# EAGLE schematic DATALOGGER_ADS_V1 (EAGLE 9.6.2)

## Sheet 1 of 21
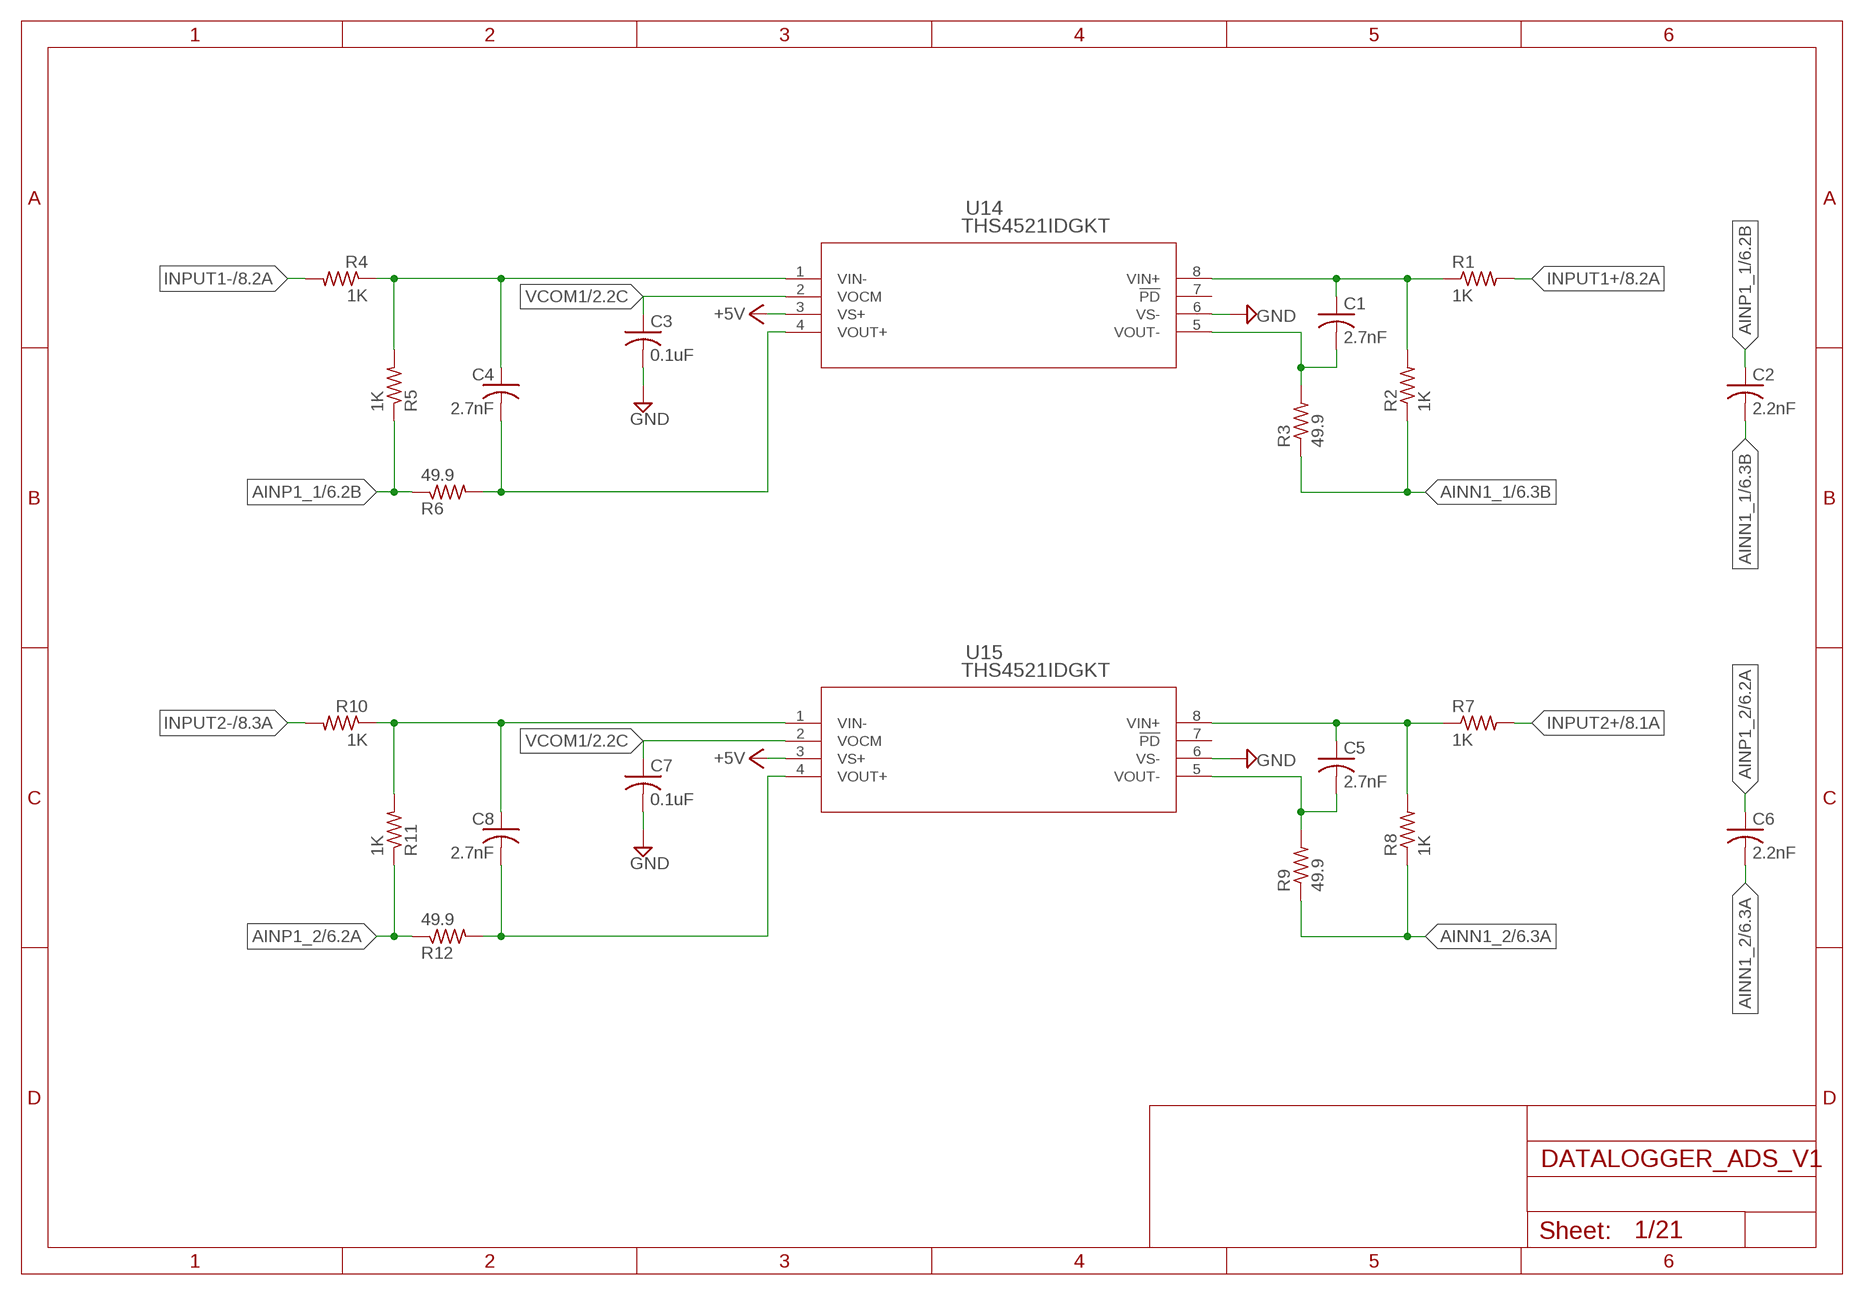
[diagram p0: schematic, sheet 1]

### Parts
C1  2.7nF  C-USC0603  [C0603]
C2  2.2nF  C-USC0603  [C0603]
C3  0.1uF  C-USC0603  [C0603]
C4  2.7nF  C-USC0603  [C0603]
C5  2.7nF  C-USC0603  [C0603]
C6  2.2nF  C-USC0603  [C0603]
C7  0.1uF  C-USC0603  [C0603]
C8  2.7nF  C-USC0603  [C0603]
R1  1K  R-US_R0603  [R0603]
R2  1K  R-US_R0603  [R0603]
R3  49.9  R-US_R0603  [R0603]
R4  1K  R-US_R0603  [R0603]
R5  1K  R-US_R0603  [R0603]
R6  49.9  R-US_R0603  [R0603]
R7  1K  R-US_R0603  [R0603]
R8  1K  R-US_R0603  [R0603]
R9  49.9  R-US_R0603  [R0603]
R10  1K  R-US_R0603  [R0603]
R11  1K  R-US_R0603  [R0603]
R12  49.9  R-US_R0603  [R0603]
U14  THS4521IDGKT  [DGK8]
U15  THS4521IDGKT  [DGK8]

### Nets
+5V: U14.3(VS+) U15.3(VS+) ; also sheet 2,3,4,5,6,8,9,10,11,12,13,14,15,16,17,18,19,21
AINN1_1: C2.2 R2.1 R3.1 ; also sheet 6
AINN1_2: C6.2 R8.1 R9.1 ; also sheet 6
AINP1_1: C2.1 R5.1 R6.1 ; also sheet 6
AINP1_2: C6.1 R11.1 R12.1 ; also sheet 6
GND: C3.2 C7.2 U14.6(VS-) U15.6(VS-) ; also sheet 2,3,4,5,6,7,8,9,10,11,12,13,14,15,16,17,18,19,20,21
INPUT1+: R1.2 ; also sheet 8
INPUT1-: R4.2 ; also sheet 8
INPUT2+: R7.2 ; also sheet 8
INPUT2-: R10.2 ; also sheet 8
N$1: C4.1 R4.1 R5.2 U14.1(VIN-)
N$2: C1.1 R1.1 R2.2 U14.8(VIN+)
N$3: C1.2 R3.2 U14.5(VOUT-)
N$4: C4.2 R6.2 U14.4(VOUT+)
N$5: C5.1 R7.1 R8.2 U15.8(VIN+)
N$6: C5.2 R9.2 U15.5(VOUT-)
N$7: C8.1 R10.1 R11.2 U15.1(VIN-)
N$8: C8.2 R12.2 U15.4(VOUT+)
VCOM1: C3.1 C7.1 U14.2(VOCM) U15.2(VOCM) ; also sheet 2,3,4,5
Unconnected: U14.7(!PD) U15.7(!PD)

## Sheet 2 of 21
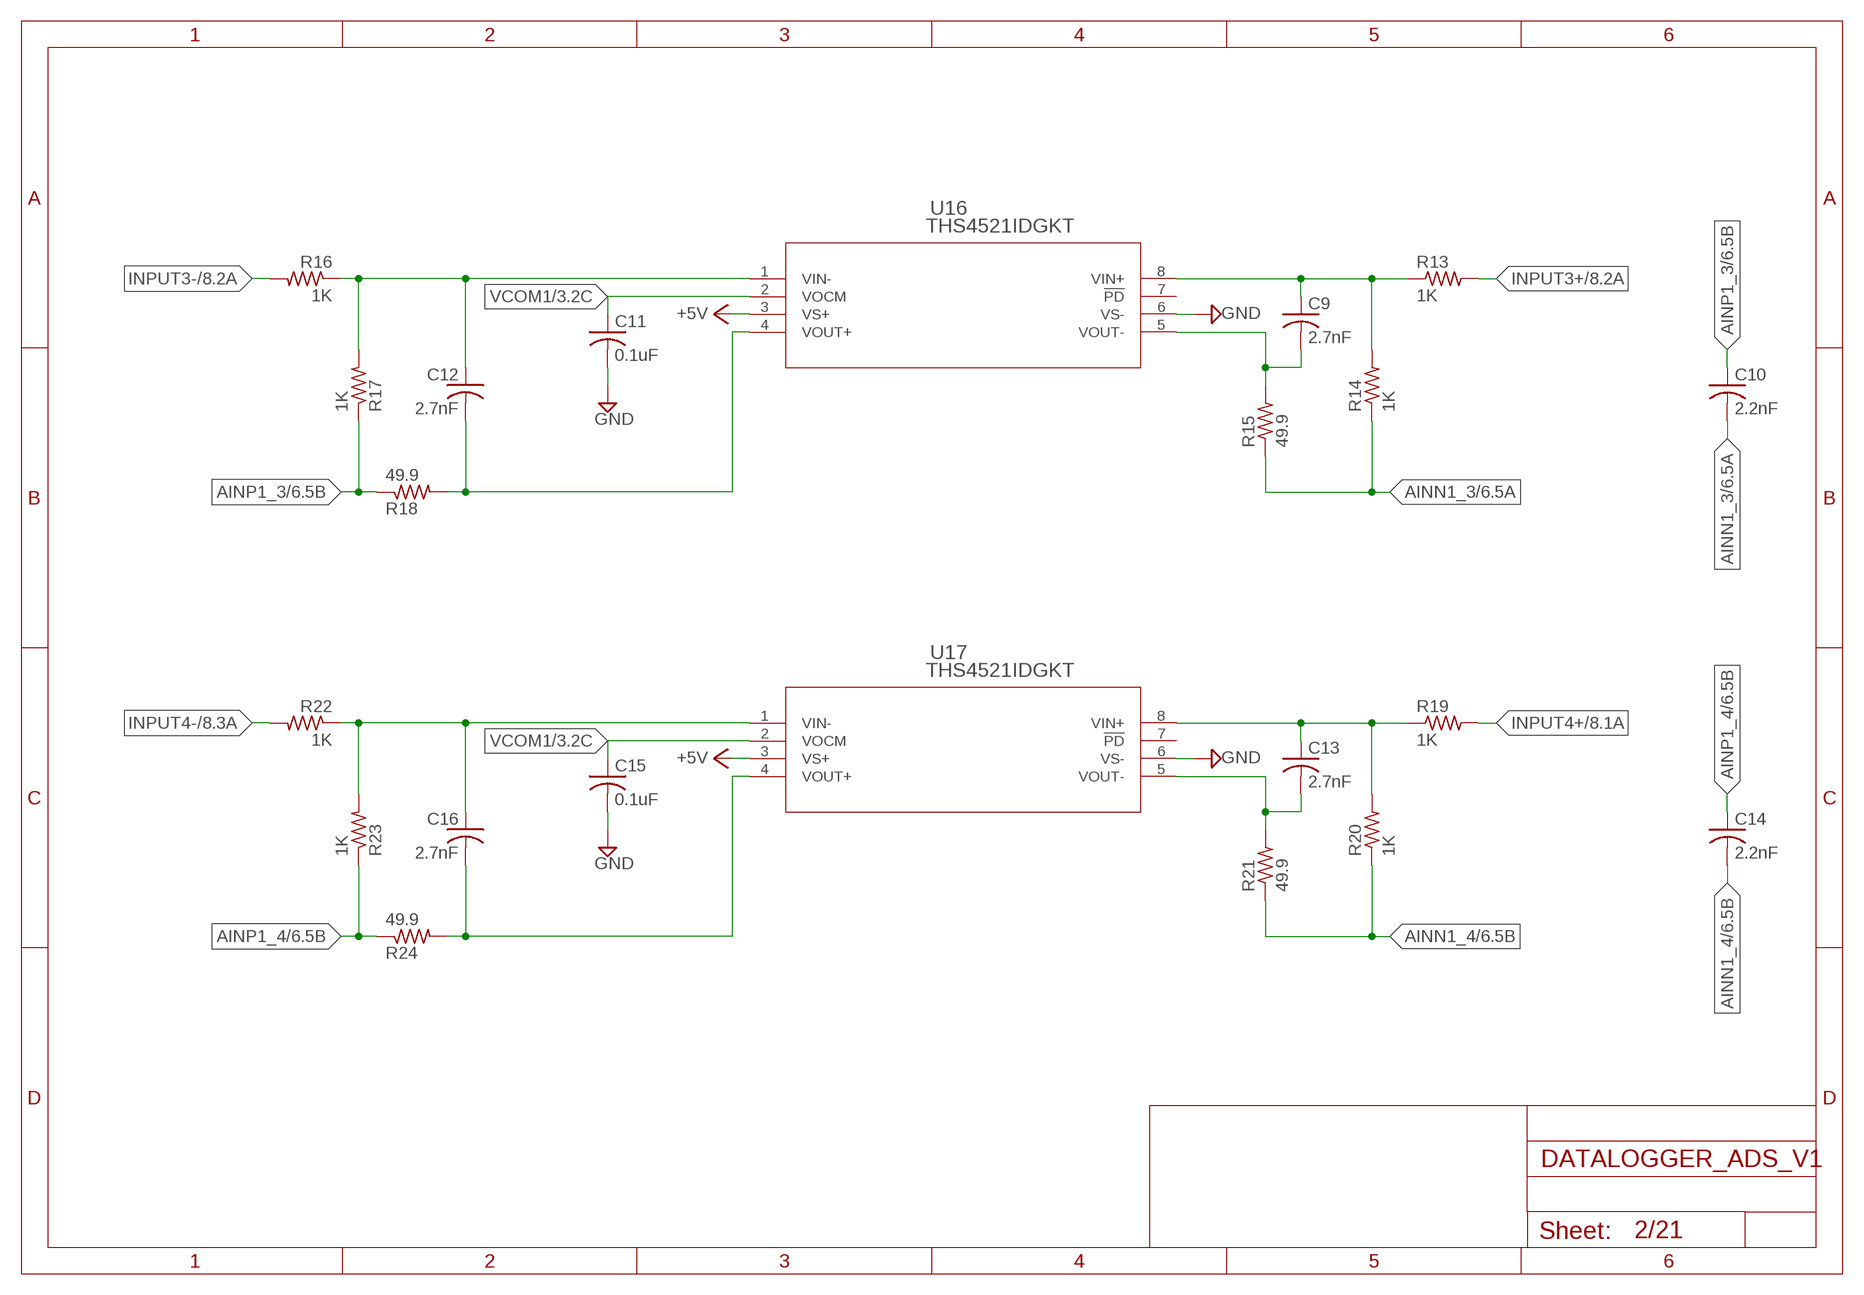
[diagram p1: schematic, sheet 2]

### Parts
C9  2.7nF  C-USC0603  [C0603]
C10  2.2nF  C-USC0603  [C0603]
C11  0.1uF  C-USC0603  [C0603]
C12  2.7nF  C-USC0603  [C0603]
C13  2.7nF  C-USC0603  [C0603]
C14  2.2nF  C-USC0603  [C0603]
C15  0.1uF  C-USC0603  [C0603]
C16  2.7nF  C-USC0603  [C0603]
R13  1K  R-US_R0603  [R0603]
R14  1K  R-US_R0603  [R0603]
R15  49.9  R-US_R0603  [R0603]
R16  1K  R-US_R0603  [R0603]
R17  1K  R-US_R0603  [R0603]
R18  49.9  R-US_R0603  [R0603]
R19  1K  R-US_R0603  [R0603]
R20  1K  R-US_R0603  [R0603]
R21  49.9  R-US_R0603  [R0603]
R22  1K  R-US_R0603  [R0603]
R23  1K  R-US_R0603  [R0603]
R24  49.9  R-US_R0603  [R0603]
U16  THS4521IDGKT  [DGK8]
U17  THS4521IDGKT  [DGK8]

### Nets
+5V: U16.3(VS+) U17.3(VS+) ; also sheet 1,3,4,5,6,8,9,10,11,12,13,14,15,16,17,18,19,21
AINN1_3: C10.2 R14.1 R15.1 ; also sheet 6
AINN1_4: C14.2 R20.1 R21.1 ; also sheet 6
AINP1_3: C10.1 R17.1 R18.1 ; also sheet 6
AINP1_4: C14.1 R23.1 R24.1 ; also sheet 6
GND: C11.2 C15.2 U16.6(VS-) U17.6(VS-) ; also sheet 1,3,4,5,6,7,8,9,10,11,12,13,14,15,16,17,18,19,20,21
INPUT3+: R13.2 ; also sheet 8
INPUT3-: R16.2 ; also sheet 8
INPUT4+: R19.2 ; also sheet 8
INPUT4-: R22.2 ; also sheet 8
N$9: C9.1 R13.1 R14.2 U16.8(VIN+)
N$10: C9.2 R15.2 U16.5(VOUT-)
N$11: C12.1 R16.1 R17.2 U16.1(VIN-)
N$12: C12.2 R18.2 U16.4(VOUT+)
N$13: C13.1 R19.1 R20.2 U17.8(VIN+)
N$14: C13.2 R21.2 U17.5(VOUT-)
N$15: C16.1 R22.1 R23.2 U17.1(VIN-)
N$16: C16.2 R24.2 U17.4(VOUT+)
VCOM1: C11.1 C15.1 U16.2(VOCM) U17.2(VOCM) ; also sheet 1,3,4,5
Unconnected: U16.7(!PD) U17.7(!PD)

## Sheet 3 of 21
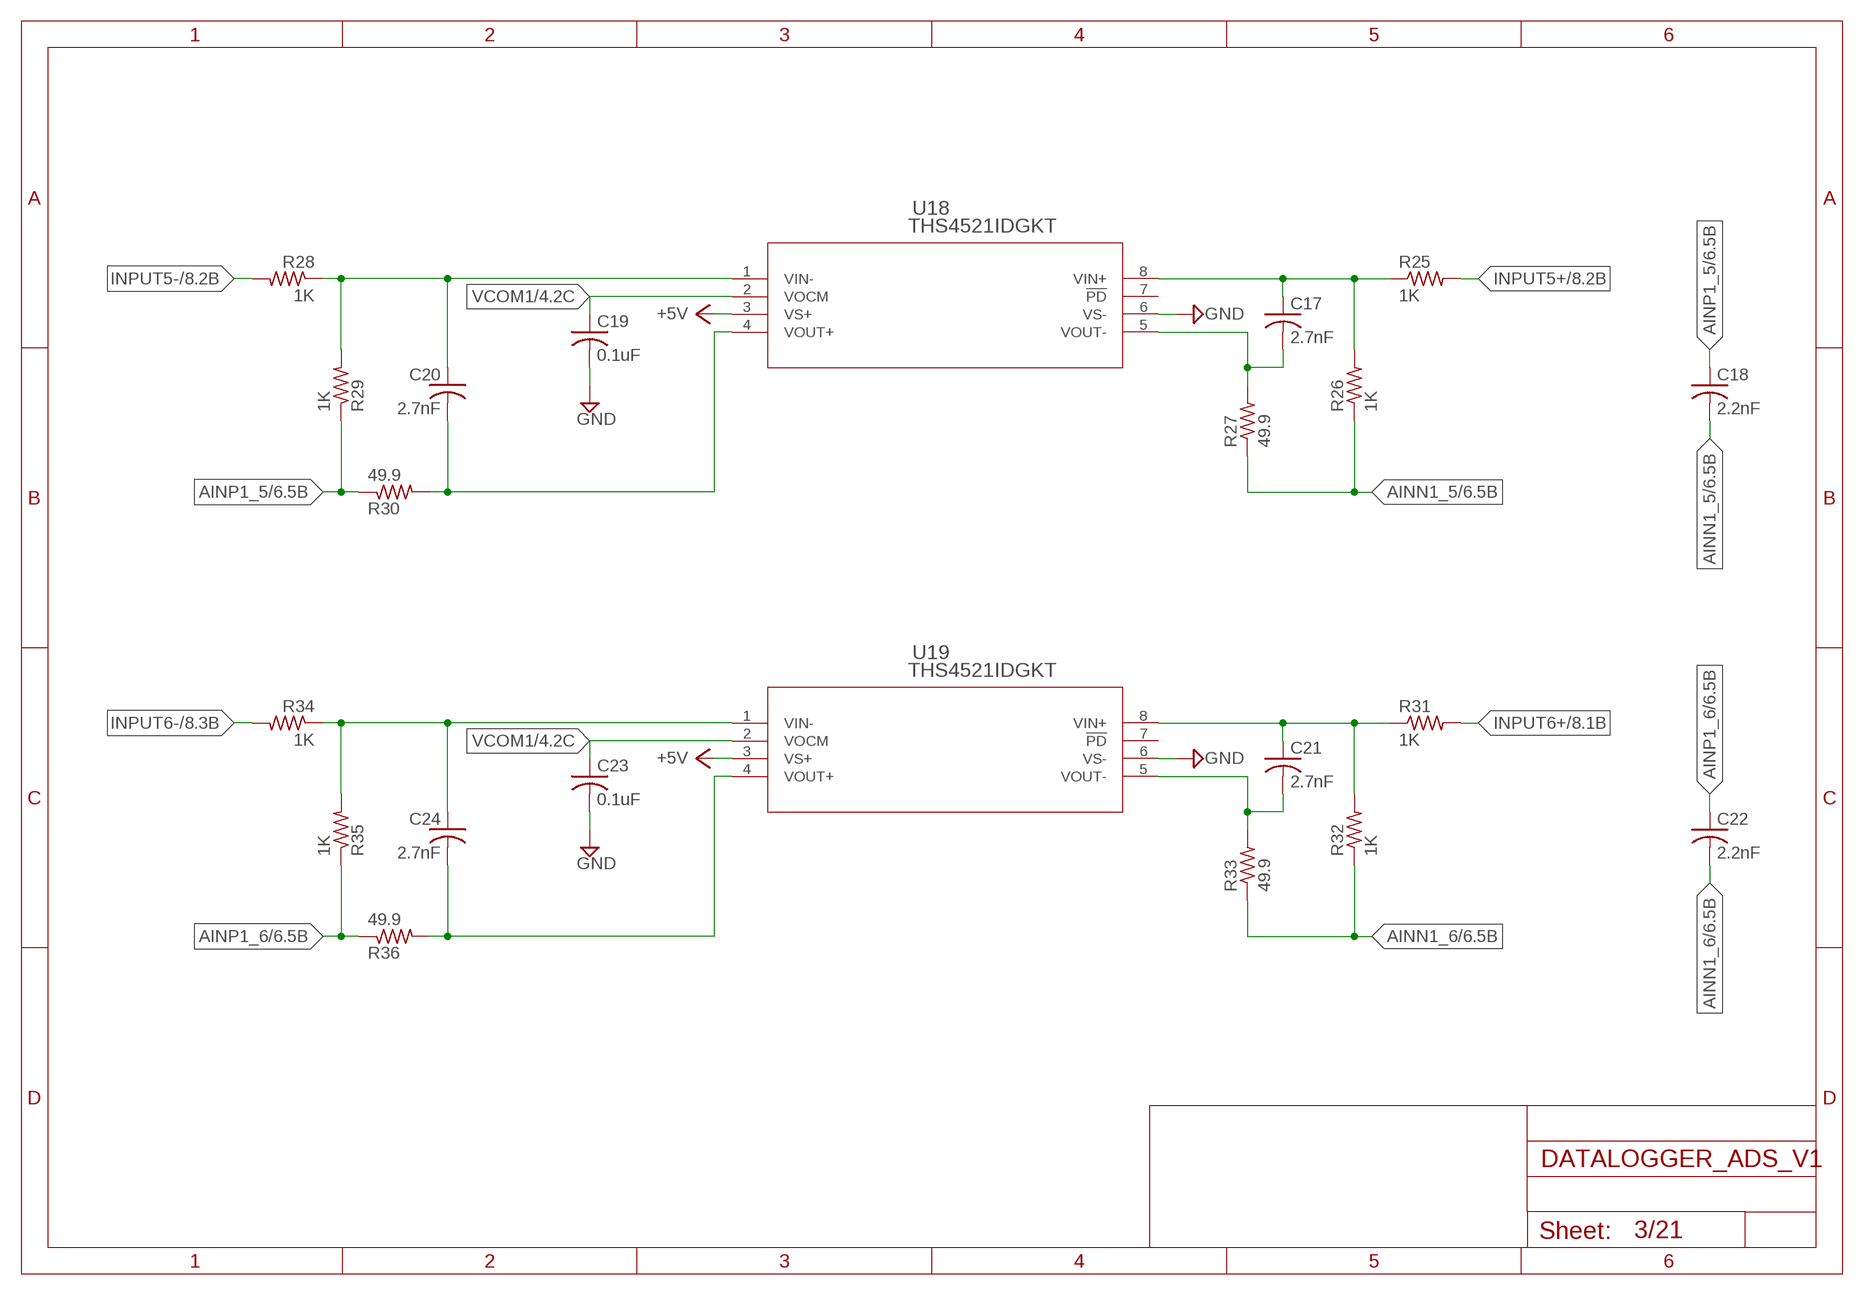
[diagram p2: schematic, sheet 3]

### Parts
C17  2.7nF  C-USC0603  [C0603]
C18  2.2nF  C-USC0603  [C0603]
C19  0.1uF  C-USC0603  [C0603]
C20  2.7nF  C-USC0603  [C0603]
C21  2.7nF  C-USC0603  [C0603]
C22  2.2nF  C-USC0603  [C0603]
C23  0.1uF  C-USC0603  [C0603]
C24  2.7nF  C-USC0603  [C0603]
R25  1K  R-US_R0603  [R0603]
R26  1K  R-US_R0603  [R0603]
R27  49.9  R-US_R0603  [R0603]
R28  1K  R-US_R0603  [R0603]
R29  1K  R-US_R0603  [R0603]
R30  49.9  R-US_R0603  [R0603]
R31  1K  R-US_R0603  [R0603]
R32  1K  R-US_R0603  [R0603]
R33  49.9  R-US_R0603  [R0603]
R34  1K  R-US_R0603  [R0603]
R35  1K  R-US_R0603  [R0603]
R36  49.9  R-US_R0603  [R0603]
U18  THS4521IDGKT  [DGK8]
U19  THS4521IDGKT  [DGK8]

### Nets
+5V: U18.3(VS+) U19.3(VS+) ; also sheet 1,2,4,5,6,8,9,10,11,12,13,14,15,16,17,18,19,21
AINN1_5: C18.2 R26.1 R27.1 ; also sheet 6
AINN1_6: C22.2 R32.1 R33.1 ; also sheet 6
AINP1_5: C18.1 R29.1 R30.1 ; also sheet 6
AINP1_6: C22.1 R35.1 R36.1 ; also sheet 6
GND: C19.2 C23.2 U18.6(VS-) U19.6(VS-) ; also sheet 1,2,4,5,6,7,8,9,10,11,12,13,14,15,16,17,18,19,20,21
INPUT5+: R25.2 ; also sheet 8
INPUT5-: R28.2 ; also sheet 8
INPUT6+: R31.2 ; also sheet 8
INPUT6-: R34.2 ; also sheet 8
N$17: C17.1 R25.1 R26.2 U18.8(VIN+)
N$18: C17.2 R27.2 U18.5(VOUT-)
N$19: C20.1 R28.1 R29.2 U18.1(VIN-)
N$20: C20.2 R30.2 U18.4(VOUT+)
N$21: C21.1 R31.1 R32.2 U19.8(VIN+)
N$22: C21.2 R33.2 U19.5(VOUT-)
N$23: C24.1 R34.1 R35.2 U19.1(VIN-)
N$24: C24.2 R36.2 U19.4(VOUT+)
VCOM1: C19.1 C23.1 U18.2(VOCM) U19.2(VOCM) ; also sheet 1,2,4,5
Unconnected: U18.7(!PD) U19.7(!PD)

## Sheet 4 of 21
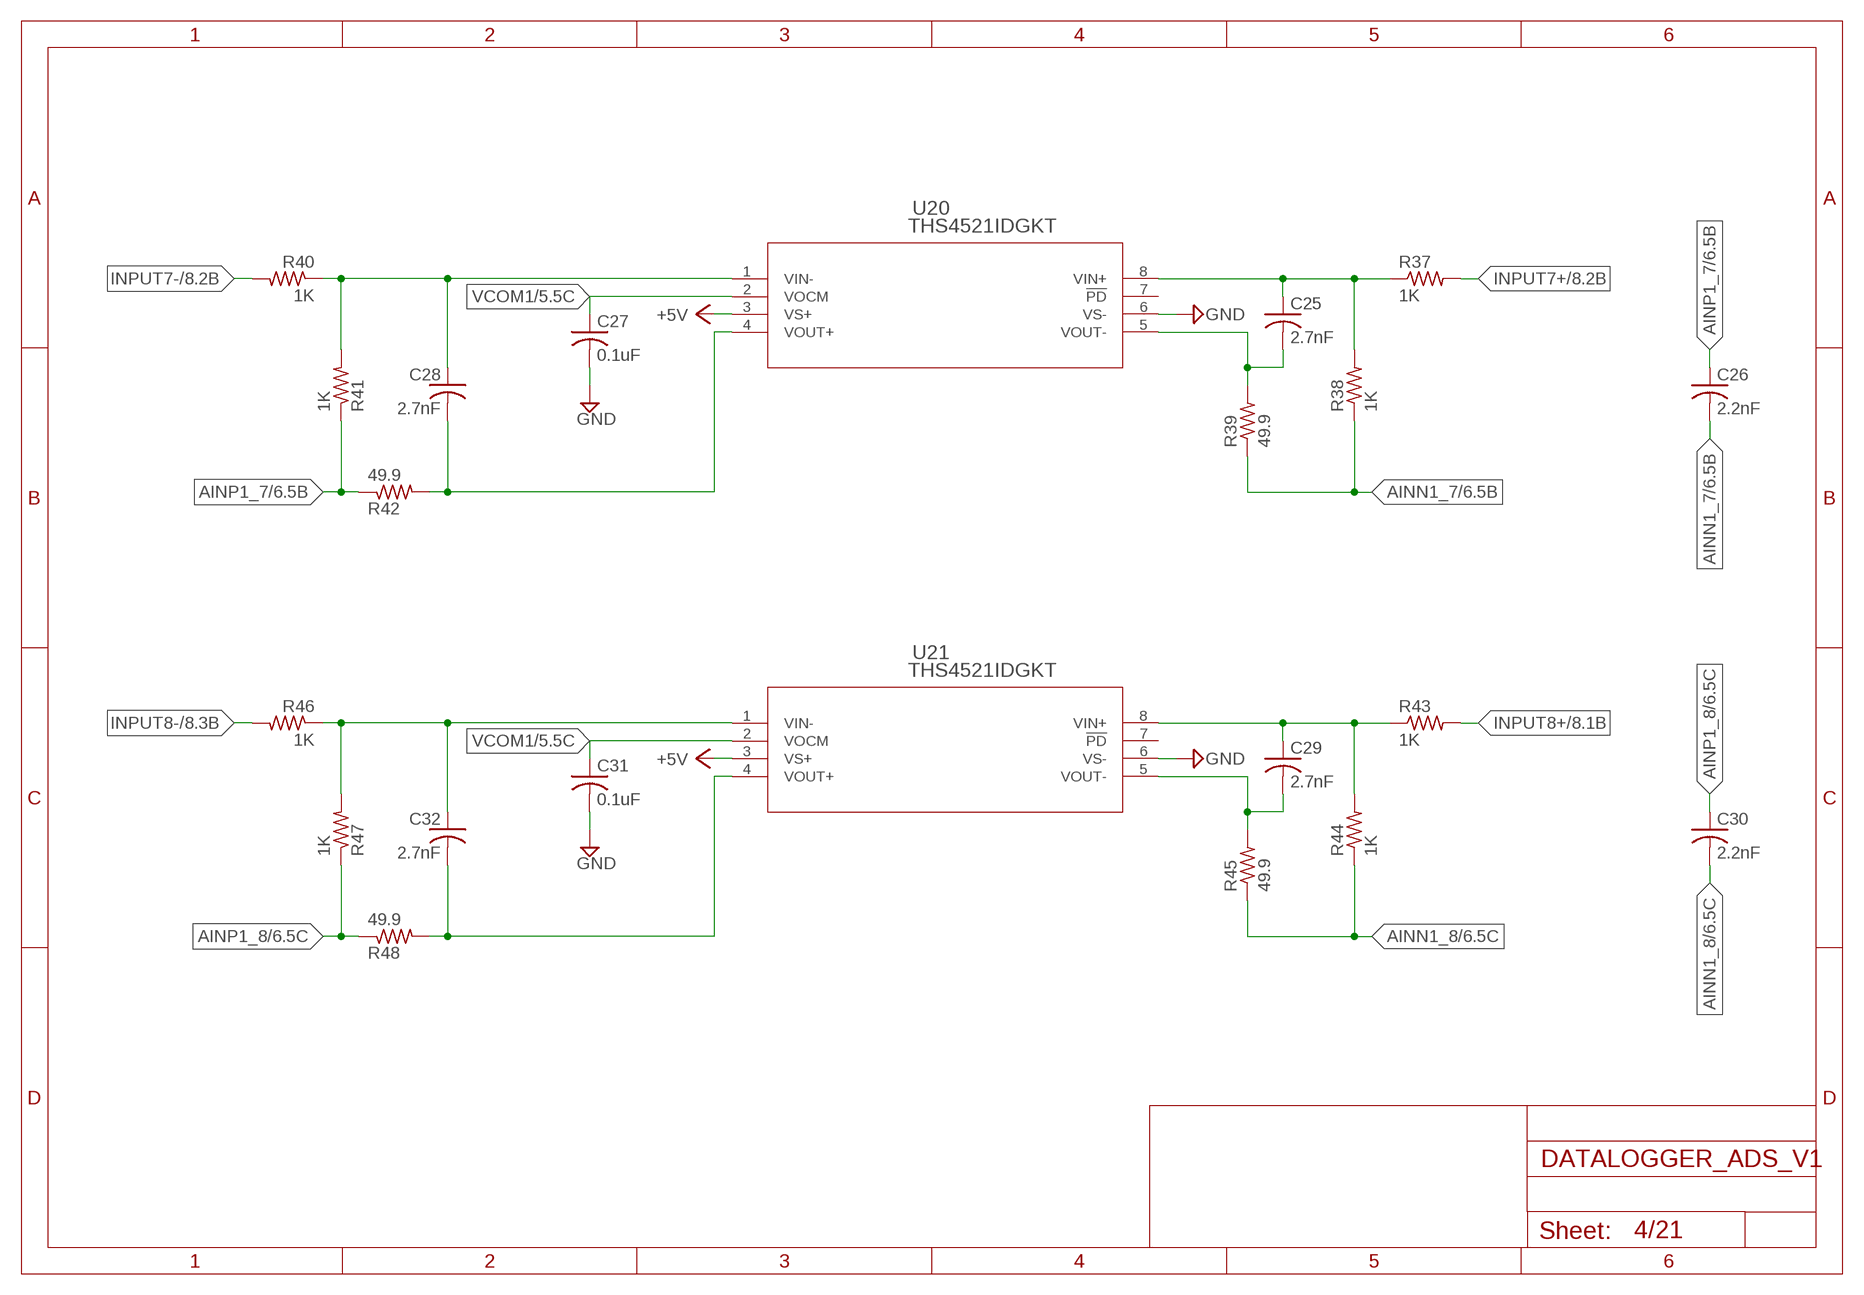
[diagram p3: schematic, sheet 4]

### Parts
C25  2.7nF  C-USC0603  [C0603]
C26  2.2nF  C-USC0603  [C0603]
C27  0.1uF  C-USC0603  [C0603]
C28  2.7nF  C-USC0603  [C0603]
C29  2.7nF  C-USC0603  [C0603]
C30  2.2nF  C-USC0603  [C0603]
C31  0.1uF  C-USC0603  [C0603]
C32  2.7nF  C-USC0603  [C0603]
R37  1K  R-US_R0603  [R0603]
R38  1K  R-US_R0603  [R0603]
R39  49.9  R-US_R0603  [R0603]
R40  1K  R-US_R0603  [R0603]
R41  1K  R-US_R0603  [R0603]
R42  49.9  R-US_R0603  [R0603]
R43  1K  R-US_R0603  [R0603]
R44  1K  R-US_R0603  [R0603]
R45  49.9  R-US_R0603  [R0603]
R46  1K  R-US_R0603  [R0603]
R47  1K  R-US_R0603  [R0603]
R48  49.9  R-US_R0603  [R0603]
U20  THS4521IDGKT  [DGK8]
U21  THS4521IDGKT  [DGK8]

### Nets
+5V: U20.3(VS+) U21.3(VS+) ; also sheet 1,2,3,5,6,8,9,10,11,12,13,14,15,16,17,18,19,21
AINN1_7: C26.2 R38.1 R39.1 ; also sheet 6
AINN1_8: C30.2 R44.1 R45.1 ; also sheet 6
AINP1_7: C26.1 R41.1 R42.1 ; also sheet 6
AINP1_8: C30.1 R47.1 R48.1 ; also sheet 6
GND: C27.2 C31.2 U20.6(VS-) U21.6(VS-) ; also sheet 1,2,3,5,6,7,8,9,10,11,12,13,14,15,16,17,18,19,20,21
INPUT7+: R37.2 ; also sheet 8
INPUT7-: R40.2 ; also sheet 8
INPUT8+: R43.2 ; also sheet 8
INPUT8-: R46.2 ; also sheet 8
N$25: C25.1 R37.1 R38.2 U20.8(VIN+)
N$26: C25.2 R39.2 U20.5(VOUT-)
N$27: C28.1 R40.1 R41.2 U20.1(VIN-)
N$28: C28.2 R42.2 U20.4(VOUT+)
N$29: C29.1 R43.1 R44.2 U21.8(VIN+)
N$30: C29.2 R45.2 U21.5(VOUT-)
N$31: C32.1 R46.1 R47.2 U21.1(VIN-)
N$32: C32.2 R48.2 U21.4(VOUT+)
VCOM1: C27.1 C31.1 U20.2(VOCM) U21.2(VOCM) ; also sheet 1,2,3,5
Unconnected: U20.7(!PD) U21.7(!PD)

## Sheet 5 of 21
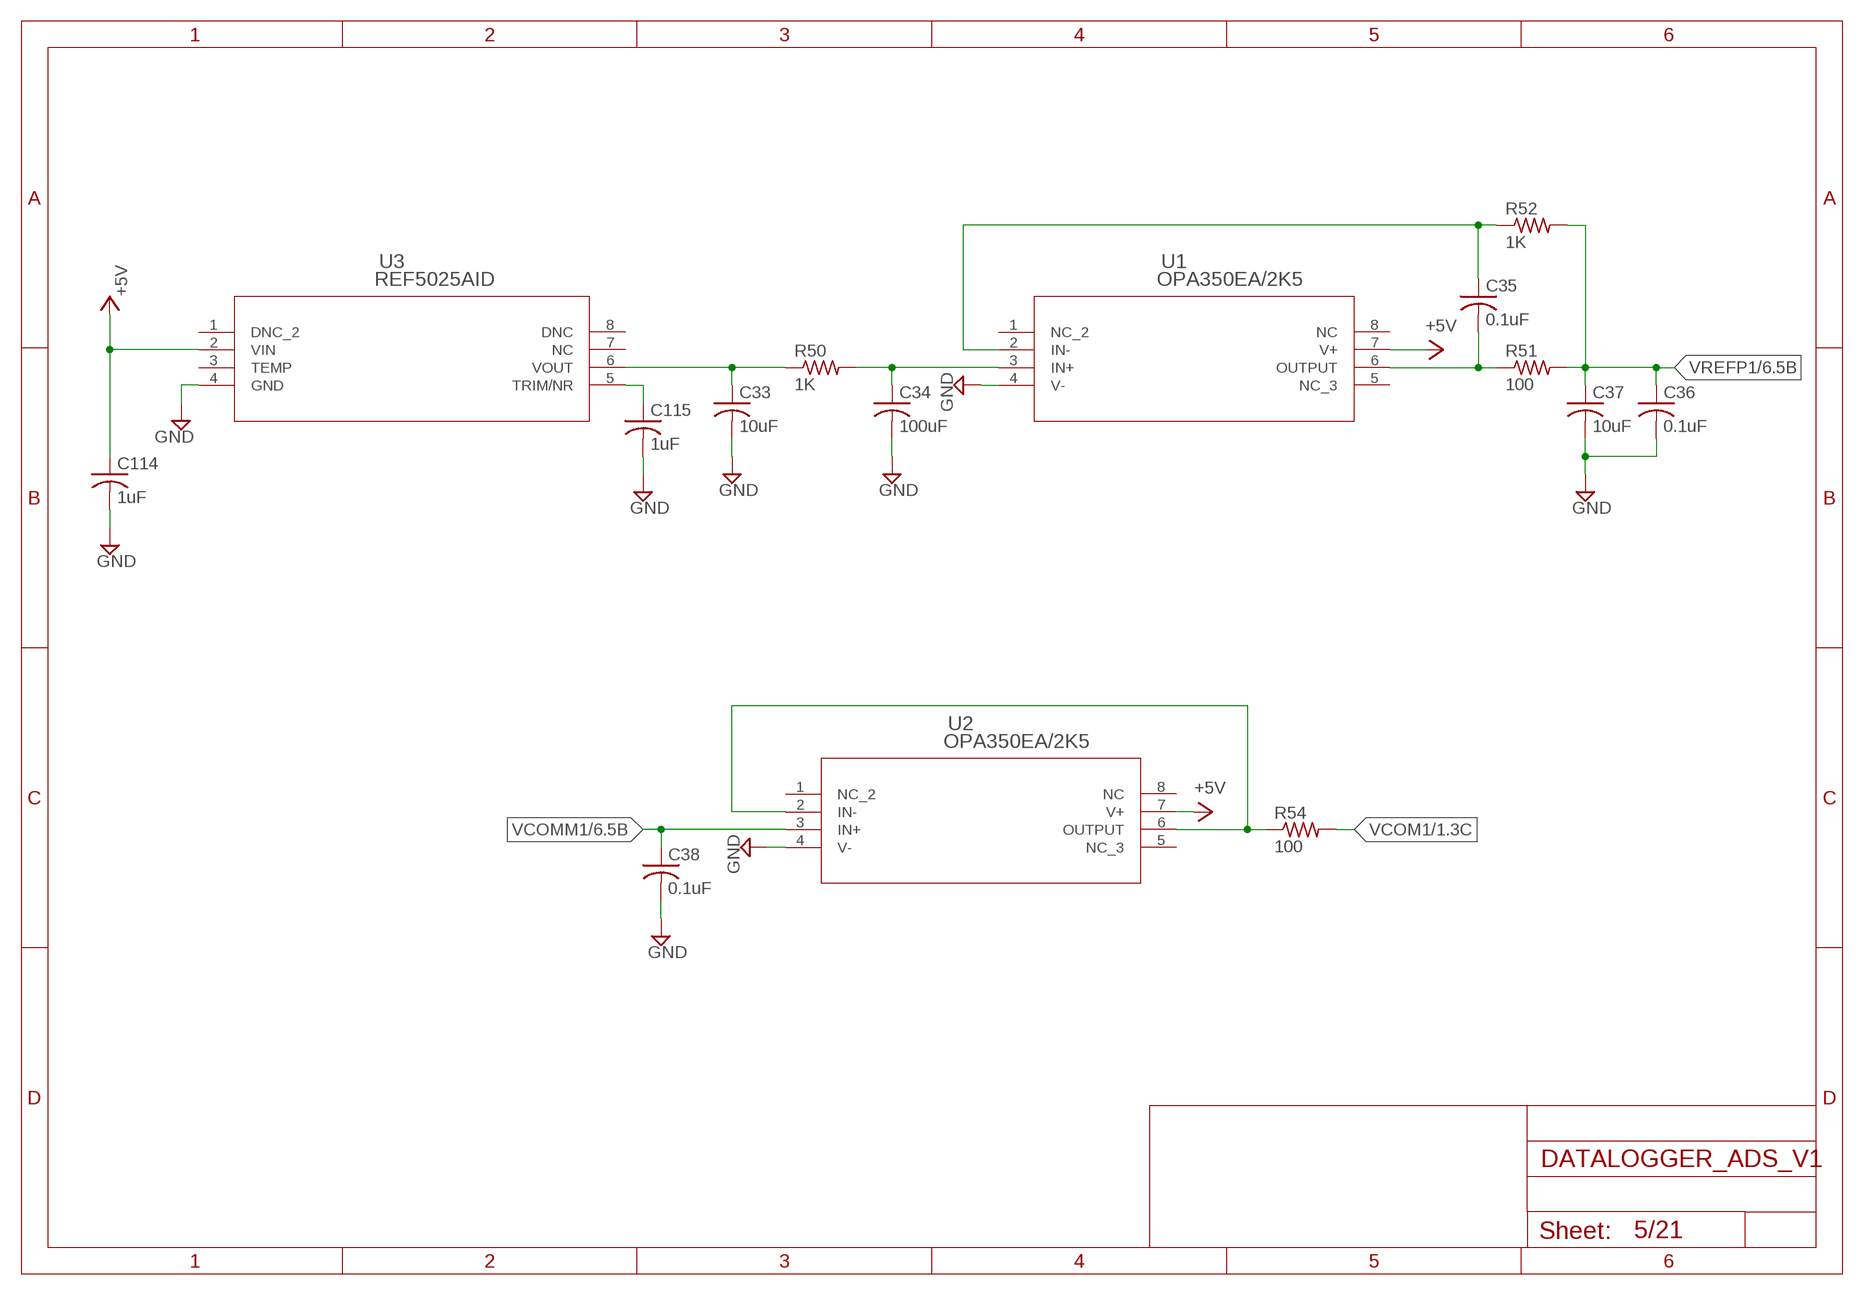
[diagram p4: schematic, sheet 5]

### Parts
C33  10uF  C-USC0603  [C0603]
C34  100uF  C-USC1206  [C1206]
C35  0.1uF  C-USC0603  [C0603]
C36  0.1uF  C-USC0603  [C0603]
C37  10uF  C-USC0603  [C0603]
C38  0.1uF  C-USC0603  [C0603]
C114  1uF  C-USC0603  [C0603]
C115  1uF  C-USC0603  [C0603]
R50  1K  R-US_R0603  [R0603]
R51  100  R-US_R0603  [R0603]
R52  1K  R-US_R0603  [R0603]
R54  100  R-US_R0603  [R0603]
U1  OPA350EA/2K5  [DGK8_TEX]
U2  OPA350EA/2K5  [DGK8_TEX]
U3  REF5025AID  [D8]

### Nets
+5V: C114.1 U1.7(V+) U2.7(V+) U3.2(VIN) ; also sheet 1,2,3,4,6,8,9,10,11,12,13,14,15,16,17,18,19,21
GND: C33.2 C34.2 C36.2 C37.2 C38.2 C114.2 C115.2 U1.4(V-) U2.4(V-) U3.4(GND) ; also sheet 1,2,3,4,6,7,8,9,10,11,12,13,14,15,16,17,18,19,20,21
N$33: C34.1 R50.2 U1.3(IN+)
N$35: C115.1 U3.5(TRIM/NR)
N$36: C33.1 R50.1 U3.6(VOUT)
N$37: C35.1 R52.1 U1.2(IN-)
N$38: C35.2 R51.1 U1.6(OUTPUT)
N$39: R54.1 U2.2(IN-) U2.6(OUTPUT)
VCOM1: R54.2 ; also sheet 1,2,3,4
VCOMM1: C38.1 U2.3(IN+) ; also sheet 6
VREFP1: C36.1 C37.1 R51.2 R52.2 ; also sheet 6
Unconnected: U1.1(NC_2) U1.5(NC_3) U1.8(NC) U2.1(NC_2) U2.5(NC_3) U2.8(NC) U3.1(DNC_2) U3.3(TEMP) U3.7(NC) U3.8(DNC)

## Sheet 6 of 21
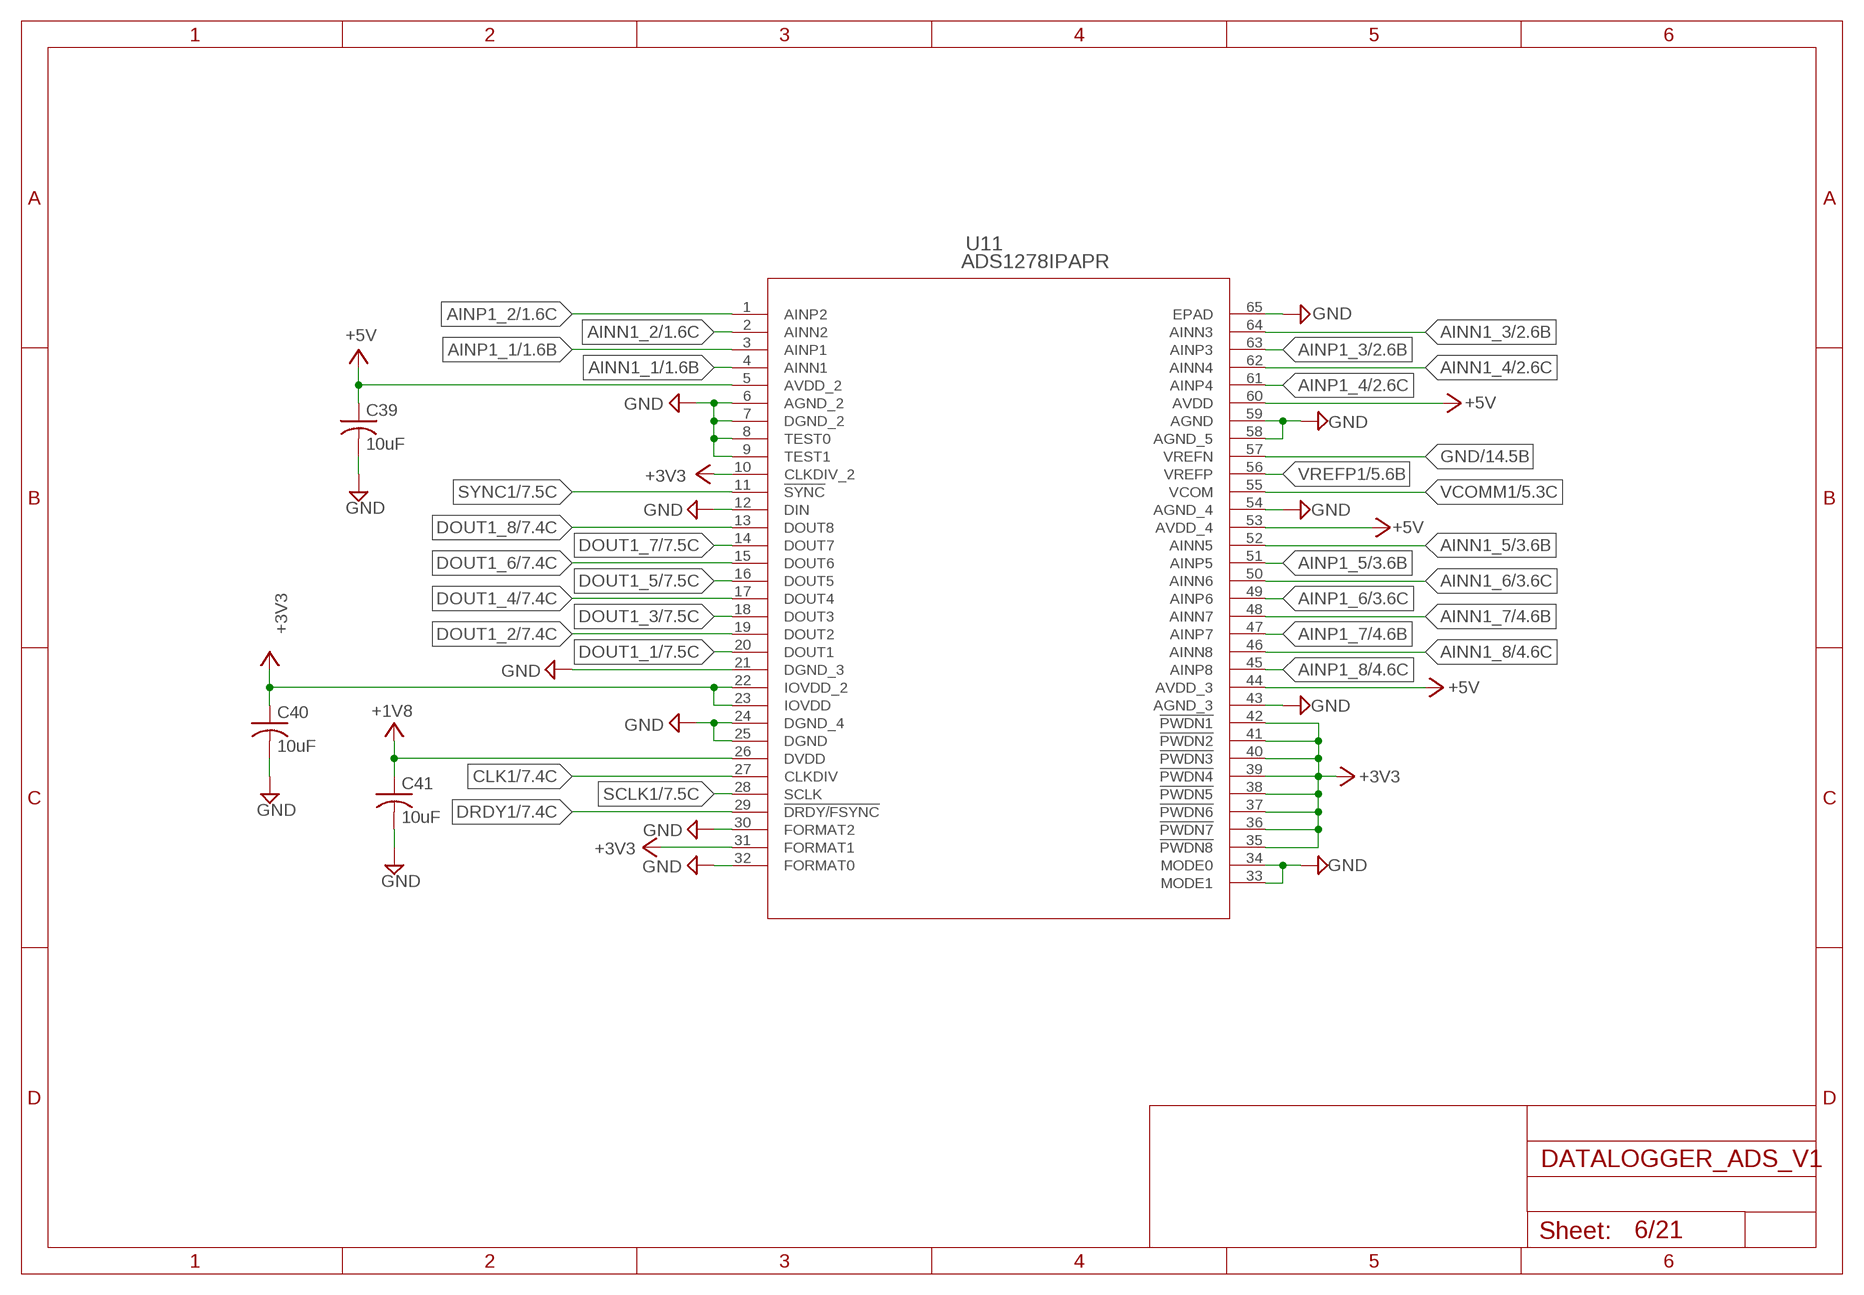
[diagram p5: schematic, sheet 6]

### Parts
C39  10uF  C-USC0603  [C0603]
C40  10uF  C-USC0603  [C0603]
C41  10uF  C-USC0603  [C0603]
U11  ADS1278IPAPR  [PAP64_7X7]

### Nets
+1V8: C41.1 U11.26(DVDD) ; also sheet 14,18,21
+3V3: C40.1 U11.10(CLKDIV_2) U11.22(IOVDD_2) U11.23(IOVDD) U11.31(FORMAT1) U11.35(!PWDN8) U11.36(!PWDN7) U11.37(!PWDN6) U11.38(!PWDN5) U11.39(!PWDN4) U11.40(!PWDN3) U11.41(!PWDN2) U11.42(!PWDN1) ; also sheet 14,18,19,20,21
+5V: C39.1 U11.5(AVDD_2) U11.44(AVDD_3) U11.53(AVDD_4) U11.60(AVDD) ; also sheet 1,2,3,4,5,8,9,10,11,12,13,14,15,16,17,18,19,21
AINN1_1: U11.4(AINN1) ; also sheet 1
AINN1_2: U11.2(AINN2) ; also sheet 1
AINN1_3: U11.64(AINN3) ; also sheet 2
AINN1_4: U11.62(AINN4) ; also sheet 2
AINN1_5: U11.52(AINN5) ; also sheet 3
AINN1_6: U11.50(AINN6) ; also sheet 3
AINN1_7: U11.48(AINN7) ; also sheet 4
AINN1_8: U11.46(AINN8) ; also sheet 4
AINP1_1: U11.3(AINP1) ; also sheet 1
AINP1_2: U11.1(AINP2) ; also sheet 1
AINP1_3: U11.63(AINP3) ; also sheet 2
AINP1_4: U11.61(AINP4) ; also sheet 2
AINP1_5: U11.51(AINP5) ; also sheet 3
AINP1_6: U11.49(AINP6) ; also sheet 3
AINP1_7: U11.47(AINP7) ; also sheet 4
AINP1_8: U11.45(AINP8) ; also sheet 4
CLK1: U11.27(CLKDIV) ; also sheet 7
DOUT1_1: U11.20(DOUT1) ; also sheet 7
DOUT1_2: U11.19(DOUT2) ; also sheet 7
DOUT1_3: U11.18(DOUT3) ; also sheet 7
DOUT1_4: U11.17(DOUT4) ; also sheet 7
DOUT1_5: U11.16(DOUT5) ; also sheet 7
DOUT1_6: U11.15(DOUT6) ; also sheet 7
DOUT1_7: U11.14(DOUT7) ; also sheet 7
DOUT1_8: U11.13(DOUT8) ; also sheet 7
DRDY1: U11.29(!DRDY/FSYNC) ; also sheet 7
GND: C39.2 C40.2 C41.2 U11.6(AGND_2) U11.7(DGND_2) U11.8(TEST0) U11.9(TEST1) U11.12(DIN) U11.21(DGND_3) U11.24(DGND_4) U11.25(DGND) U11.30(FORMAT2) U11.32(FORMAT0) U11.33(MODE1) U11.34(MODE0) U11.43(AGND_3) U11.54(AGND_4) U11.57(VREFN) U11.58(AGND_5) U11.59(AGND) U11.65(EPAD) ; also sheet 1,2,3,4,5,7,8,9,10,11,12,13,14,15,16,17,18,19,20,21
SCLK1: U11.28(SCLK) ; also sheet 7
SYNC1: U11.11(!SYNC) ; also sheet 7
VCOMM1: U11.55(VCOM) ; also sheet 5
VREFP1: U11.56(VREFP) ; also sheet 5

## Sheet 7 of 21
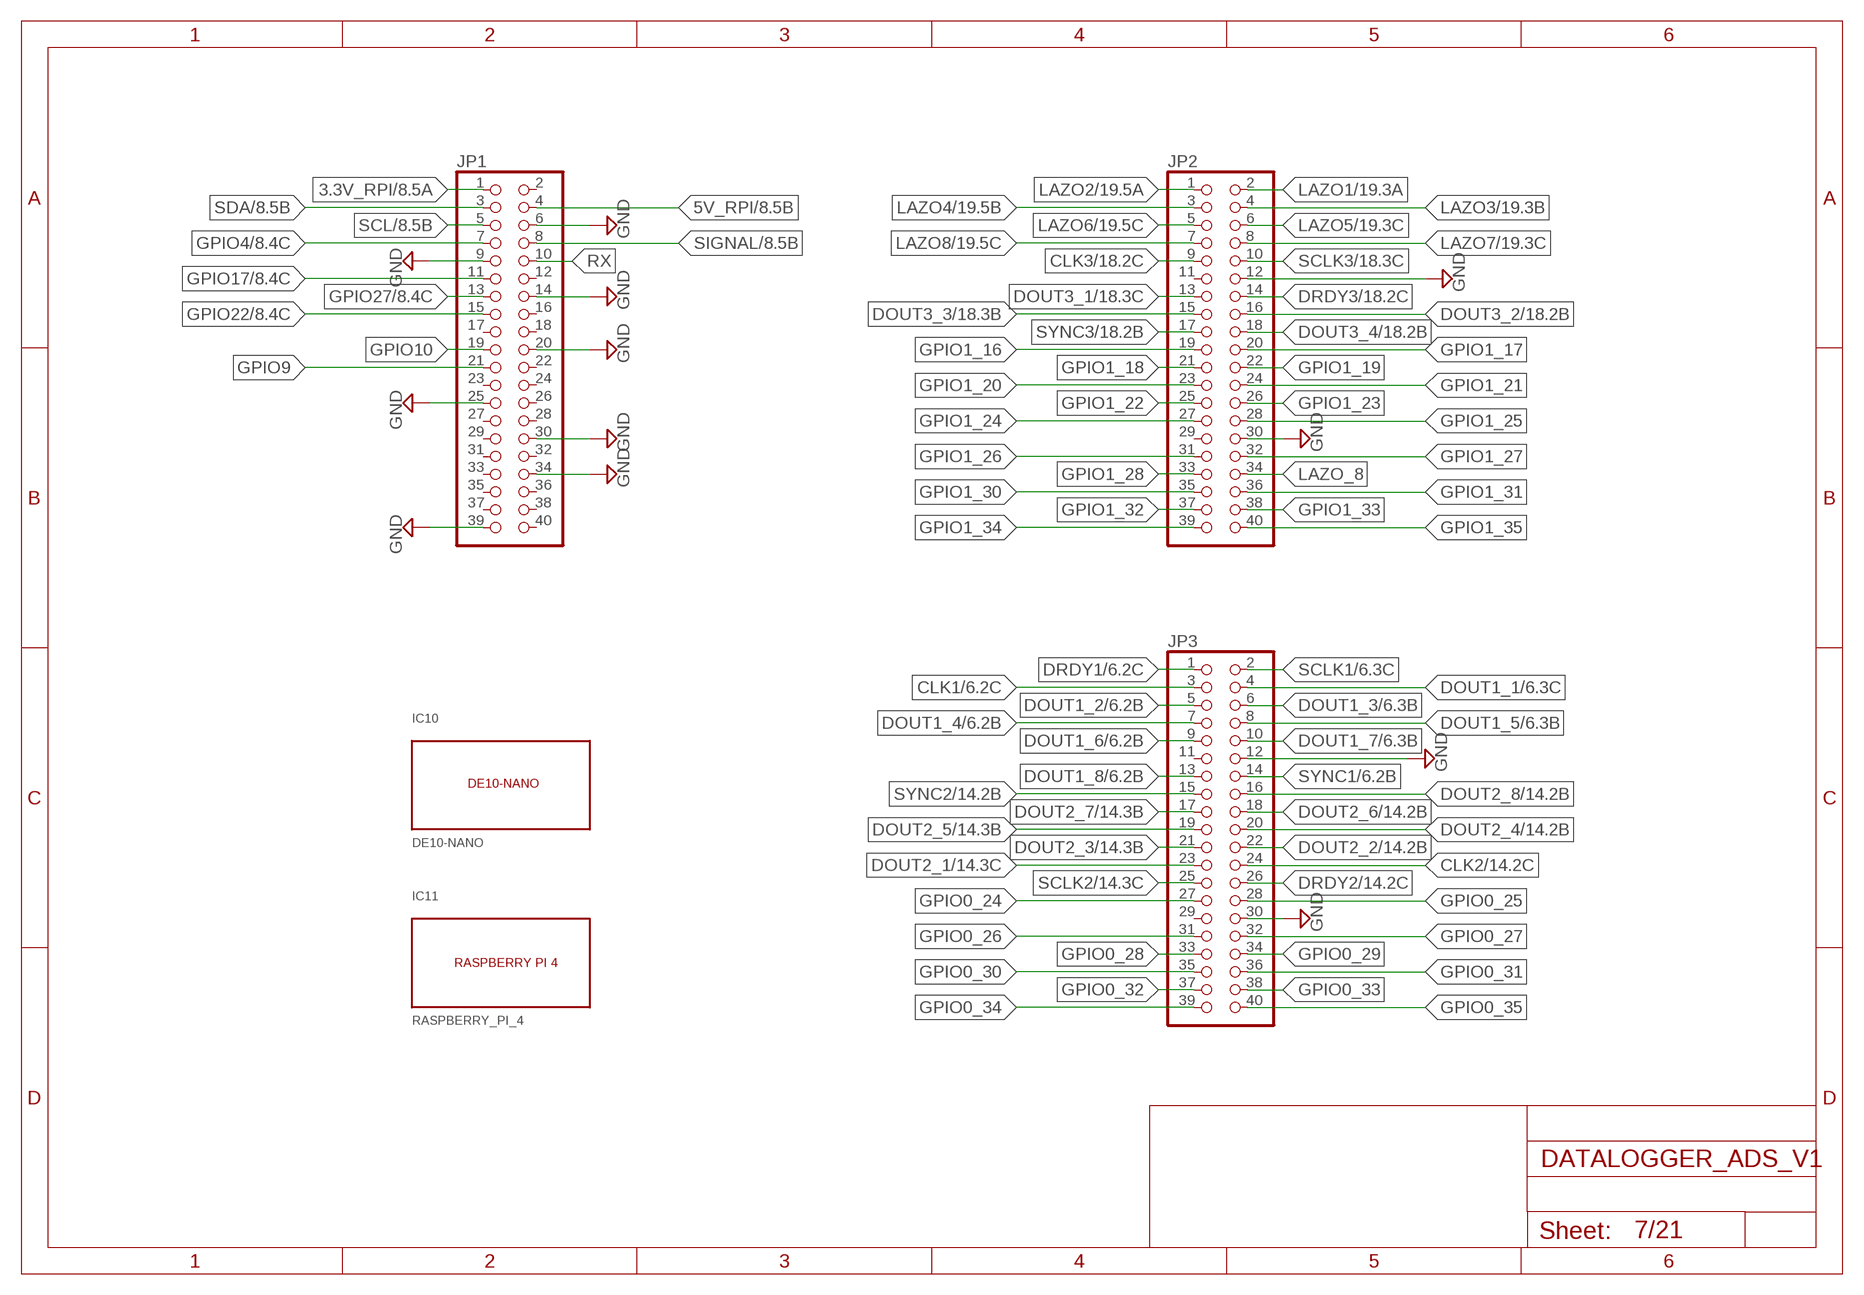
[diagram p6: schematic, sheet 7]

### Parts
IC10  DE10-NANO  [DE10_NANO]
IC11  RASPBERRY_PI_4  [RASPBERRY_PI_4]
JP1  PINHD-2X20  [2X20]
JP2  PINHD-2X20  [2X20]
JP3  PINHD-2X20  [2X20]

### Nets
3.3V_RPI: JP1.1 ; also sheet 8
5V_RPI: JP1.4 ; also sheet 8
CLK1: JP3.3 ; also sheet 6
CLK2: JP3.24 ; also sheet 14
CLK3: JP2.9 ; also sheet 18
DOUT1_1: JP3.4 ; also sheet 6
DOUT1_2: JP3.5 ; also sheet 6
DOUT1_3: JP3.6 ; also sheet 6
DOUT1_4: JP3.7 ; also sheet 6
DOUT1_5: JP3.8 ; also sheet 6
DOUT1_6: JP3.9 ; also sheet 6
DOUT1_7: JP3.10 ; also sheet 6
DOUT1_8: JP3.13 ; also sheet 6
DOUT2_1: JP3.23 ; also sheet 14
DOUT2_2: JP3.22 ; also sheet 14
DOUT2_3: JP3.21 ; also sheet 14
DOUT2_4: JP3.20 ; also sheet 14
DOUT2_5: JP3.19 ; also sheet 14
DOUT2_6: JP3.18 ; also sheet 14
DOUT2_7: JP3.17 ; also sheet 14
DOUT2_8: JP3.16 ; also sheet 14
DOUT3_1: JP2.13 ; also sheet 18
DOUT3_2: JP2.16 ; also sheet 18
DOUT3_3: JP2.15 ; also sheet 18
DOUT3_4: JP2.18 ; also sheet 18
DRDY1: JP3.1 ; also sheet 6
DRDY2: JP3.26 ; also sheet 14
DRDY3: JP2.14 ; also sheet 18
GND: JP1.6 JP1.9 JP1.14 JP1.20 JP1.25 JP1.30 JP1.34 JP1.39 JP2.12 JP2.30 JP3.12 JP3.30 ; also sheet 1,2,3,4,5,6,8,9,10,11,12,13,14,15,16,17,18,19,20,21
GPIO0_24: JP3.27
GPIO0_25: JP3.28
GPIO0_26: JP3.31
GPIO0_27: JP3.32
GPIO0_28: JP3.33
GPIO0_29: JP3.34
GPIO0_30: JP3.35
GPIO0_31: JP3.36
GPIO0_32: JP3.37
GPIO0_33: JP3.38
GPIO0_34: JP3.39
GPIO0_35: JP3.40
GPIO1_16: JP2.19
GPIO1_17: JP2.20
GPIO1_18: JP2.21
GPIO1_19: JP2.22
GPIO1_20: JP2.23
GPIO1_21: JP2.24
GPIO1_22: JP2.25
GPIO1_23: JP2.26
GPIO1_24: JP2.27
GPIO1_25: JP2.28
GPIO1_26: JP2.31
GPIO1_27: JP2.32
GPIO1_28: JP2.33
GPIO1_30: JP2.35
GPIO1_31: JP2.36
GPIO1_32: JP2.37
GPIO1_33: JP2.38
GPIO1_34: JP2.39
GPIO1_35: JP2.40
GPIO4: JP1.7 ; also sheet 8
GPIO9: JP1.21
GPIO10: JP1.19
GPIO17: JP1.11 ; also sheet 8
GPIO22: JP1.15 ; also sheet 8
GPIO27: JP1.13 ; also sheet 8
LAZO1: JP2.2 ; also sheet 19
LAZO2: JP2.1 ; also sheet 19
LAZO3: JP2.4 ; also sheet 19
LAZO4: JP2.3 ; also sheet 19
LAZO5: JP2.6 ; also sheet 19
LAZO6: JP2.5 ; also sheet 19
LAZO7: JP2.8 ; also sheet 19
LAZO8: JP2.7 ; also sheet 19
LAZO_8: JP2.34
RX: JP1.10
SCL: JP1.5 ; also sheet 8
SCLK1: JP3.2 ; also sheet 6
SCLK2: JP3.25 ; also sheet 14
SCLK3: JP2.10 ; also sheet 18
SDA: JP1.3 ; also sheet 8
SIGNAL: JP1.8 ; also sheet 8
SYNC1: JP3.14 ; also sheet 6
SYNC2: JP3.15 ; also sheet 14
SYNC3: JP2.17 ; also sheet 18
Unconnected: JP1.2 JP1.12 JP1.16 JP1.17 JP1.18 JP1.22 JP1.23 JP1.24 JP1.26 JP1.27 JP1.28 JP1.29 JP1.31 JP1.32 JP1.33 JP1.35 JP1.36 JP1.37 JP1.38 JP1.40 JP2.11 JP2.29 JP3.11 JP3.29

## Sheet 8 of 21
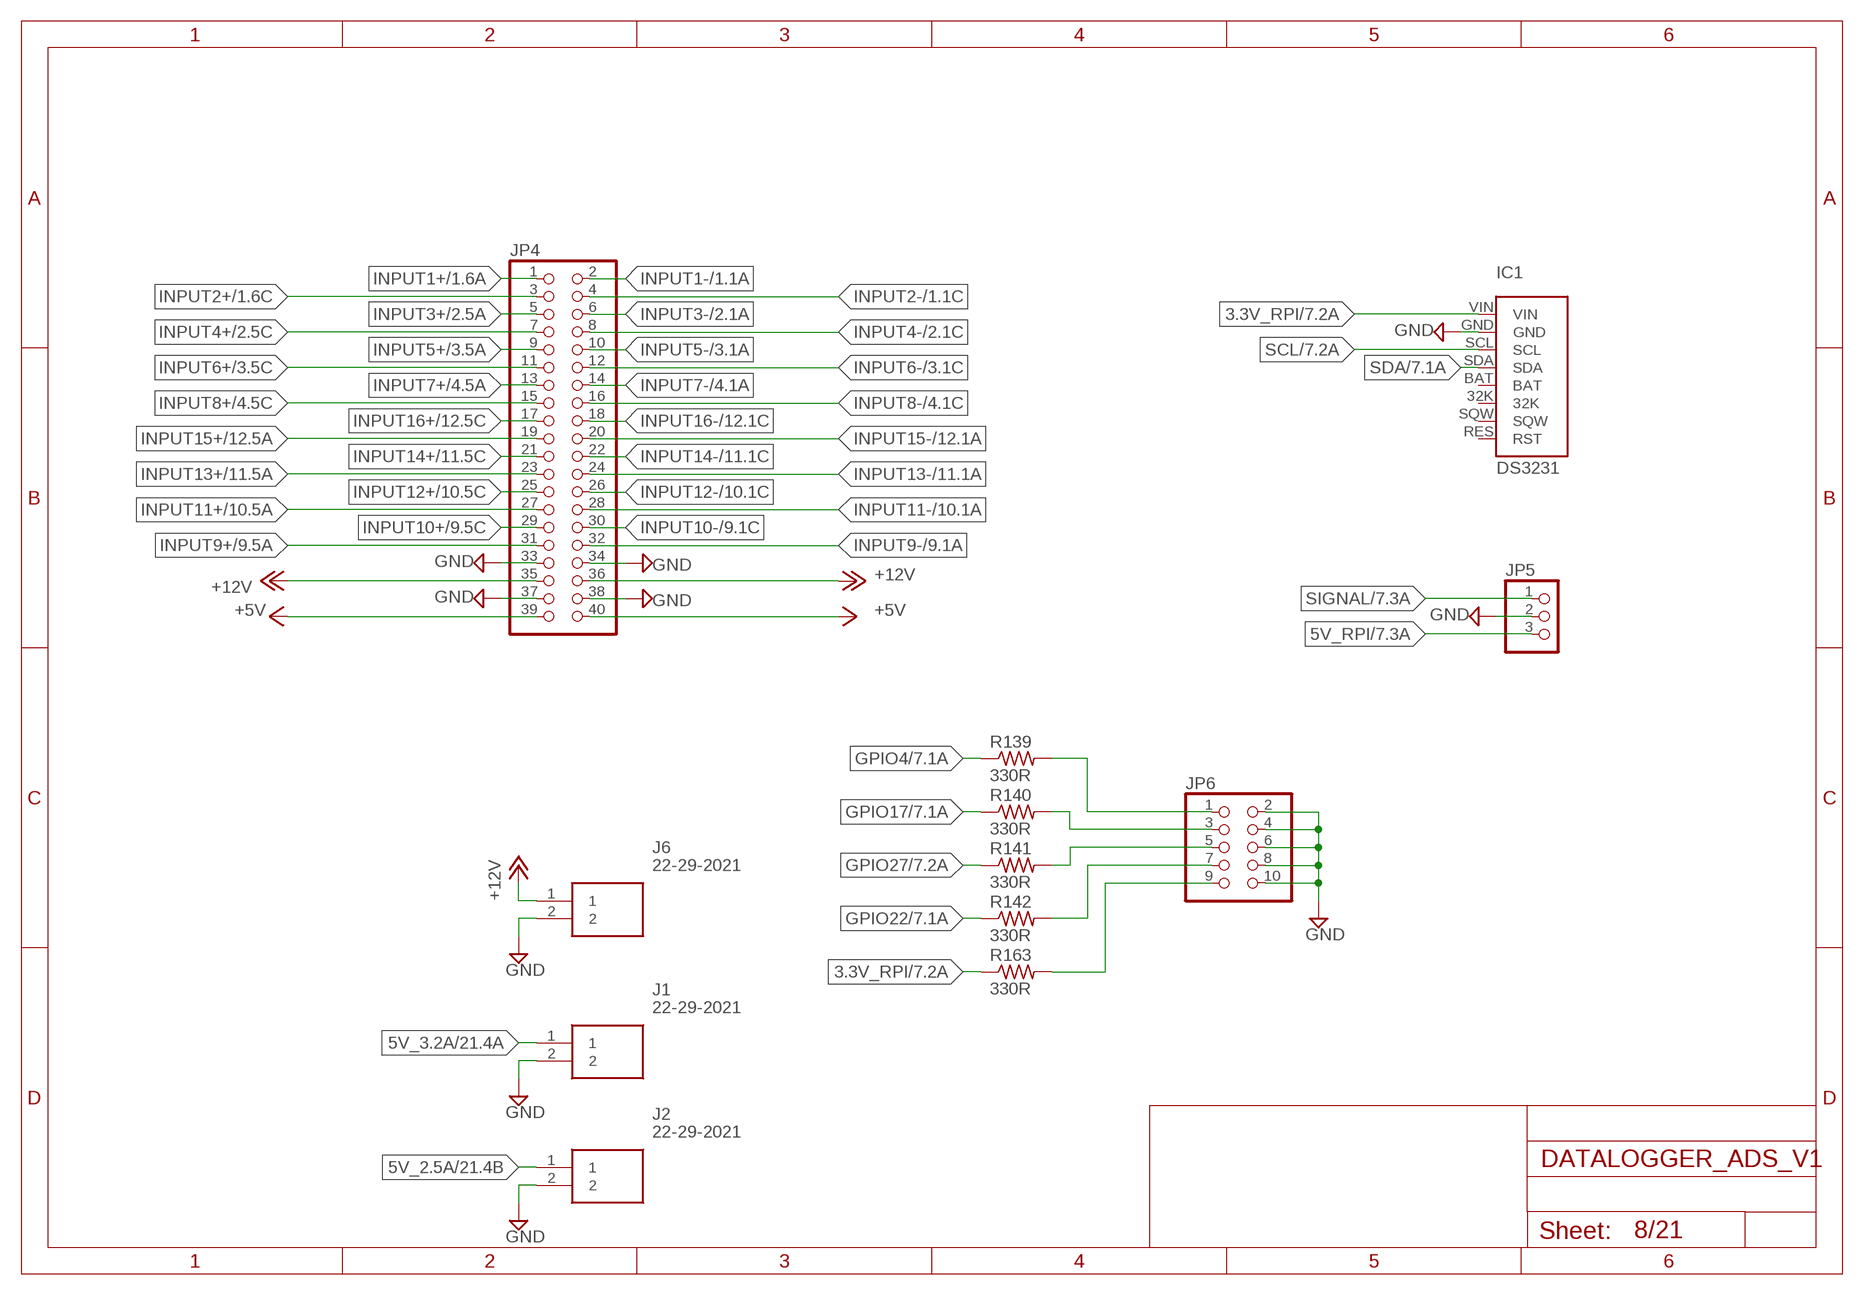
[diagram p7: schematic, sheet 8]

### Parts
IC1  DS3231  [DS3231]
J1  22-29-2021  [SHDR2W64P0X254_1X2_508X580X117]
J2  22-29-2021  [SHDR2W64P0X254_1X2_508X580X117]
J6  22-29-2021  [SHDR2W64P0X254_1X2_508X580X117]
JP4  PINHD-2X20  [2X20]
JP5  PINHD-1X3  [1X03]
JP6  PINHD-2X5  [2X05]
R139  330R  R-US_R0603  [R0603]
R140  330R  R-US_R0603  [R0603]
R141  330R  R-US_R0603  [R0603]
R142  330R  R-US_R0603  [R0603]
R163  330R  R-US_R0603  [R0603]

### Nets
3.3V_RPI: IC1.VIN R163.1 ; also sheet 7
5V_2.5A: J2.1 ; also sheet 21
5V_3.2A: J1.1 ; also sheet 21
5V_RPI: JP5.3 ; also sheet 7
+5V: JP4.39 JP4.40 ; also sheet 1,2,3,4,5,6,9,10,11,12,13,14,15,16,17,18,19,21
+12V: J6.1 JP4.35 JP4.36 ; also sheet 21
GND: IC1.GND J1.2 J2.2 J6.2 JP4.33 JP4.34 JP4.37 JP4.38 JP5.2 JP6.2 JP6.4 JP6.6 JP6.8 JP6.10 ; also sheet 1,2,3,4,5,6,7,9,10,11,12,13,14,15,16,17,18,19,20,21
GPIO4: R139.1 ; also sheet 7
GPIO17: R140.1 ; also sheet 7
GPIO22: R142.1 ; also sheet 7
GPIO27: R141.1 ; also sheet 7
INPUT1+: JP4.1 ; also sheet 1
INPUT1-: JP4.2 ; also sheet 1
INPUT2+: JP4.3 ; also sheet 1
INPUT2-: JP4.4 ; also sheet 1
INPUT3+: JP4.5 ; also sheet 2
INPUT3-: JP4.6 ; also sheet 2
INPUT4+: JP4.7 ; also sheet 2
INPUT4-: JP4.8 ; also sheet 2
INPUT5+: JP4.9 ; also sheet 3
INPUT5-: JP4.10 ; also sheet 3
INPUT6+: JP4.11 ; also sheet 3
INPUT6-: JP4.12 ; also sheet 3
INPUT7+: JP4.13 ; also sheet 4
INPUT7-: JP4.14 ; also sheet 4
INPUT8+: JP4.15 ; also sheet 4
INPUT8-: JP4.16 ; also sheet 4
INPUT9+: JP4.31 ; also sheet 9
INPUT9-: JP4.32 ; also sheet 9
INPUT10+: JP4.29 ; also sheet 9
INPUT10-: JP4.30 ; also sheet 9
INPUT11+: JP4.27 ; also sheet 10
INPUT11-: JP4.28 ; also sheet 10
INPUT12+: JP4.25 ; also sheet 10
INPUT12-: JP4.26 ; also sheet 10
INPUT13+: JP4.23 ; also sheet 11
INPUT13-: JP4.24 ; also sheet 11
INPUT14+: JP4.21 ; also sheet 11
INPUT14-: JP4.22 ; also sheet 11
INPUT15+: JP4.19 ; also sheet 12
INPUT15-: JP4.20 ; also sheet 12
INPUT16+: JP4.17 ; also sheet 12
INPUT16-: JP4.18 ; also sheet 12
N$105: JP6.9 R163.2
N$106: JP6.1 R139.2
N$107: JP6.3 R140.2
N$108: JP6.5 R141.2
N$109: JP6.7 R142.2
SCL: IC1.SCL ; also sheet 7
SDA: IC1.SDA ; also sheet 7
SIGNAL: JP5.1 ; also sheet 7
Unconnected: IC1.32K IC1.BAT IC1.RES(RST) IC1.SQW

## Sheet 9 of 21
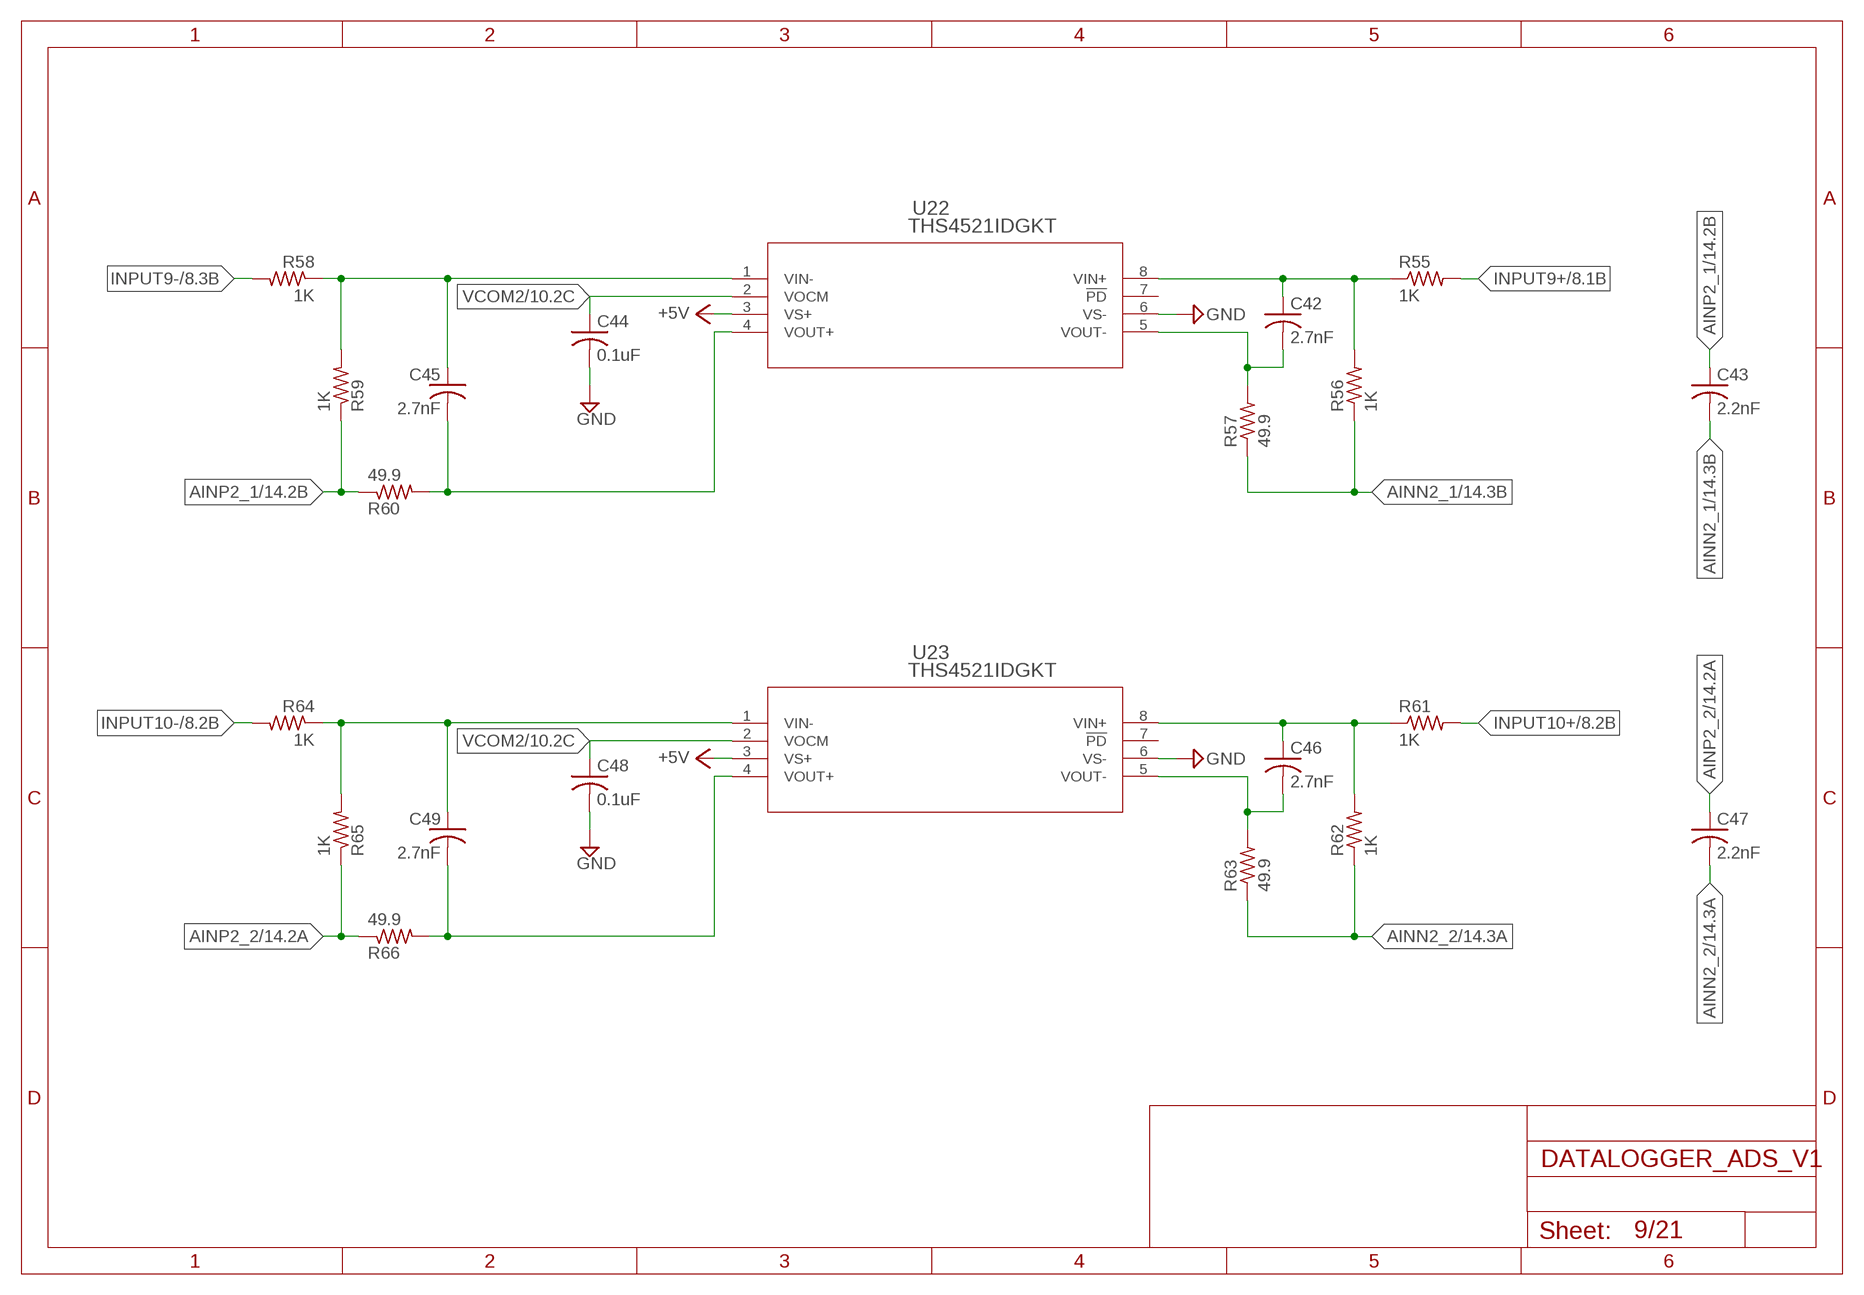
[diagram p8: schematic, sheet 9]

### Parts
C42  2.7nF  C-USC0603  [C0603]
C43  2.2nF  C-USC0603  [C0603]
C44  0.1uF  C-USC0603  [C0603]
C45  2.7nF  C-USC0603  [C0603]
C46  2.7nF  C-USC0603  [C0603]
C47  2.2nF  C-USC0603  [C0603]
C48  0.1uF  C-USC0603  [C0603]
C49  2.7nF  C-USC0603  [C0603]
R55  1K  R-US_R0603  [R0603]
R56  1K  R-US_R0603  [R0603]
R57  49.9  R-US_R0603  [R0603]
R58  1K  R-US_R0603  [R0603]
R59  1K  R-US_R0603  [R0603]
R60  49.9  R-US_R0603  [R0603]
R61  1K  R-US_R0603  [R0603]
R62  1K  R-US_R0603  [R0603]
R63  49.9  R-US_R0603  [R0603]
R64  1K  R-US_R0603  [R0603]
R65  1K  R-US_R0603  [R0603]
R66  49.9  R-US_R0603  [R0603]
U22  THS4521IDGKT  [DGK8]
U23  THS4521IDGKT  [DGK8]

### Nets
+5V: U22.3(VS+) U23.3(VS+) ; also sheet 1,2,3,4,5,6,8,10,11,12,13,14,15,16,17,18,19,21
AINN2_1: C43.2 R56.1 R57.1 ; also sheet 14
AINN2_2: C47.2 R62.1 R63.1 ; also sheet 14
AINP2_1: C43.1 R59.1 R60.1 ; also sheet 14
AINP2_2: C47.1 R65.1 R66.1 ; also sheet 14
GND: C44.2 C48.2 U22.6(VS-) U23.6(VS-) ; also sheet 1,2,3,4,5,6,7,8,10,11,12,13,14,15,16,17,18,19,20,21
INPUT9+: R55.2 ; also sheet 8
INPUT9-: R58.2 ; also sheet 8
INPUT10+: R61.2 ; also sheet 8
INPUT10-: R64.2 ; also sheet 8
N$40: C42.1 R55.1 R56.2 U22.8(VIN+)
N$41: C42.2 R57.2 U22.5(VOUT-)
N$42: C45.1 R58.1 R59.2 U22.1(VIN-)
N$43: C45.2 R60.2 U22.4(VOUT+)
N$44: C46.1 R61.1 R62.2 U23.8(VIN+)
N$45: C46.2 R63.2 U23.5(VOUT-)
N$46: C49.1 R64.1 R65.2 U23.1(VIN-)
N$47: C49.2 R66.2 U23.4(VOUT+)
VCOM2: C44.1 C48.1 U22.2(VOCM) U23.2(VOCM) ; also sheet 10,11,12,13
Unconnected: U22.7(!PD) U23.7(!PD)

## Sheet 10 of 21
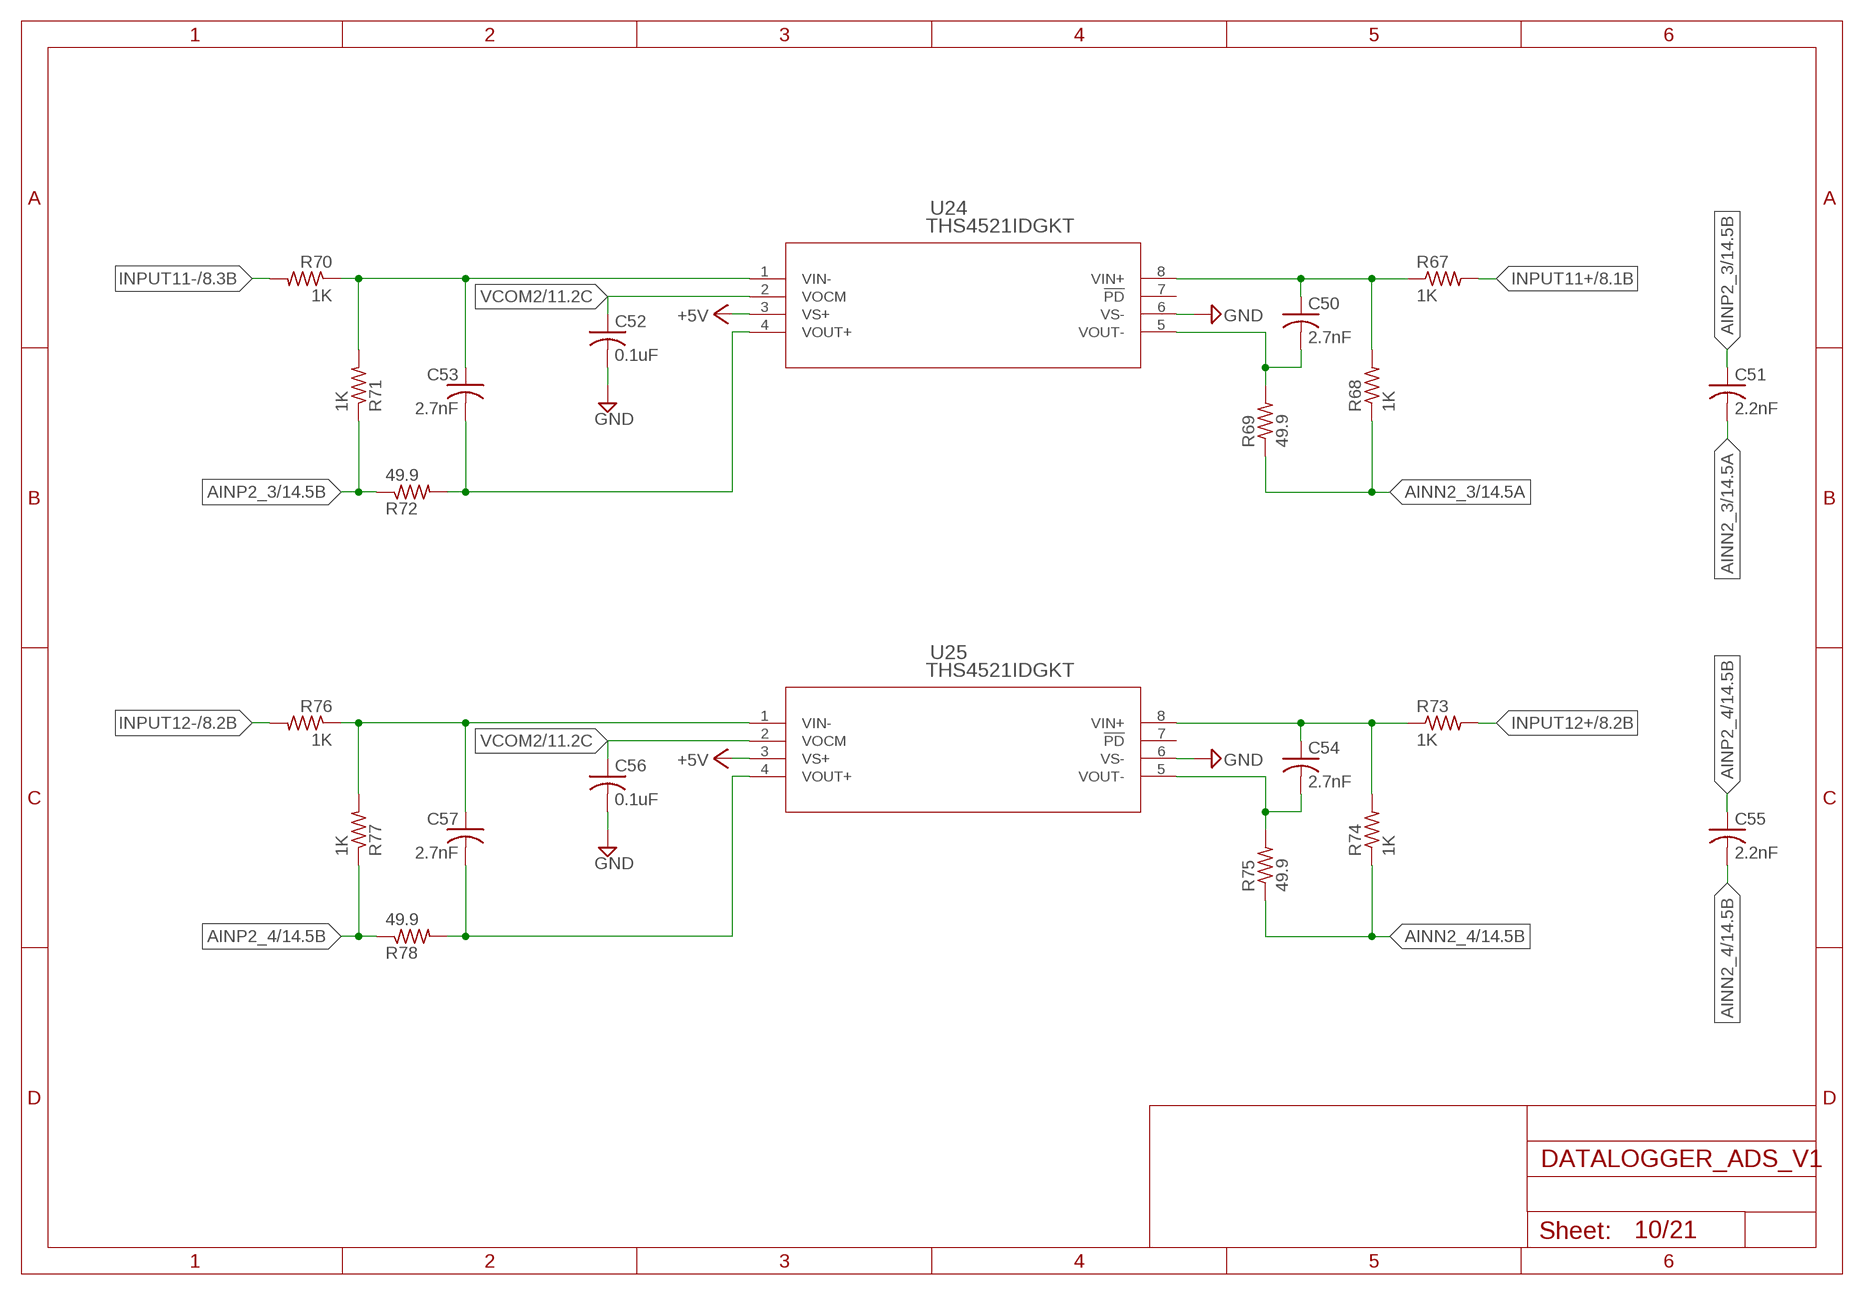
[diagram p9: schematic, sheet 10]

### Parts
C50  2.7nF  C-USC0603  [C0603]
C51  2.2nF  C-USC0603  [C0603]
C52  0.1uF  C-USC0603  [C0603]
C53  2.7nF  C-USC0603  [C0603]
C54  2.7nF  C-USC0603  [C0603]
C55  2.2nF  C-USC0603  [C0603]
C56  0.1uF  C-USC0603  [C0603]
C57  2.7nF  C-USC0603  [C0603]
R67  1K  R-US_R0603  [R0603]
R68  1K  R-US_R0603  [R0603]
R69  49.9  R-US_R0603  [R0603]
R70  1K  R-US_R0603  [R0603]
R71  1K  R-US_R0603  [R0603]
R72  49.9  R-US_R0603  [R0603]
R73  1K  R-US_R0603  [R0603]
R74  1K  R-US_R0603  [R0603]
R75  49.9  R-US_R0603  [R0603]
R76  1K  R-US_R0603  [R0603]
R77  1K  R-US_R0603  [R0603]
R78  49.9  R-US_R0603  [R0603]
U24  THS4521IDGKT  [DGK8]
U25  THS4521IDGKT  [DGK8]

### Nets
+5V: U24.3(VS+) U25.3(VS+) ; also sheet 1,2,3,4,5,6,8,9,11,12,13,14,15,16,17,18,19,21
AINN2_3: C51.2 R68.1 R69.1 ; also sheet 14
AINN2_4: C55.2 R74.1 R75.1 ; also sheet 14
AINP2_3: C51.1 R71.1 R72.1 ; also sheet 14
AINP2_4: C55.1 R77.1 R78.1 ; also sheet 14
GND: C52.2 C56.2 U24.6(VS-) U25.6(VS-) ; also sheet 1,2,3,4,5,6,7,8,9,11,12,13,14,15,16,17,18,19,20,21
INPUT11+: R67.2 ; also sheet 8
INPUT11-: R70.2 ; also sheet 8
INPUT12+: R73.2 ; also sheet 8
INPUT12-: R76.2 ; also sheet 8
N$48: C50.1 R67.1 R68.2 U24.8(VIN+)
N$49: C50.2 R69.2 U24.5(VOUT-)
N$50: C53.1 R70.1 R71.2 U24.1(VIN-)
N$51: C53.2 R72.2 U24.4(VOUT+)
N$52: C54.1 R73.1 R74.2 U25.8(VIN+)
N$53: C54.2 R75.2 U25.5(VOUT-)
N$54: C57.1 R76.1 R77.2 U25.1(VIN-)
N$55: C57.2 R78.2 U25.4(VOUT+)
VCOM2: C52.1 C56.1 U24.2(VOCM) U25.2(VOCM) ; also sheet 9,11,12,13
Unconnected: U24.7(!PD) U25.7(!PD)

## Sheet 11 of 21
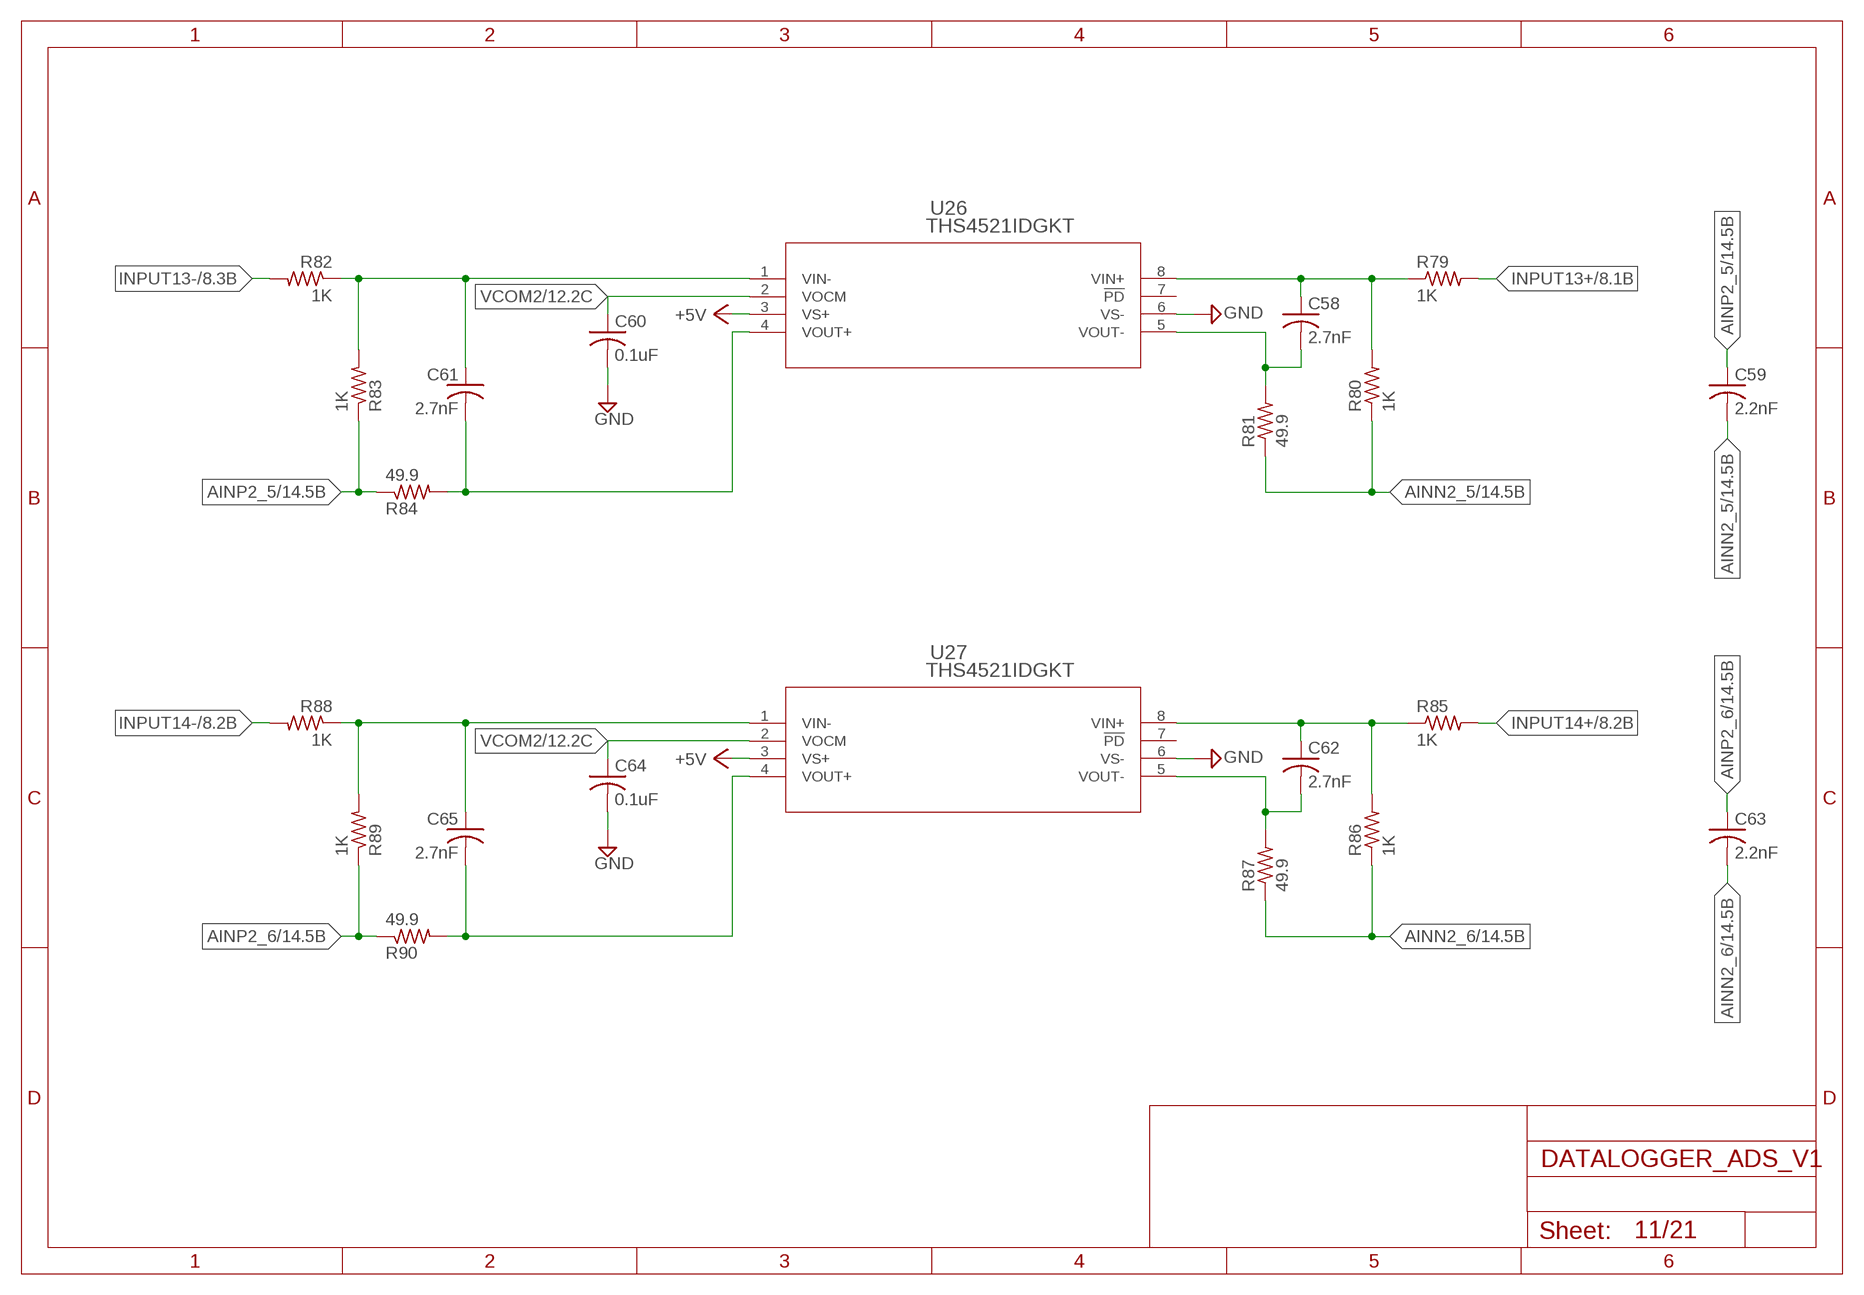
[diagram p10: schematic, sheet 11]

### Parts
C58  2.7nF  C-USC0603  [C0603]
C59  2.2nF  C-USC0603  [C0603]
C60  0.1uF  C-USC0603  [C0603]
C61  2.7nF  C-USC0603  [C0603]
C62  2.7nF  C-USC0603  [C0603]
C63  2.2nF  C-USC0603  [C0603]
C64  0.1uF  C-USC0603  [C0603]
C65  2.7nF  C-USC0603  [C0603]
R79  1K  R-US_R0603  [R0603]
R80  1K  R-US_R0603  [R0603]
R81  49.9  R-US_R0603  [R0603]
R82  1K  R-US_R0603  [R0603]
R83  1K  R-US_R0603  [R0603]
R84  49.9  R-US_R0603  [R0603]
R85  1K  R-US_R0603  [R0603]
R86  1K  R-US_R0603  [R0603]
R87  49.9  R-US_R0603  [R0603]
R88  1K  R-US_R0603  [R0603]
R89  1K  R-US_R0603  [R0603]
R90  49.9  R-US_R0603  [R0603]
U26  THS4521IDGKT  [DGK8]
U27  THS4521IDGKT  [DGK8]

### Nets
+5V: U26.3(VS+) U27.3(VS+) ; also sheet 1,2,3,4,5,6,8,9,10,12,13,14,15,16,17,18,19,21
AINN2_5: C59.2 R80.1 R81.1 ; also sheet 14
AINN2_6: C63.2 R86.1 R87.1 ; also sheet 14
AINP2_5: C59.1 R83.1 R84.1 ; also sheet 14
AINP2_6: C63.1 R89.1 R90.1 ; also sheet 14
GND: C60.2 C64.2 U26.6(VS-) U27.6(VS-) ; also sheet 1,2,3,4,5,6,7,8,9,10,12,13,14,15,16,17,18,19,20,21
INPUT13+: R79.2 ; also sheet 8
INPUT13-: R82.2 ; also sheet 8
INPUT14+: R85.2 ; also sheet 8
INPUT14-: R88.2 ; also sheet 8
N$56: C58.1 R79.1 R80.2 U26.8(VIN+)
N$57: C58.2 R81.2 U26.5(VOUT-)
N$58: C61.1 R82.1 R83.2 U26.1(VIN-)
N$59: C61.2 R84.2 U26.4(VOUT+)
N$60: C62.1 R85.1 R86.2 U27.8(VIN+)
N$61: C62.2 R87.2 U27.5(VOUT-)
N$62: C65.1 R88.1 R89.2 U27.1(VIN-)
N$63: C65.2 R90.2 U27.4(VOUT+)
VCOM2: C60.1 C64.1 U26.2(VOCM) U27.2(VOCM) ; also sheet 9,10,12,13
Unconnected: U26.7(!PD) U27.7(!PD)

## Sheet 12 of 21
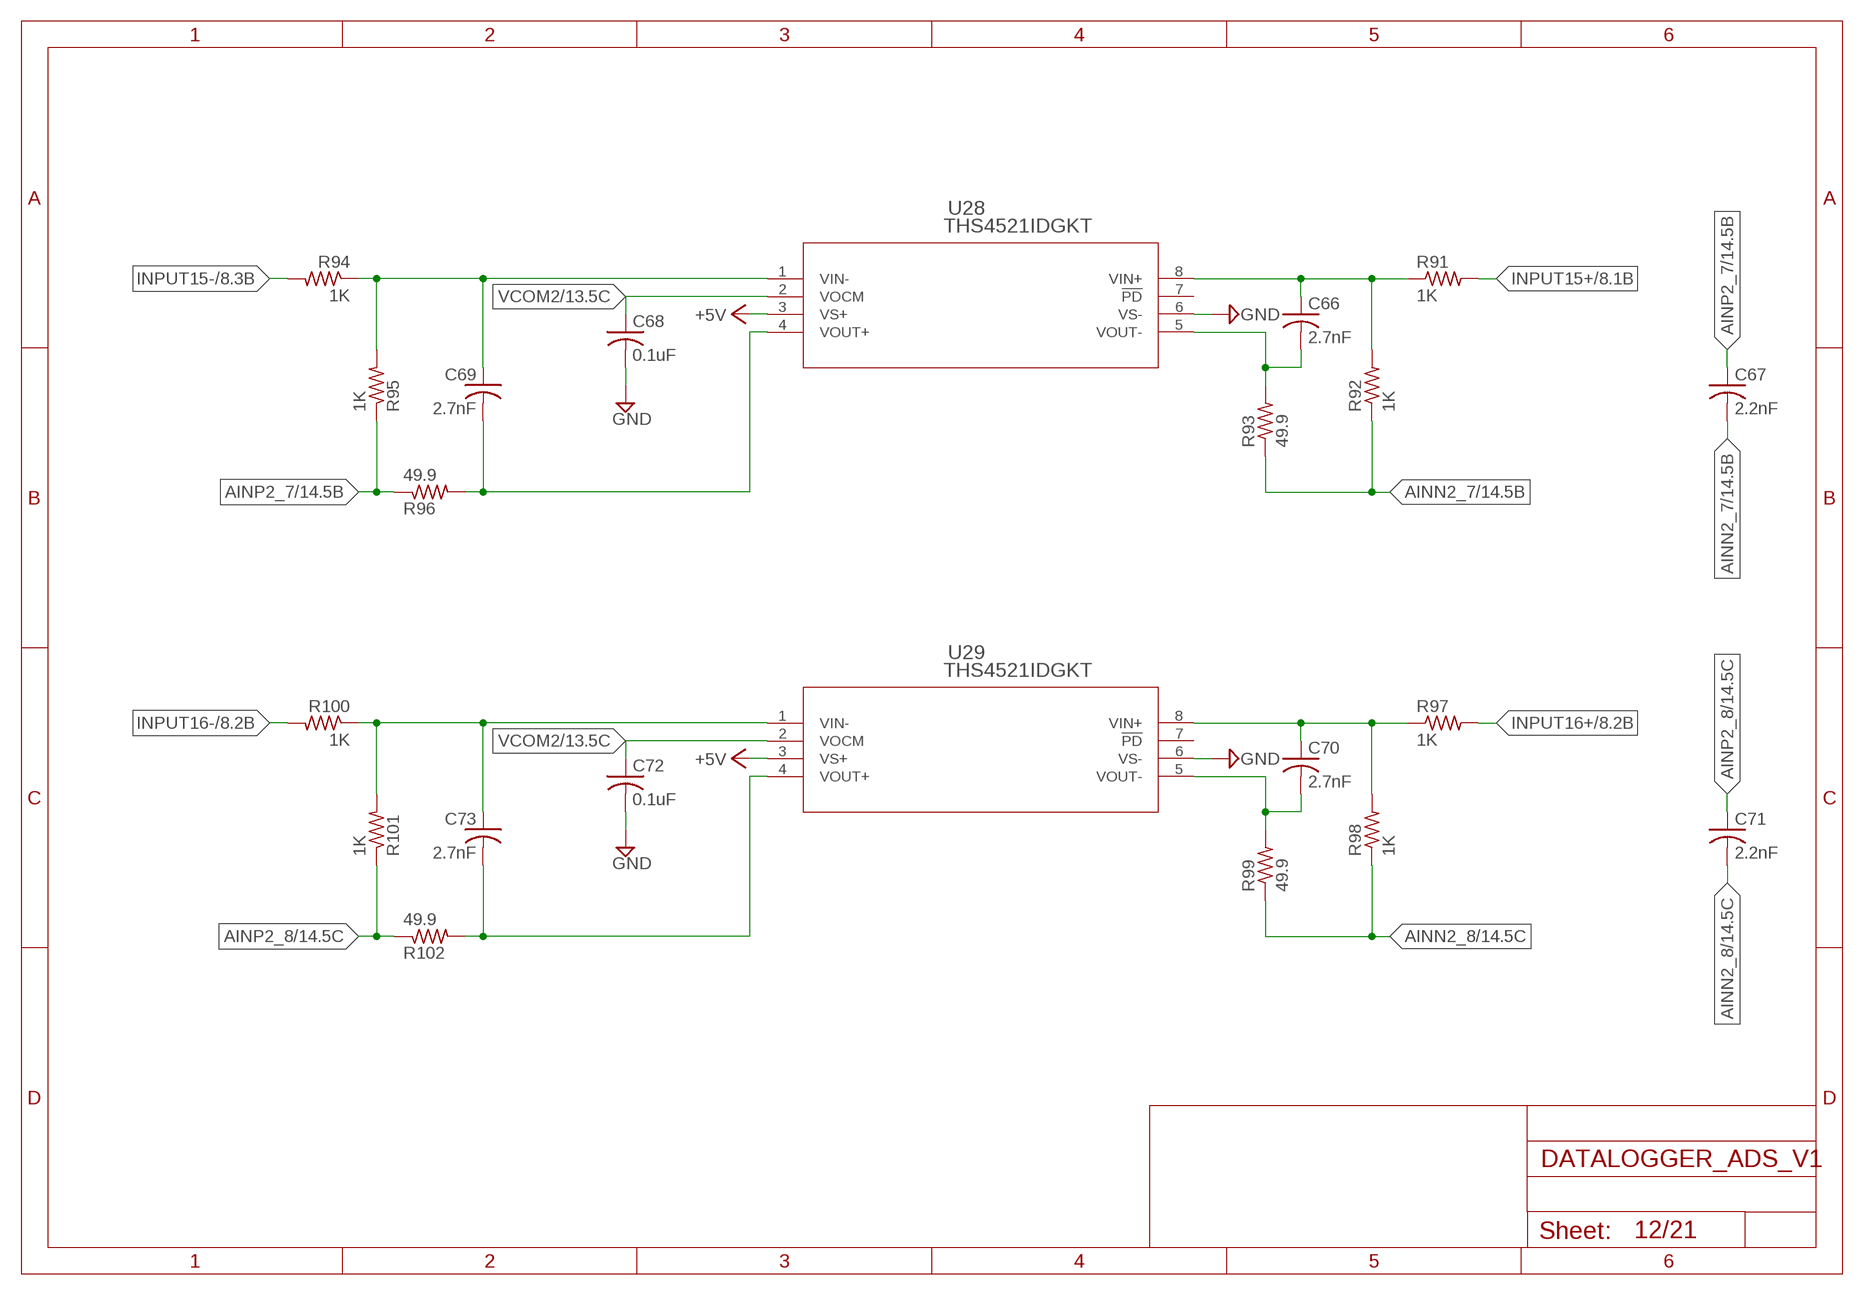
[diagram p11: schematic, sheet 12]

### Parts
C66  2.7nF  C-USC0603  [C0603]
C67  2.2nF  C-USC0603  [C0603]
C68  0.1uF  C-USC0603  [C0603]
C69  2.7nF  C-USC0603  [C0603]
C70  2.7nF  C-USC0603  [C0603]
C71  2.2nF  C-USC0603  [C0603]
C72  0.1uF  C-USC0603  [C0603]
C73  2.7nF  C-USC0603  [C0603]
R91  1K  R-US_R0603  [R0603]
R92  1K  R-US_R0603  [R0603]
R93  49.9  R-US_R0603  [R0603]
R94  1K  R-US_R0603  [R0603]
R95  1K  R-US_R0603  [R0603]
R96  49.9  R-US_R0603  [R0603]
R97  1K  R-US_R0603  [R0603]
R98  1K  R-US_R0603  [R0603]
R99  49.9  R-US_R0603  [R0603]
R100  1K  R-US_R0603  [R0603]
R101  1K  R-US_R0603  [R0603]
R102  49.9  R-US_R0603  [R0603]
U28  THS4521IDGKT  [DGK8]
U29  THS4521IDGKT  [DGK8]

### Nets
+5V: U28.3(VS+) U29.3(VS+) ; also sheet 1,2,3,4,5,6,8,9,10,11,13,14,15,16,17,18,19,21
AINN2_7: C67.2 R92.1 R93.1 ; also sheet 14
AINN2_8: C71.2 R98.1 R99.1 ; also sheet 14
AINP2_7: C67.1 R95.1 R96.1 ; also sheet 14
AINP2_8: C71.1 R101.1 R102.1 ; also sheet 14
GND: C68.2 C72.2 U28.6(VS-) U29.6(VS-) ; also sheet 1,2,3,4,5,6,7,8,9,10,11,13,14,15,16,17,18,19,20,21
INPUT15+: R91.2 ; also sheet 8
INPUT15-: R94.2 ; also sheet 8
INPUT16+: R97.2 ; also sheet 8
INPUT16-: R100.2 ; also sheet 8
N$64: C66.1 R91.1 R92.2 U28.8(VIN+)
N$65: C66.2 R93.2 U28.5(VOUT-)
N$66: C69.1 R94.1 R95.2 U28.1(VIN-)
N$67: C69.2 R96.2 U28.4(VOUT+)
N$68: C70.1 R97.1 R98.2 U29.8(VIN+)
N$69: C70.2 R99.2 U29.5(VOUT-)
N$70: C73.1 R100.1 R101.2 U29.1(VIN-)
N$71: C73.2 R102.2 U29.4(VOUT+)
VCOM2: C68.1 C72.1 U28.2(VOCM) U29.2(VOCM) ; also sheet 9,10,11,13
Unconnected: U28.7(!PD) U29.7(!PD)

## Sheet 13 of 21
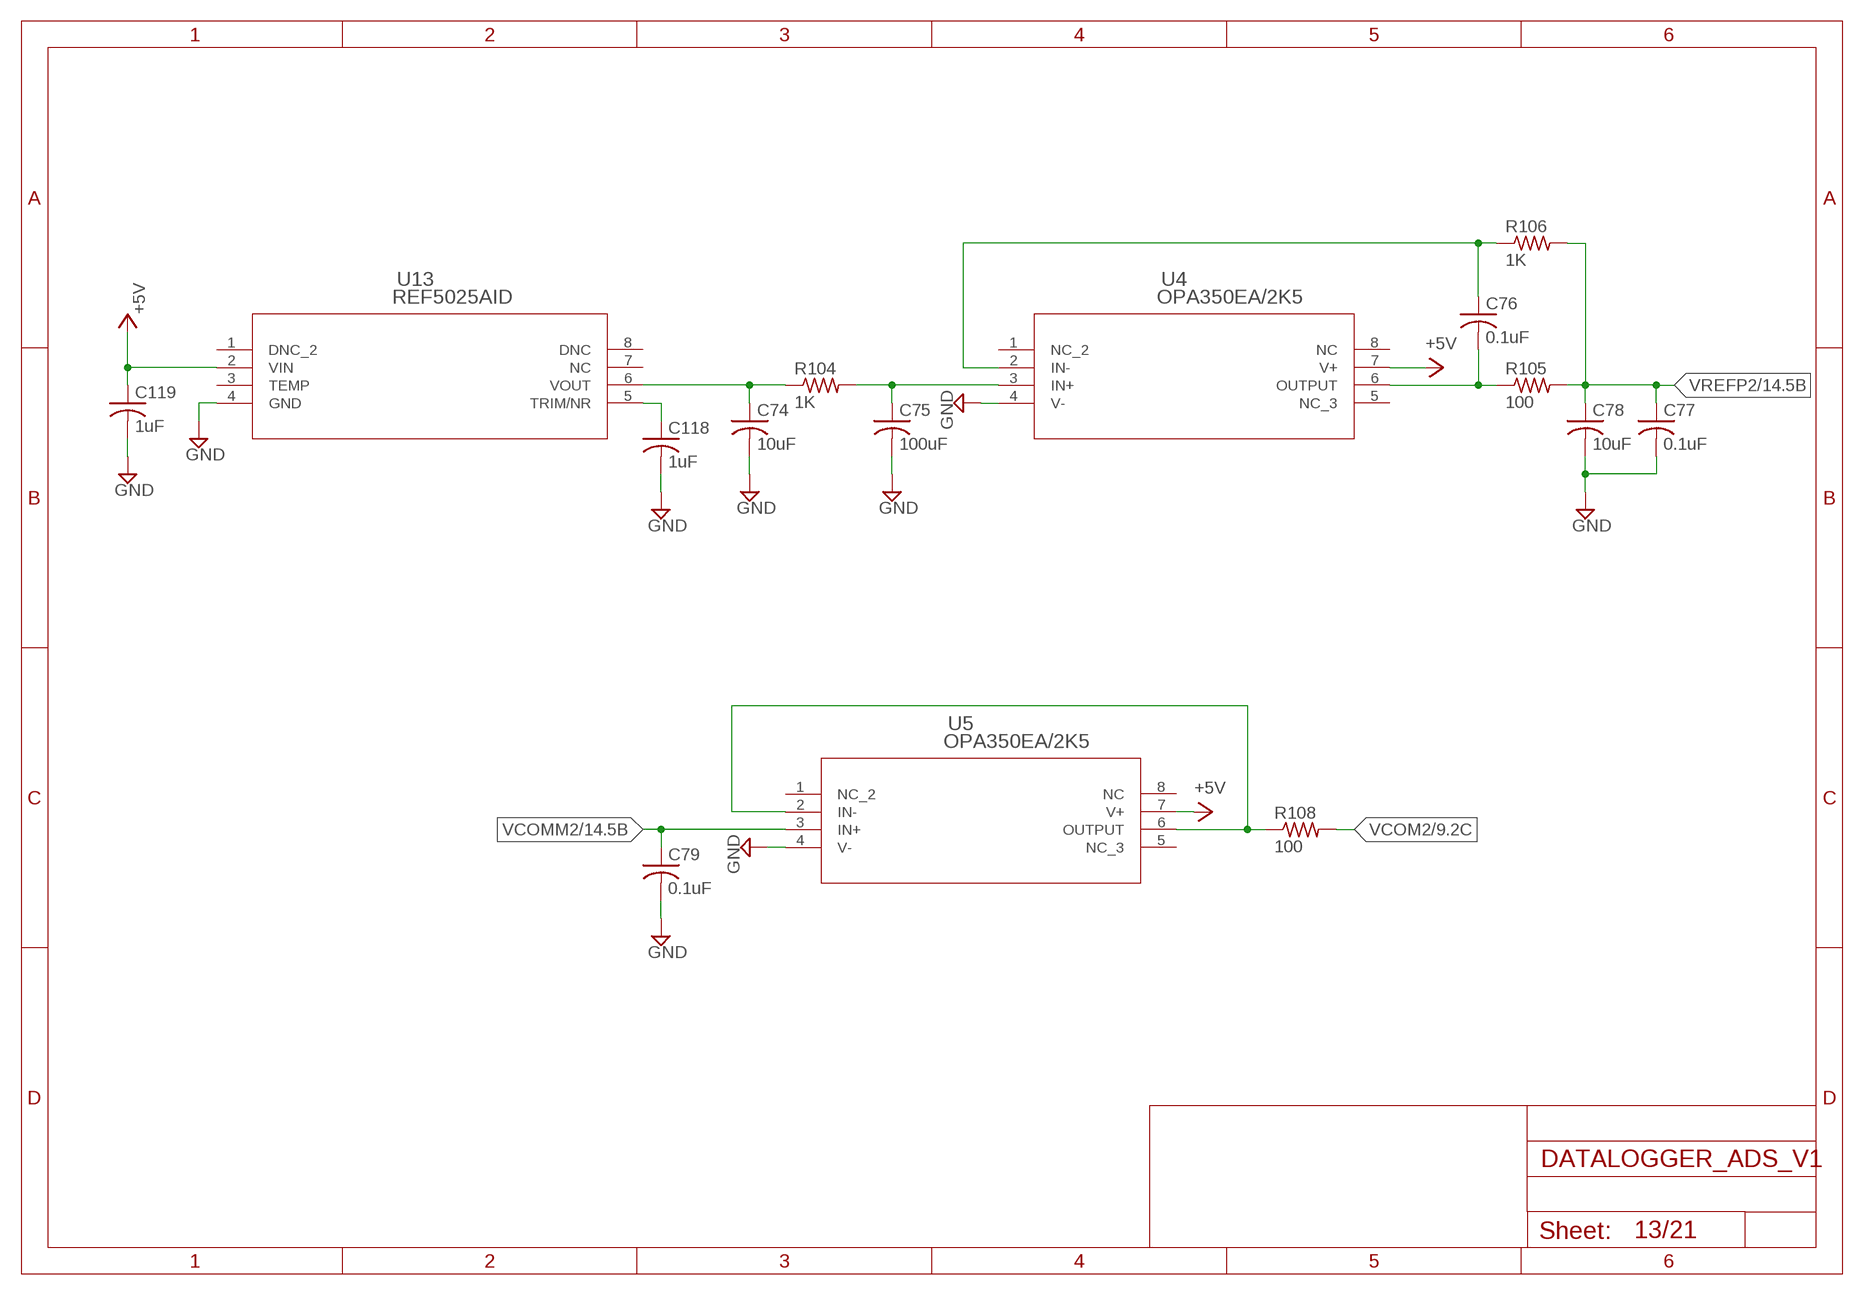
[diagram p12: schematic, sheet 13]

### Parts
C74  10uF  C-USC0603  [C0603]
C75  100uF  C-USC1206  [C1206]
C76  0.1uF  C-USC0603  [C0603]
C77  0.1uF  C-USC0603  [C0603]
C78  10uF  C-USC0603  [C0603]
C79  0.1uF  C-USC0603  [C0603]
C118  1uF  C-USC0603  [C0603]
C119  1uF  C-USC0603  [C0603]
R104  1K  R-US_R0603  [R0603]
R105  100  R-US_R0603  [R0603]
R106  1K  R-US_R0603  [R0603]
R108  100  R-US_R0603  [R0603]
U4  OPA350EA/2K5  [DGK8_TEX]
U5  OPA350EA/2K5  [DGK8_TEX]
U13  REF5025AID  [D8]

### Nets
+5V: C119.1 U4.7(V+) U5.7(V+) U13.2(VIN) ; also sheet 1,2,3,4,5,6,8,9,10,11,12,14,15,16,17,18,19,21
GND: C74.2 C75.2 C77.2 C78.2 C79.2 C118.2 C119.2 U4.4(V-) U5.4(V-) U13.4(GND) ; also sheet 1,2,3,4,5,6,7,8,9,10,11,12,14,15,16,17,18,19,20,21
N$72: C75.1 R104.2 U4.3(IN+)
N$73: C74.1 R104.1 U13.6(VOUT)
N$74: C118.1 U13.5(TRIM/NR)
N$76: C76.1 R106.1 U4.2(IN-)
N$77: C76.2 R105.1 U4.6(OUTPUT)
N$78: R108.1 U5.2(IN-) U5.6(OUTPUT)
VCOM2: R108.2 ; also sheet 9,10,11,12
VCOMM2: C79.1 U5.3(IN+) ; also sheet 14
VREFP2: C77.1 C78.1 R105.2 R106.2 ; also sheet 14
Unconnected: U4.1(NC_2) U4.5(NC_3) U4.8(NC) U5.1(NC_2) U5.5(NC_3) U5.8(NC) U13.1(DNC_2) U13.3(TEMP) U13.7(NC) U13.8(DNC)

## Sheet 14 of 21
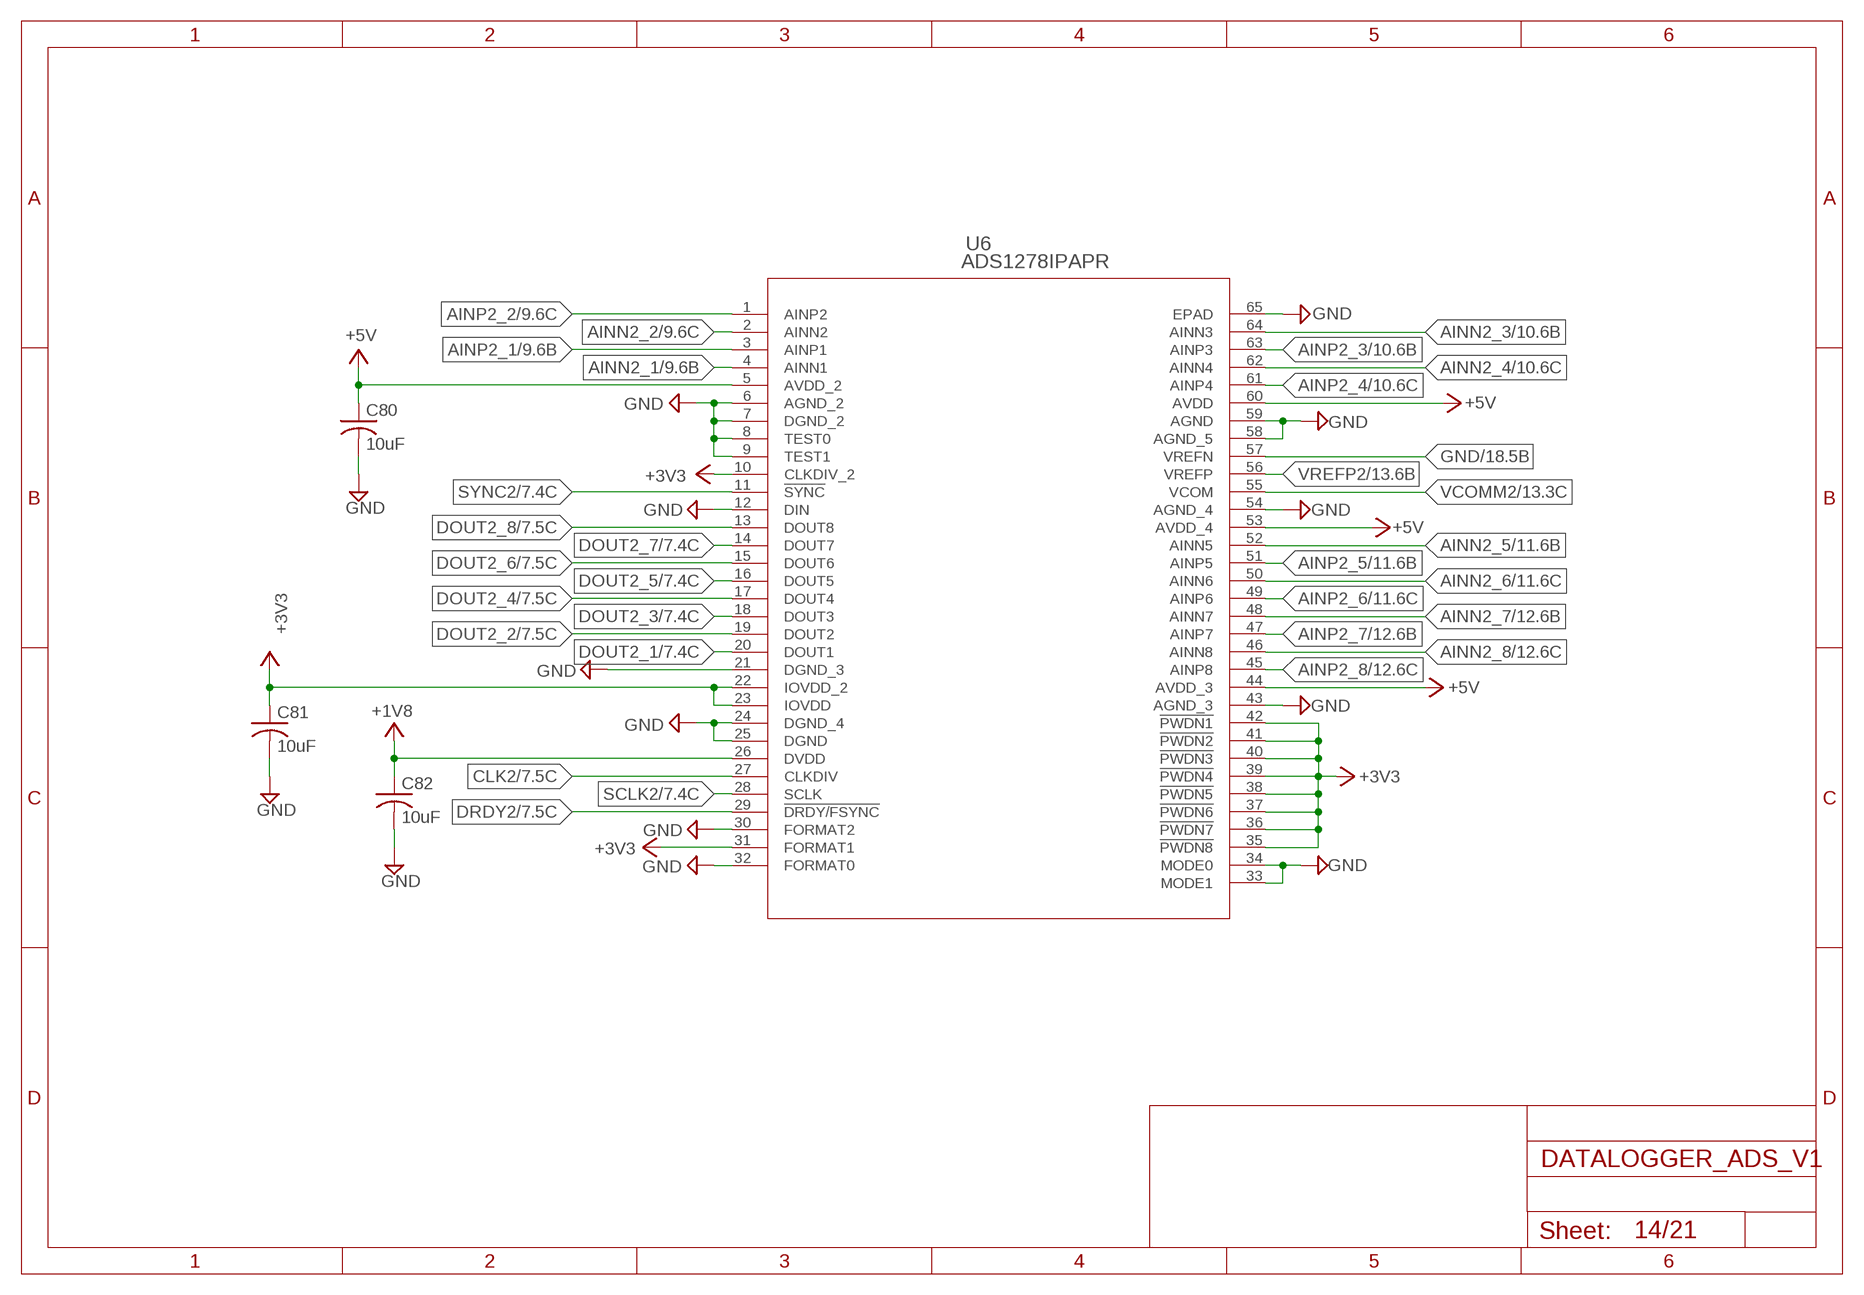
[diagram p13: schematic, sheet 14]

### Parts
C80  10uF  C-USC0603  [C0603]
C81  10uF  C-USC0603  [C0603]
C82  10uF  C-USC0603  [C0603]
U6  ADS1278IPAPR  [PAP64_7X7]

### Nets
+1V8: C82.1 U6.26(DVDD) ; also sheet 6,18,21
+3V3: C81.1 U6.10(CLKDIV_2) U6.22(IOVDD_2) U6.23(IOVDD) U6.31(FORMAT1) U6.35(!PWDN8) U6.36(!PWDN7) U6.37(!PWDN6) U6.38(!PWDN5) U6.39(!PWDN4) U6.40(!PWDN3) U6.41(!PWDN2) U6.42(!PWDN1) ; also sheet 6,18,19,20,21
+5V: C80.1 U6.5(AVDD_2) U6.44(AVDD_3) U6.53(AVDD_4) U6.60(AVDD) ; also sheet 1,2,3,4,5,6,8,9,10,11,12,13,15,16,17,18,19,21
AINN2_1: U6.4(AINN1) ; also sheet 9
AINN2_2: U6.2(AINN2) ; also sheet 9
AINN2_3: U6.64(AINN3) ; also sheet 10
AINN2_4: U6.62(AINN4) ; also sheet 10
AINN2_5: U6.52(AINN5) ; also sheet 11
AINN2_6: U6.50(AINN6) ; also sheet 11
AINN2_7: U6.48(AINN7) ; also sheet 12
AINN2_8: U6.46(AINN8) ; also sheet 12
AINP2_1: U6.3(AINP1) ; also sheet 9
AINP2_2: U6.1(AINP2) ; also sheet 9
AINP2_3: U6.63(AINP3) ; also sheet 10
AINP2_4: U6.61(AINP4) ; also sheet 10
AINP2_5: U6.51(AINP5) ; also sheet 11
AINP2_6: U6.49(AINP6) ; also sheet 11
AINP2_7: U6.47(AINP7) ; also sheet 12
AINP2_8: U6.45(AINP8) ; also sheet 12
CLK2: U6.27(CLKDIV) ; also sheet 7
DOUT2_1: U6.20(DOUT1) ; also sheet 7
DOUT2_2: U6.19(DOUT2) ; also sheet 7
DOUT2_3: U6.18(DOUT3) ; also sheet 7
DOUT2_4: U6.17(DOUT4) ; also sheet 7
DOUT2_5: U6.16(DOUT5) ; also sheet 7
DOUT2_6: U6.15(DOUT6) ; also sheet 7
DOUT2_7: U6.14(DOUT7) ; also sheet 7
DOUT2_8: U6.13(DOUT8) ; also sheet 7
DRDY2: U6.29(!DRDY/FSYNC) ; also sheet 7
GND: C80.2 C81.2 C82.2 U6.6(AGND_2) U6.7(DGND_2) U6.8(TEST0) U6.9(TEST1) U6.12(DIN) U6.21(DGND_3) U6.24(DGND_4) U6.25(DGND) U6.30(FORMAT2) U6.32(FORMAT0) U6.33(MODE1) U6.34(MODE0) U6.43(AGND_3) U6.54(AGND_4) U6.57(VREFN) U6.58(AGND_5) U6.59(AGND) U6.65(EPAD) ; also sheet 1,2,3,4,5,6,7,8,9,10,11,12,13,15,16,17,18,19,20,21
SCLK2: U6.28(SCLK) ; also sheet 7
SYNC2: U6.11(!SYNC) ; also sheet 7
VCOMM2: U6.55(VCOM) ; also sheet 13
VREFP2: U6.56(VREFP) ; also sheet 13

## Sheet 15 of 21
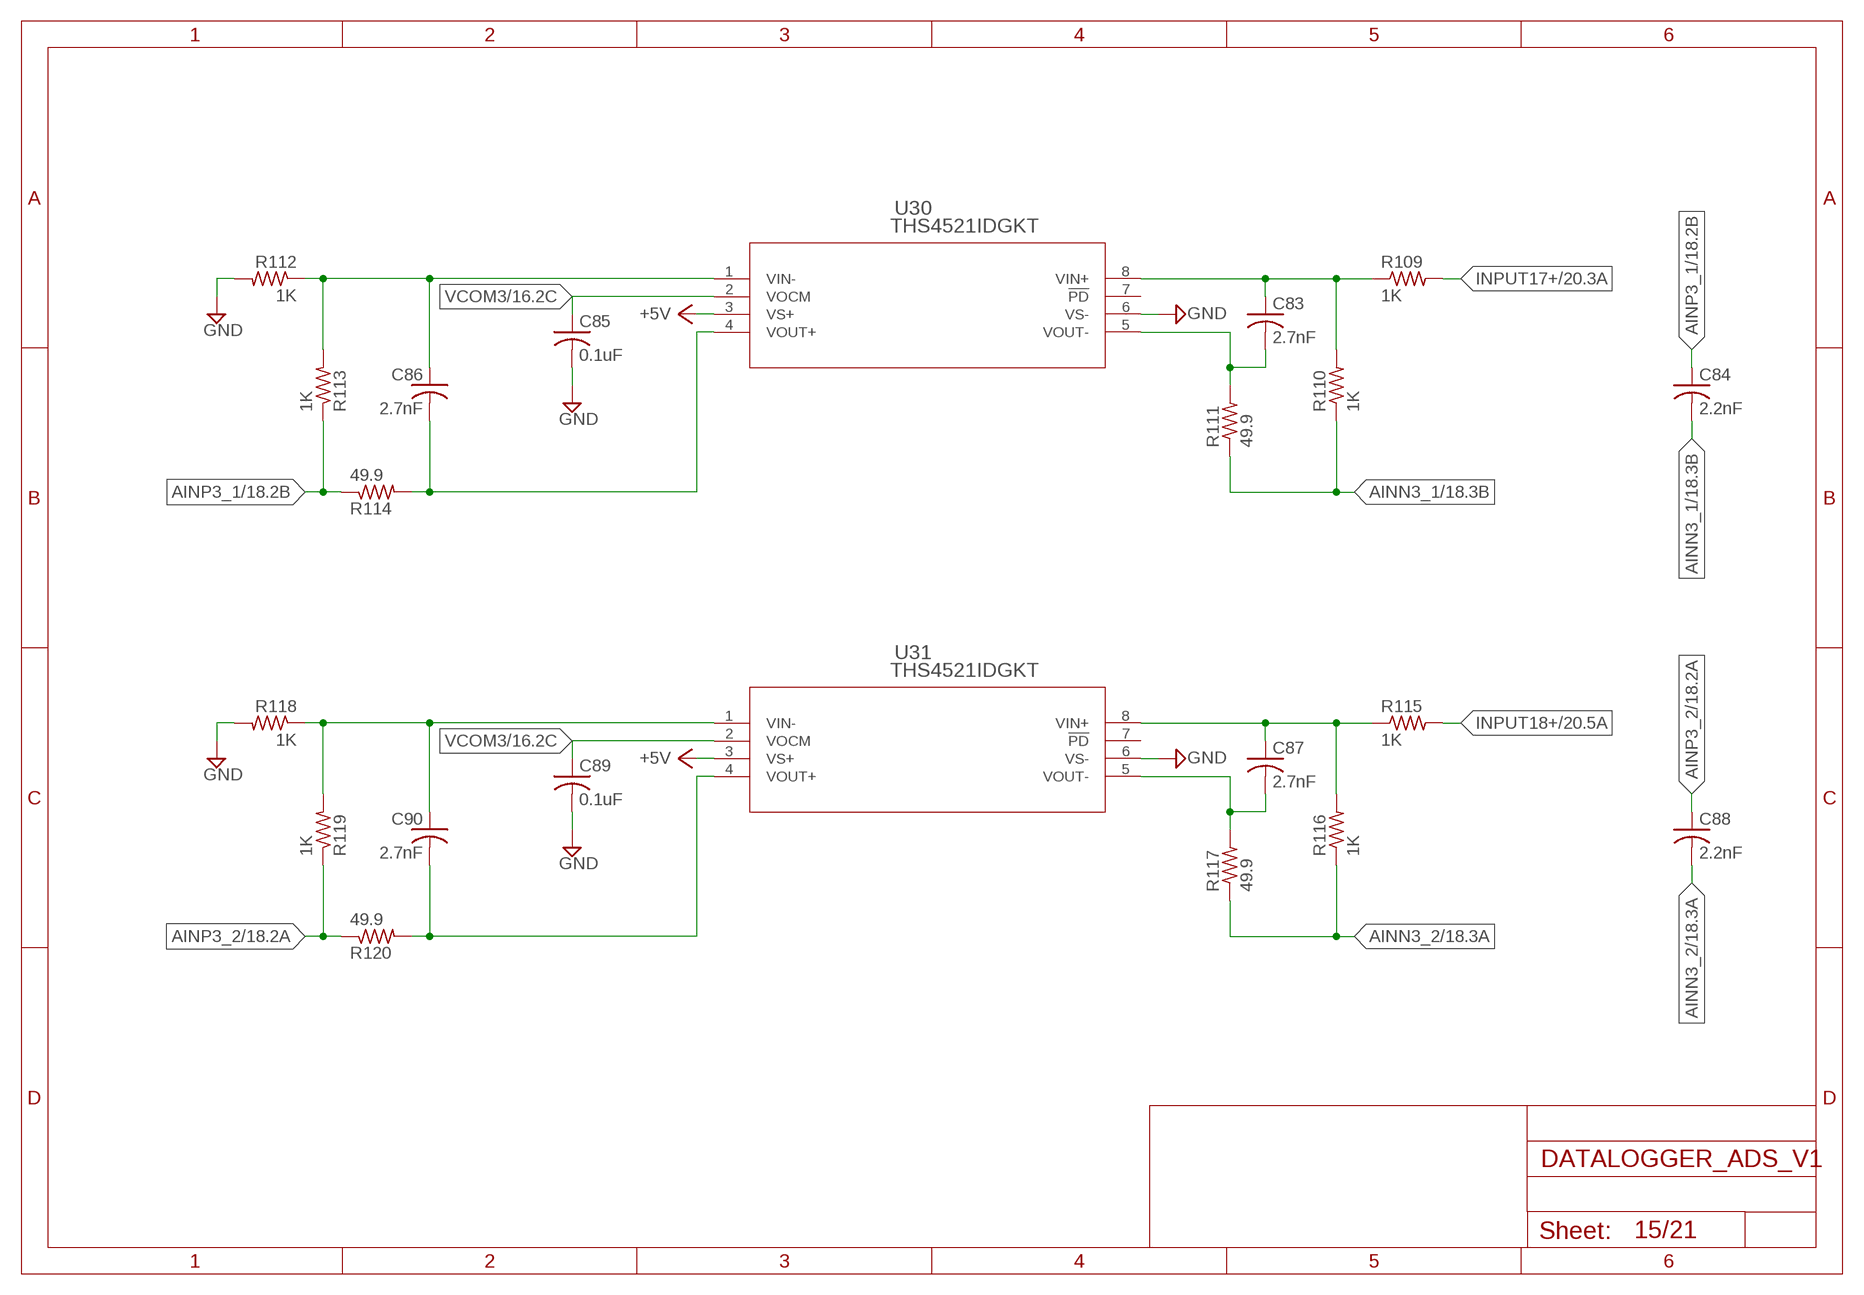
[diagram p14: schematic, sheet 15]

### Parts
C83  2.7nF  C-USC0603  [C0603]
C84  2.2nF  C-USC0603  [C0603]
C85  0.1uF  C-USC0603  [C0603]
C86  2.7nF  C-USC0603  [C0603]
C87  2.7nF  C-USC0603  [C0603]
C88  2.2nF  C-USC0603  [C0603]
C89  0.1uF  C-USC0603  [C0603]
C90  2.7nF  C-USC0603  [C0603]
R109  1K  R-US_R0603  [R0603]
R110  1K  R-US_R0603  [R0603]
R111  49.9  R-US_R0603  [R0603]
R112  1K  R-US_R0603  [R0603]
R113  1K  R-US_R0603  [R0603]
R114  49.9  R-US_R0603  [R0603]
R115  1K  R-US_R0603  [R0603]
R116  1K  R-US_R0603  [R0603]
R117  49.9  R-US_R0603  [R0603]
R118  1K  R-US_R0603  [R0603]
R119  1K  R-US_R0603  [R0603]
R120  49.9  R-US_R0603  [R0603]
U30  THS4521IDGKT  [DGK8]
U31  THS4521IDGKT  [DGK8]

### Nets
+5V: U30.3(VS+) U31.3(VS+) ; also sheet 1,2,3,4,5,6,8,9,10,11,12,13,14,16,17,18,19,21
AINN3_1: C84.2 R110.1 R111.1 ; also sheet 18
AINN3_2: C88.2 R116.1 R117.1 ; also sheet 18
AINP3_1: C84.1 R113.1 R114.1 ; also sheet 18
AINP3_2: C88.1 R119.1 R120.1 ; also sheet 18
GND: C85.2 C89.2 R112.2 R118.2 U30.6(VS-) U31.6(VS-) ; also sheet 1,2,3,4,5,6,7,8,9,10,11,12,13,14,16,17,18,19,20,21
INPUT17+: R109.2 ; also sheet 20
INPUT18+: R115.2 ; also sheet 20
N$79: C83.1 R109.1 R110.2 U30.8(VIN+)
N$80: C83.2 R111.2 U30.5(VOUT-)
N$81: C86.1 R112.1 R113.2 U30.1(VIN-)
N$82: C86.2 R114.2 U30.4(VOUT+)
N$83: C87.1 R115.1 R116.2 U31.8(VIN+)
N$84: C87.2 R117.2 U31.5(VOUT-)
N$85: C90.1 R118.1 R119.2 U31.1(VIN-)
N$86: C90.2 R120.2 U31.4(VOUT+)
VCOM3: C85.1 C89.1 U30.2(VOCM) U31.2(VOCM) ; also sheet 16,17
Unconnected: U30.7(!PD) U31.7(!PD)

## Sheet 16 of 21
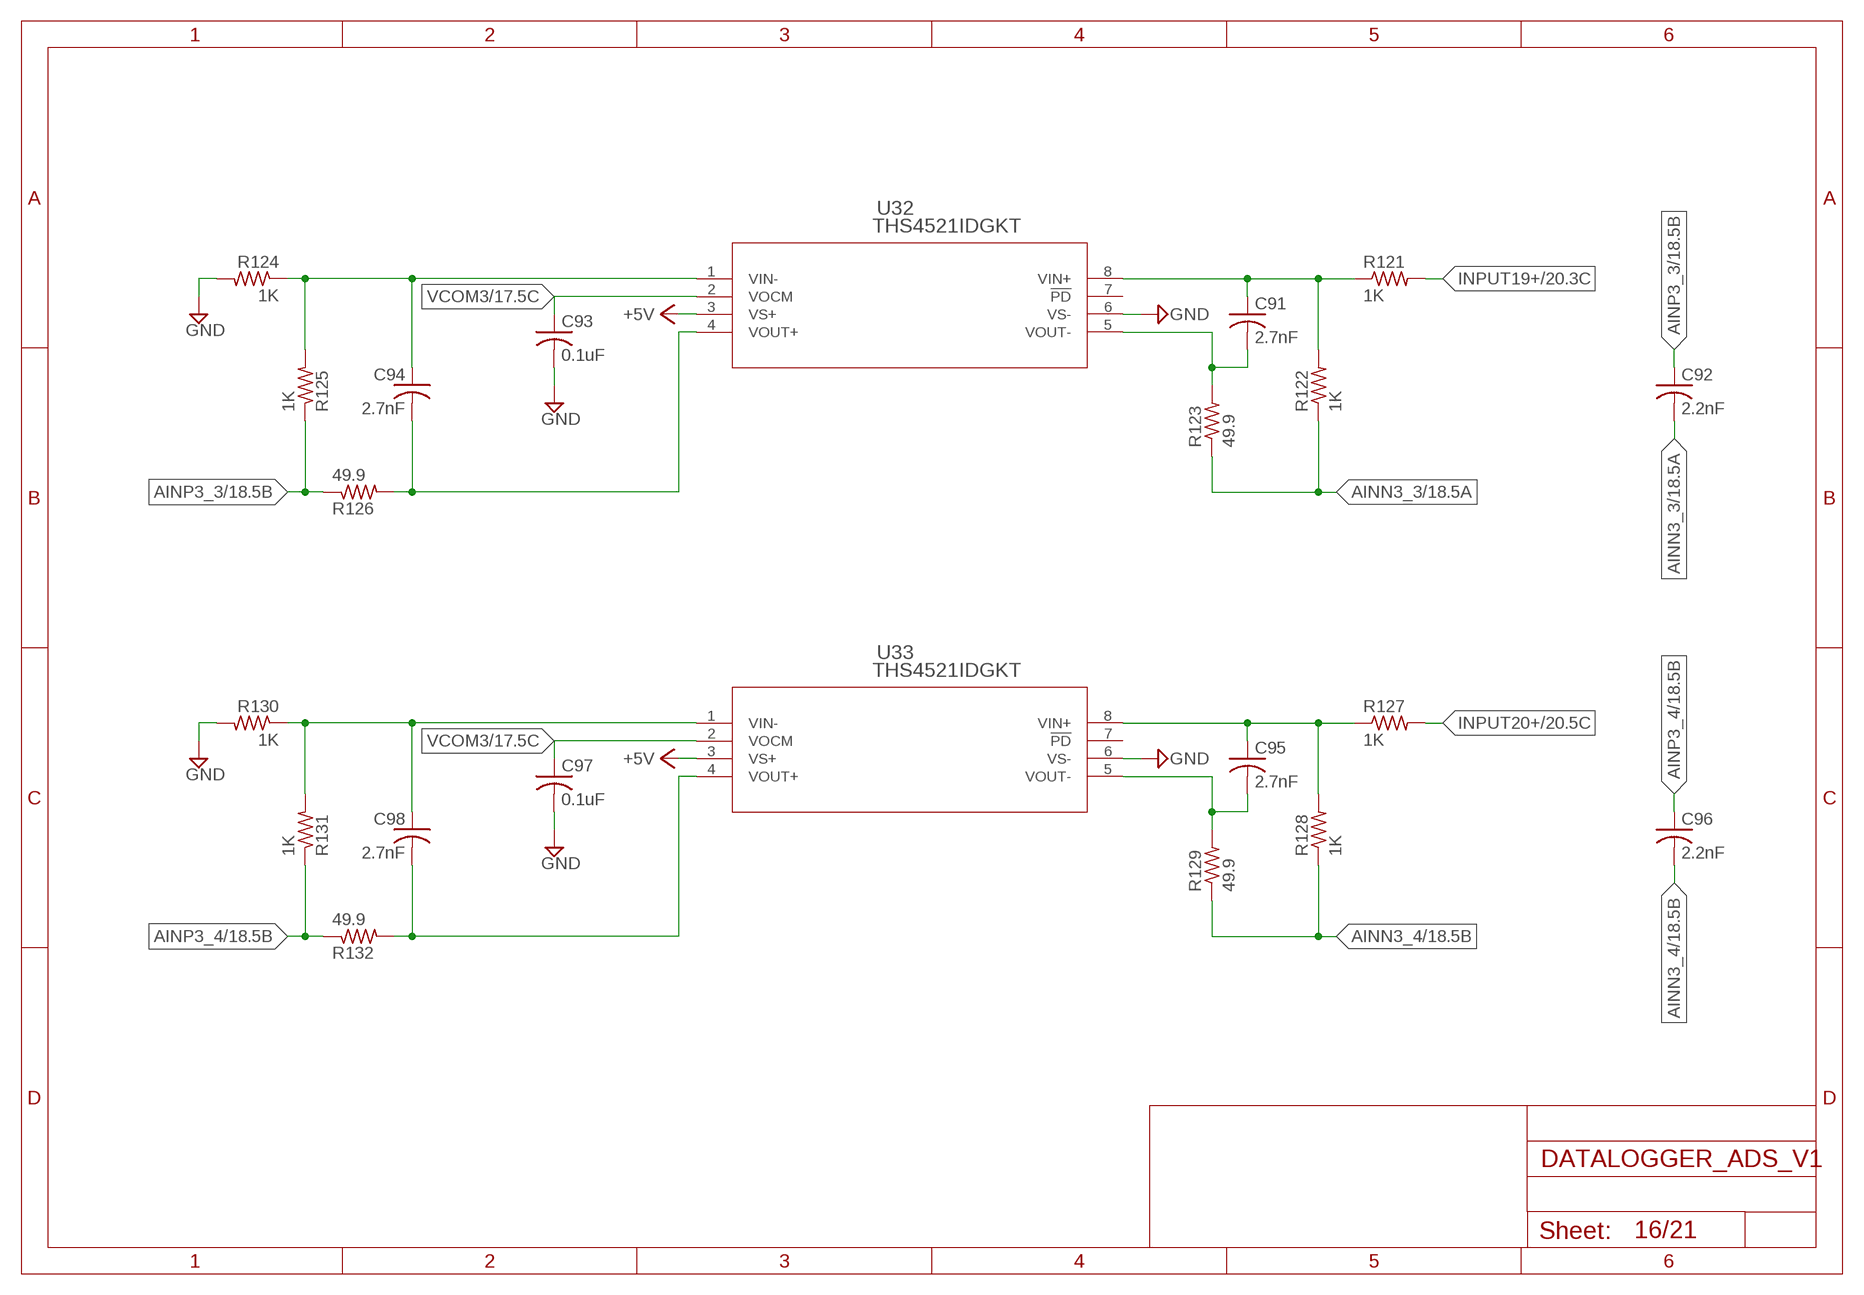
[diagram p15: schematic, sheet 16]

### Parts
C91  2.7nF  C-USC0603  [C0603]
C92  2.2nF  C-USC0603  [C0603]
C93  0.1uF  C-USC0603  [C0603]
C94  2.7nF  C-USC0603  [C0603]
C95  2.7nF  C-USC0603  [C0603]
C96  2.2nF  C-USC0603  [C0603]
C97  0.1uF  C-USC0603  [C0603]
C98  2.7nF  C-USC0603  [C0603]
R121  1K  R-US_R0603  [R0603]
R122  1K  R-US_R0603  [R0603]
R123  49.9  R-US_R0603  [R0603]
R124  1K  R-US_R0603  [R0603]
R125  1K  R-US_R0603  [R0603]
R126  49.9  R-US_R0603  [R0603]
R127  1K  R-US_R0603  [R0603]
R128  1K  R-US_R0603  [R0603]
R129  49.9  R-US_R0603  [R0603]
R130  1K  R-US_R0603  [R0603]
R131  1K  R-US_R0603  [R0603]
R132  49.9  R-US_R0603  [R0603]
U32  THS4521IDGKT  [DGK8]
U33  THS4521IDGKT  [DGK8]

### Nets
+5V: U32.3(VS+) U33.3(VS+) ; also sheet 1,2,3,4,5,6,8,9,10,11,12,13,14,15,17,18,19,21
AINN3_3: C92.2 R122.1 R123.1 ; also sheet 18
AINN3_4: C96.2 R128.1 R129.1 ; also sheet 18
AINP3_3: C92.1 R125.1 R126.1 ; also sheet 18
AINP3_4: C96.1 R131.1 R132.1 ; also sheet 18
GND: C93.2 C97.2 R124.2 R130.2 U32.6(VS-) U33.6(VS-) ; also sheet 1,2,3,4,5,6,7,8,9,10,11,12,13,14,15,17,18,19,20,21
INPUT19+: R121.2 ; also sheet 20
INPUT20+: R127.2 ; also sheet 20
N$87: C91.1 R121.1 R122.2 U32.8(VIN+)
N$88: C91.2 R123.2 U32.5(VOUT-)
N$89: C94.1 R124.1 R125.2 U32.1(VIN-)
N$90: C94.2 R126.2 U32.4(VOUT+)
N$91: C95.1 R127.1 R128.2 U33.8(VIN+)
N$92: C95.2 R129.2 U33.5(VOUT-)
N$93: C98.1 R130.1 R131.2 U33.1(VIN-)
N$94: C98.2 R132.2 U33.4(VOUT+)
VCOM3: C93.1 C97.1 U32.2(VOCM) U33.2(VOCM) ; also sheet 15,17
Unconnected: U32.7(!PD) U33.7(!PD)

## Sheet 17 of 21
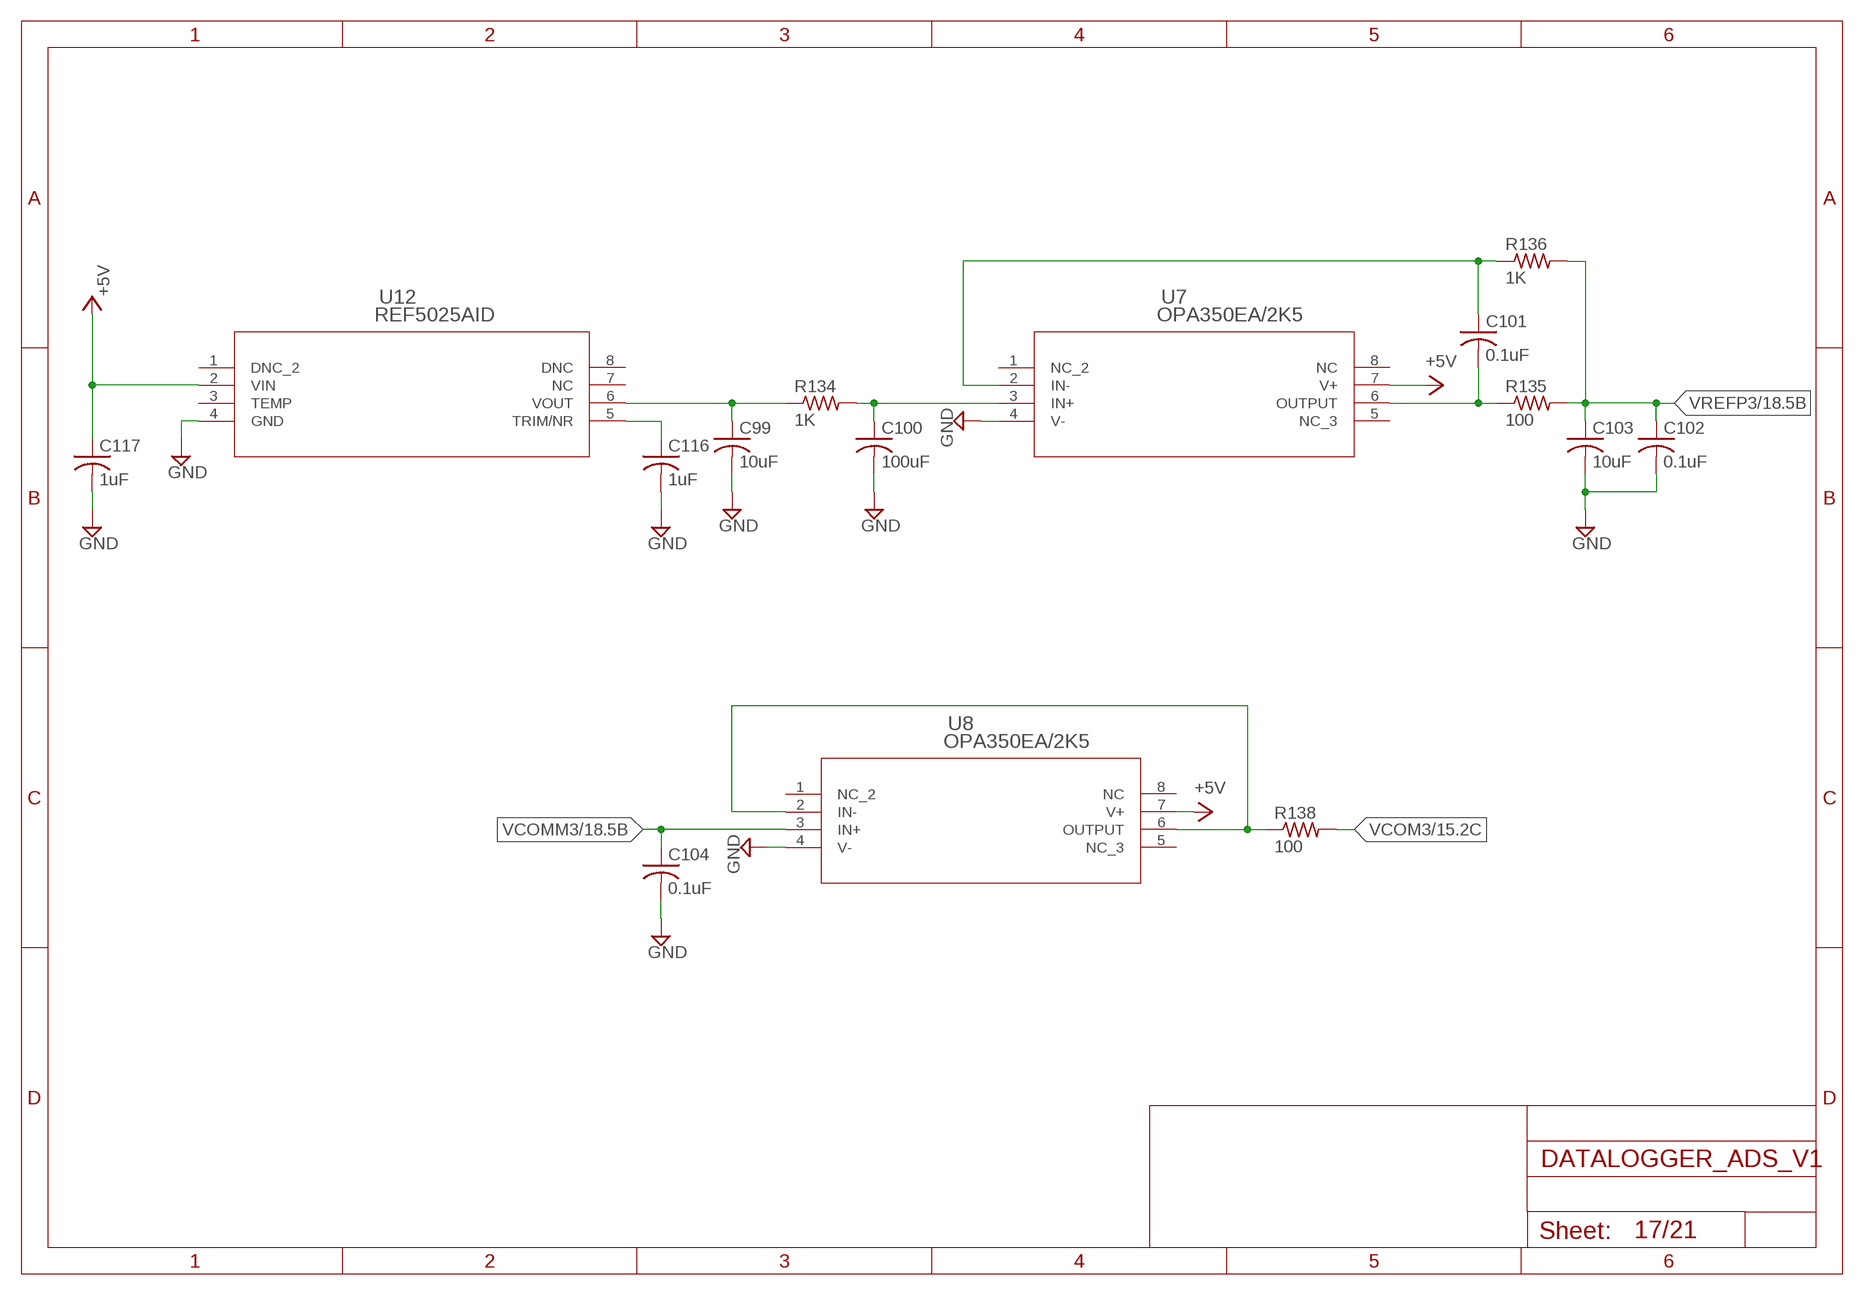
[diagram p16: schematic, sheet 17]

### Parts
C99  10uF  C-USC0603  [C0603]
C100  100uF  C-USC1206  [C1206]
C101  0.1uF  C-USC0603  [C0603]
C102  0.1uF  C-USC0603  [C0603]
C103  10uF  C-USC0603  [C0603]
C104  0.1uF  C-USC0603  [C0603]
C116  1uF  C-USC0603  [C0603]
C117  1uF  C-USC0603  [C0603]
R134  1K  R-US_R0603  [R0603]
R135  100  R-US_R0603  [R0603]
R136  1K  R-US_R0603  [R0603]
R138  100  R-US_R0603  [R0603]
U7  OPA350EA/2K5  [DGK8_TEX]
U8  OPA350EA/2K5  [DGK8_TEX]
U12  REF5025AID  [D8]

### Nets
+5V: C117.1 U7.7(V+) U8.7(V+) U12.2(VIN) ; also sheet 1,2,3,4,5,6,8,9,10,11,12,13,14,15,16,18,19,21
GND: C99.2 C100.2 C102.2 C103.2 C104.2 C116.2 C117.2 U7.4(V-) U8.4(V-) U12.4(GND) ; also sheet 1,2,3,4,5,6,7,8,9,10,11,12,13,14,15,16,18,19,20,21
N$34: C99.1 R134.1 U12.6(VOUT)
N$95: C100.1 R134.2 U7.3(IN+)
N$96: C116.1 U12.5(TRIM/NR)
N$99: C101.1 R136.1 U7.2(IN-)
N$100: C101.2 R135.1 U7.6(OUTPUT)
N$101: R138.1 U8.2(IN-) U8.6(OUTPUT)
VCOM3: R138.2 ; also sheet 15,16
VCOMM3: C104.1 U8.3(IN+) ; also sheet 18
VREFP3: C102.1 C103.1 R135.2 R136.2 ; also sheet 18
Unconnected: U7.1(NC_2) U7.5(NC_3) U7.8(NC) U8.1(NC_2) U8.5(NC_3) U8.8(NC) U12.1(DNC_2) U12.3(TEMP) U12.7(NC) U12.8(DNC)

## Sheet 18 of 21
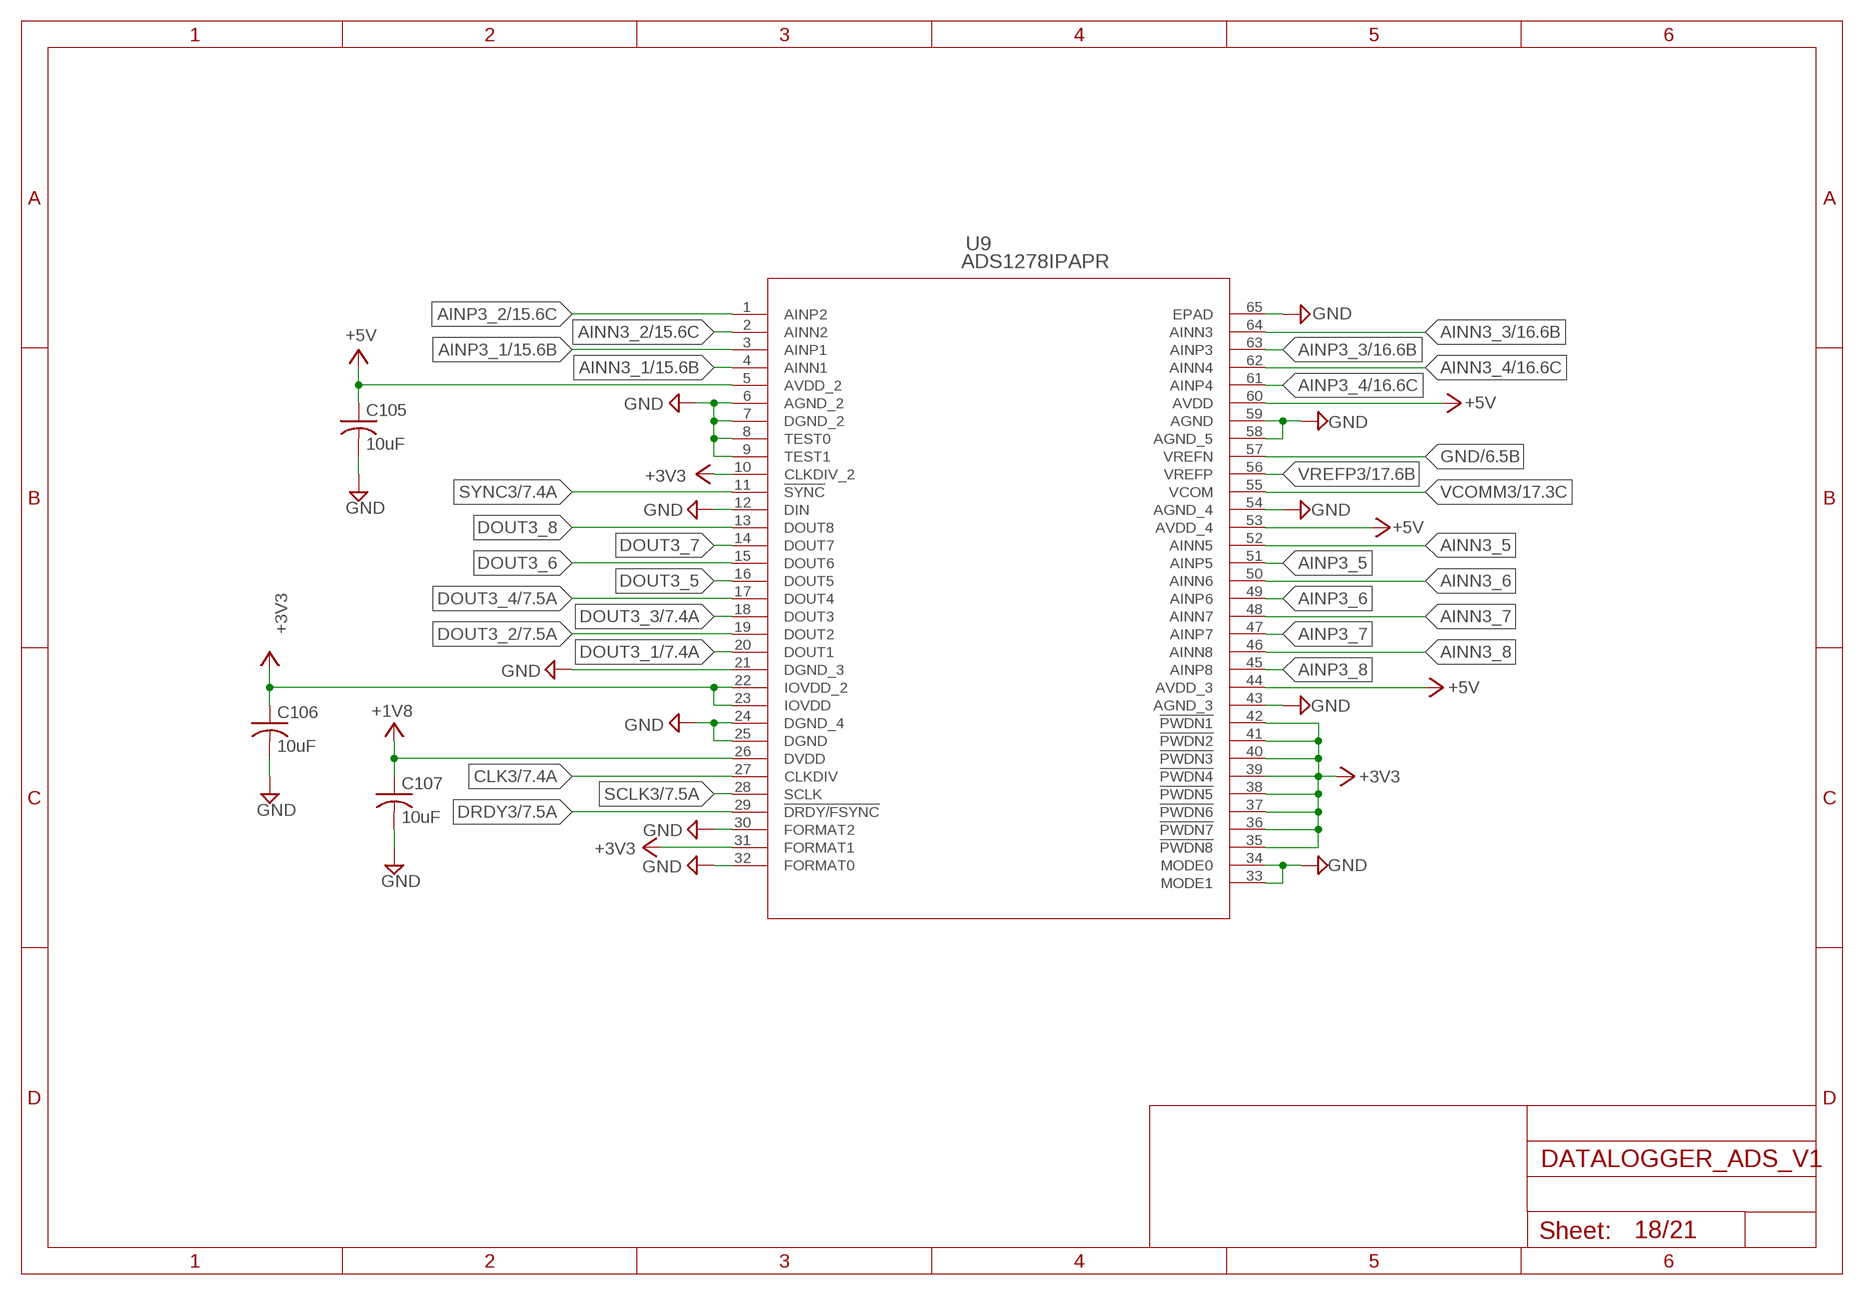
[diagram p17: schematic, sheet 18]

### Parts
C105  10uF  C-USC0603  [C0603]
C106  10uF  C-USC0603  [C0603]
C107  10uF  C-USC0603  [C0603]
U9  ADS1278IPAPR  [PAP64_7X7]

### Nets
+1V8: C107.1 U9.26(DVDD) ; also sheet 6,14,21
+3V3: C106.1 U9.10(CLKDIV_2) U9.22(IOVDD_2) U9.23(IOVDD) U9.31(FORMAT1) U9.35(!PWDN8) U9.36(!PWDN7) U9.37(!PWDN6) U9.38(!PWDN5) U9.39(!PWDN4) U9.40(!PWDN3) U9.41(!PWDN2) U9.42(!PWDN1) ; also sheet 6,14,19,20,21
+5V: C105.1 U9.5(AVDD_2) U9.44(AVDD_3) U9.53(AVDD_4) U9.60(AVDD) ; also sheet 1,2,3,4,5,6,8,9,10,11,12,13,14,15,16,17,19,21
AINN3_1: U9.4(AINN1) ; also sheet 15
AINN3_2: U9.2(AINN2) ; also sheet 15
AINN3_3: U9.64(AINN3) ; also sheet 16
AINN3_4: U9.62(AINN4) ; also sheet 16
AINN3_5: U9.52(AINN5)
AINN3_6: U9.50(AINN6)
AINN3_7: U9.48(AINN7)
AINN3_8: U9.46(AINN8)
AINP3_1: U9.3(AINP1) ; also sheet 15
AINP3_2: U9.1(AINP2) ; also sheet 15
AINP3_3: U9.63(AINP3) ; also sheet 16
AINP3_4: U9.61(AINP4) ; also sheet 16
AINP3_5: U9.51(AINP5)
AINP3_6: U9.49(AINP6)
AINP3_7: U9.47(AINP7)
AINP3_8: U9.45(AINP8)
CLK3: U9.27(CLKDIV) ; also sheet 7
DOUT3_1: U9.20(DOUT1) ; also sheet 7
DOUT3_2: U9.19(DOUT2) ; also sheet 7
DOUT3_3: U9.18(DOUT3) ; also sheet 7
DOUT3_4: U9.17(DOUT4) ; also sheet 7
DOUT3_5: U9.16(DOUT5)
DOUT3_6: U9.15(DOUT6)
DOUT3_7: U9.14(DOUT7)
DOUT3_8: U9.13(DOUT8)
DRDY3: U9.29(!DRDY/FSYNC) ; also sheet 7
GND: C105.2 C106.2 C107.2 U9.6(AGND_2) U9.7(DGND_2) U9.8(TEST0) U9.9(TEST1) U9.12(DIN) U9.21(DGND_3) U9.24(DGND_4) U9.25(DGND) U9.30(FORMAT2) U9.32(FORMAT0) U9.33(MODE1) U9.34(MODE0) U9.43(AGND_3) U9.54(AGND_4) U9.57(VREFN) U9.58(AGND_5) U9.59(AGND) U9.65(EPAD) ; also sheet 1,2,3,4,5,6,7,8,9,10,11,12,13,14,15,16,17,19,20,21
SCLK3: U9.28(SCLK) ; also sheet 7
SYNC3: U9.11(!SYNC) ; also sheet 7
VCOMM3: U9.55(VCOM) ; also sheet 17
VREFP3: U9.56(VREFP) ; also sheet 17

## Sheet 19 of 21
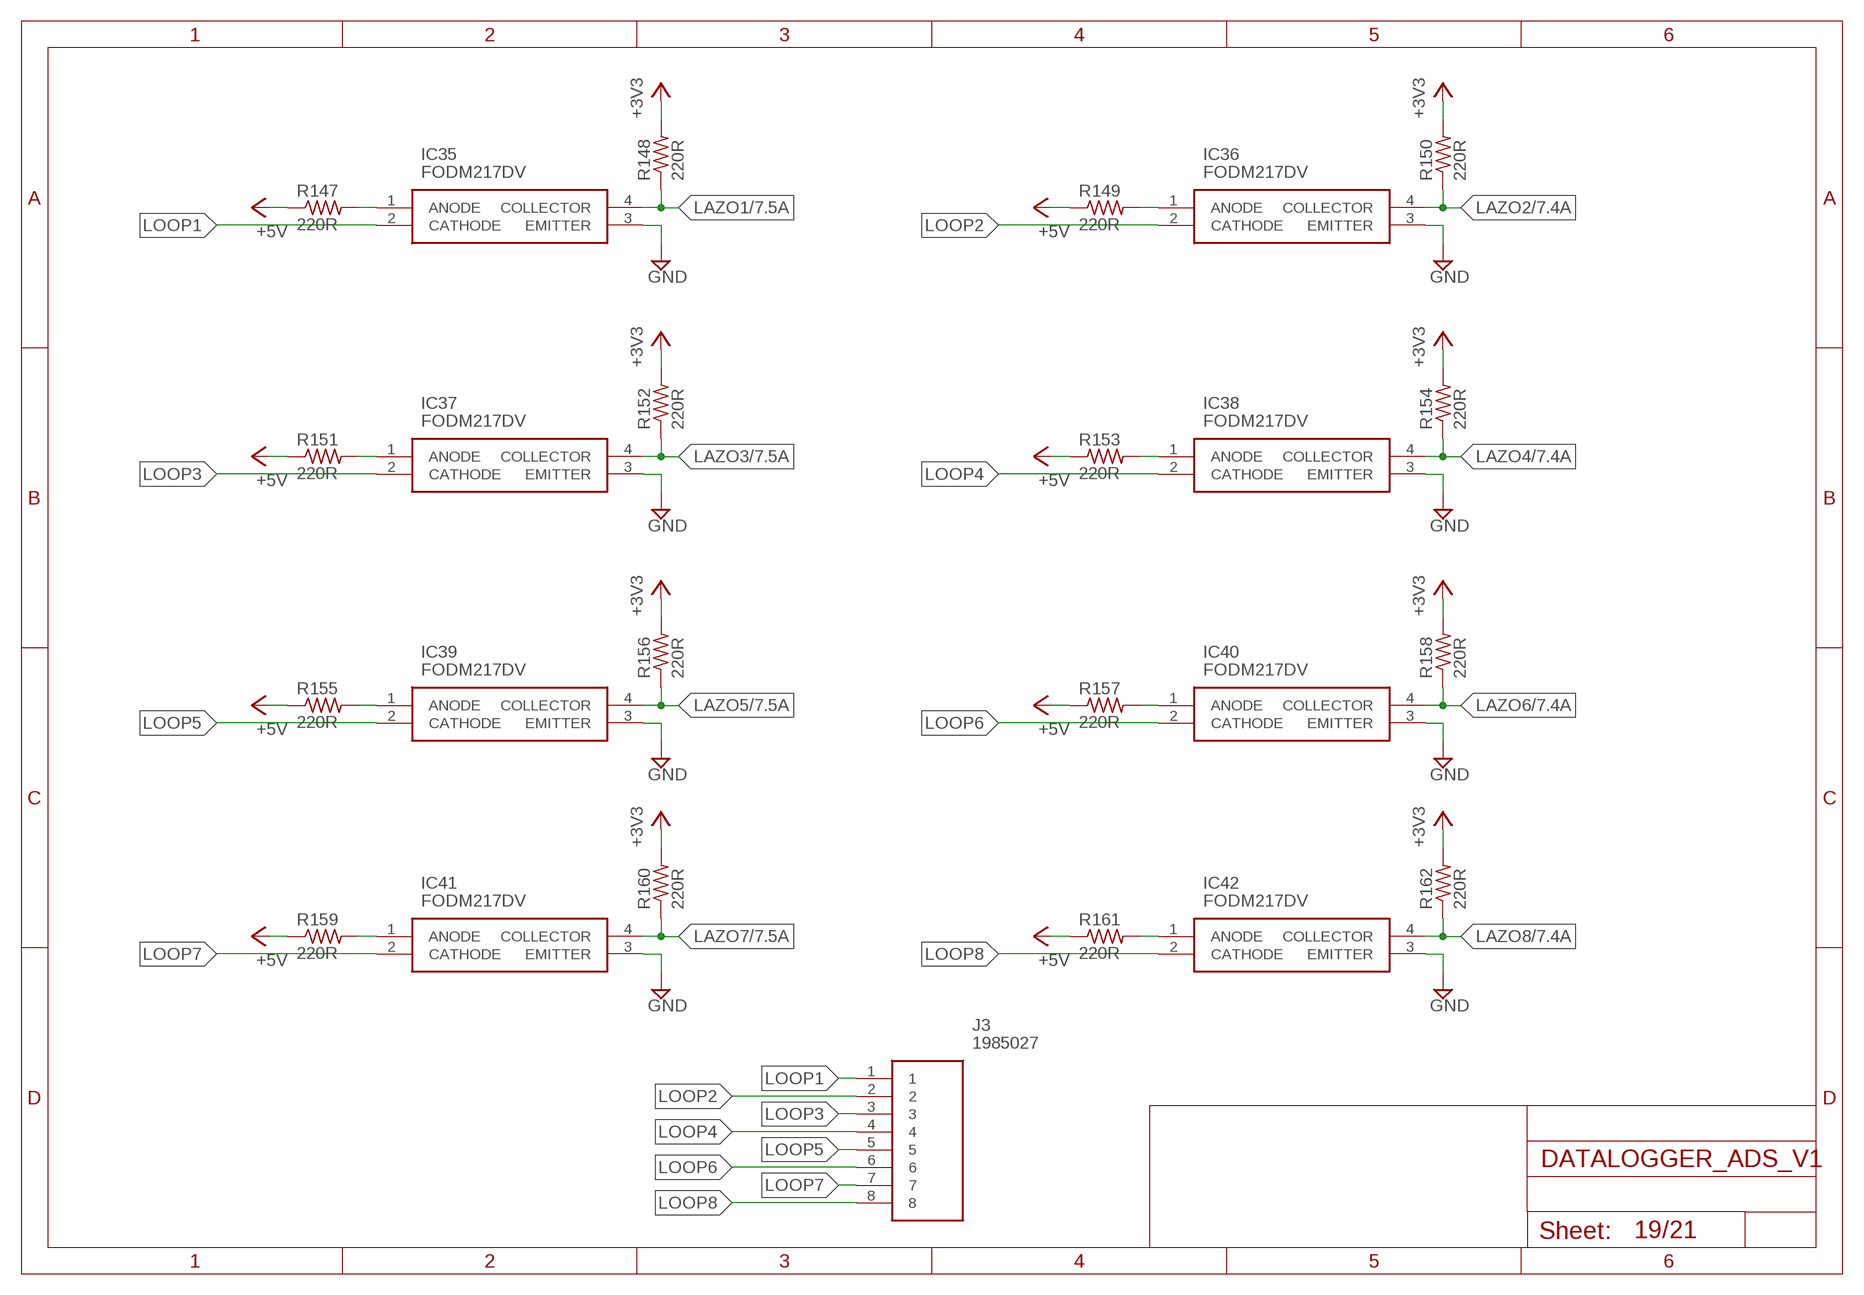
[diagram p18: schematic, sheet 19]

### Parts
IC35  FODM217DV  [SOIC127P700X220-4N]
IC36  FODM217DV  [SOIC127P700X220-4N]
IC37  FODM217DV  [SOIC127P700X220-4N]
IC38  FODM217DV  [SOIC127P700X220-4N]
IC39  FODM217DV  [SOIC127P700X220-4N]
IC40  FODM217DV  [SOIC127P700X220-4N]
IC41  FODM217DV  [SOIC127P700X220-4N]
IC42  FODM217DV  [SOIC127P700X220-4N]
J3  1985027  [1985027]
R147  220R  R-US_R0805  [R0805]
R148  220R  R-US_R0805  [R0805]
R149  220R  R-US_R0805  [R0805]
R150  220R  R-US_R0805  [R0805]
R151  220R  R-US_R0805  [R0805]
R152  220R  R-US_R0805  [R0805]
R153  220R  R-US_R0805  [R0805]
R154  220R  R-US_R0805  [R0805]
R155  220R  R-US_R0805  [R0805]
R156  220R  R-US_R0805  [R0805]
R157  220R  R-US_R0805  [R0805]
R158  220R  R-US_R0805  [R0805]
R159  220R  R-US_R0805  [R0805]
R160  220R  R-US_R0805  [R0805]
R161  220R  R-US_R0805  [R0805]
R162  220R  R-US_R0805  [R0805]

### Nets
+3V3: R148.2 R150.2 R152.2 R154.2 R156.2 R158.2 R160.2 R162.2 ; also sheet 6,14,18,20,21
+5V: R147.1 R149.1 R151.1 R153.1 R155.1 R157.1 R159.1 R161.1 ; also sheet 1,2,3,4,5,6,8,9,10,11,12,13,14,15,16,17,18,21
GND: IC35.3(EMITTER) IC36.3(EMITTER) IC37.3(EMITTER) IC38.3(EMITTER) IC39.3(EMITTER) IC40.3(EMITTER) IC41.3(EMITTER) IC42.3(EMITTER) ; also sheet 1,2,3,4,5,6,7,8,9,10,11,12,13,14,15,16,17,18,20,21
LAZO1: IC35.4(COLLECTOR) R148.1 ; also sheet 7
LAZO2: IC36.4(COLLECTOR) R150.1 ; also sheet 7
LAZO3: IC37.4(COLLECTOR) R152.1 ; also sheet 7
LAZO4: IC38.4(COLLECTOR) R154.1 ; also sheet 7
LAZO5: IC39.4(COLLECTOR) R156.1 ; also sheet 7
LAZO6: IC40.4(COLLECTOR) R158.1 ; also sheet 7
LAZO7: IC41.4(COLLECTOR) R160.1 ; also sheet 7
LAZO8: IC42.4(COLLECTOR) R162.1 ; also sheet 7
LOOP1: IC35.2(CATHODE) J3.1
LOOP2: IC36.2(CATHODE) J3.2
LOOP3: IC37.2(CATHODE) J3.3
LOOP4: IC38.2(CATHODE) J3.4
LOOP5: IC39.2(CATHODE) J3.5
LOOP6: IC40.2(CATHODE) J3.6
LOOP7: IC41.2(CATHODE) J3.7
LOOP8: IC42.2(CATHODE) J3.8
N$102: IC35.1(ANODE) R147.2
N$104: IC36.1(ANODE) R149.2
N$112: IC37.1(ANODE) R151.2
N$116: IC38.1(ANODE) R153.2
N$118: IC39.1(ANODE) R155.2
N$120: IC40.1(ANODE) R157.2
N$122: IC41.1(ANODE) R159.2
N$124: IC42.1(ANODE) R161.2

## Sheet 20 of 21
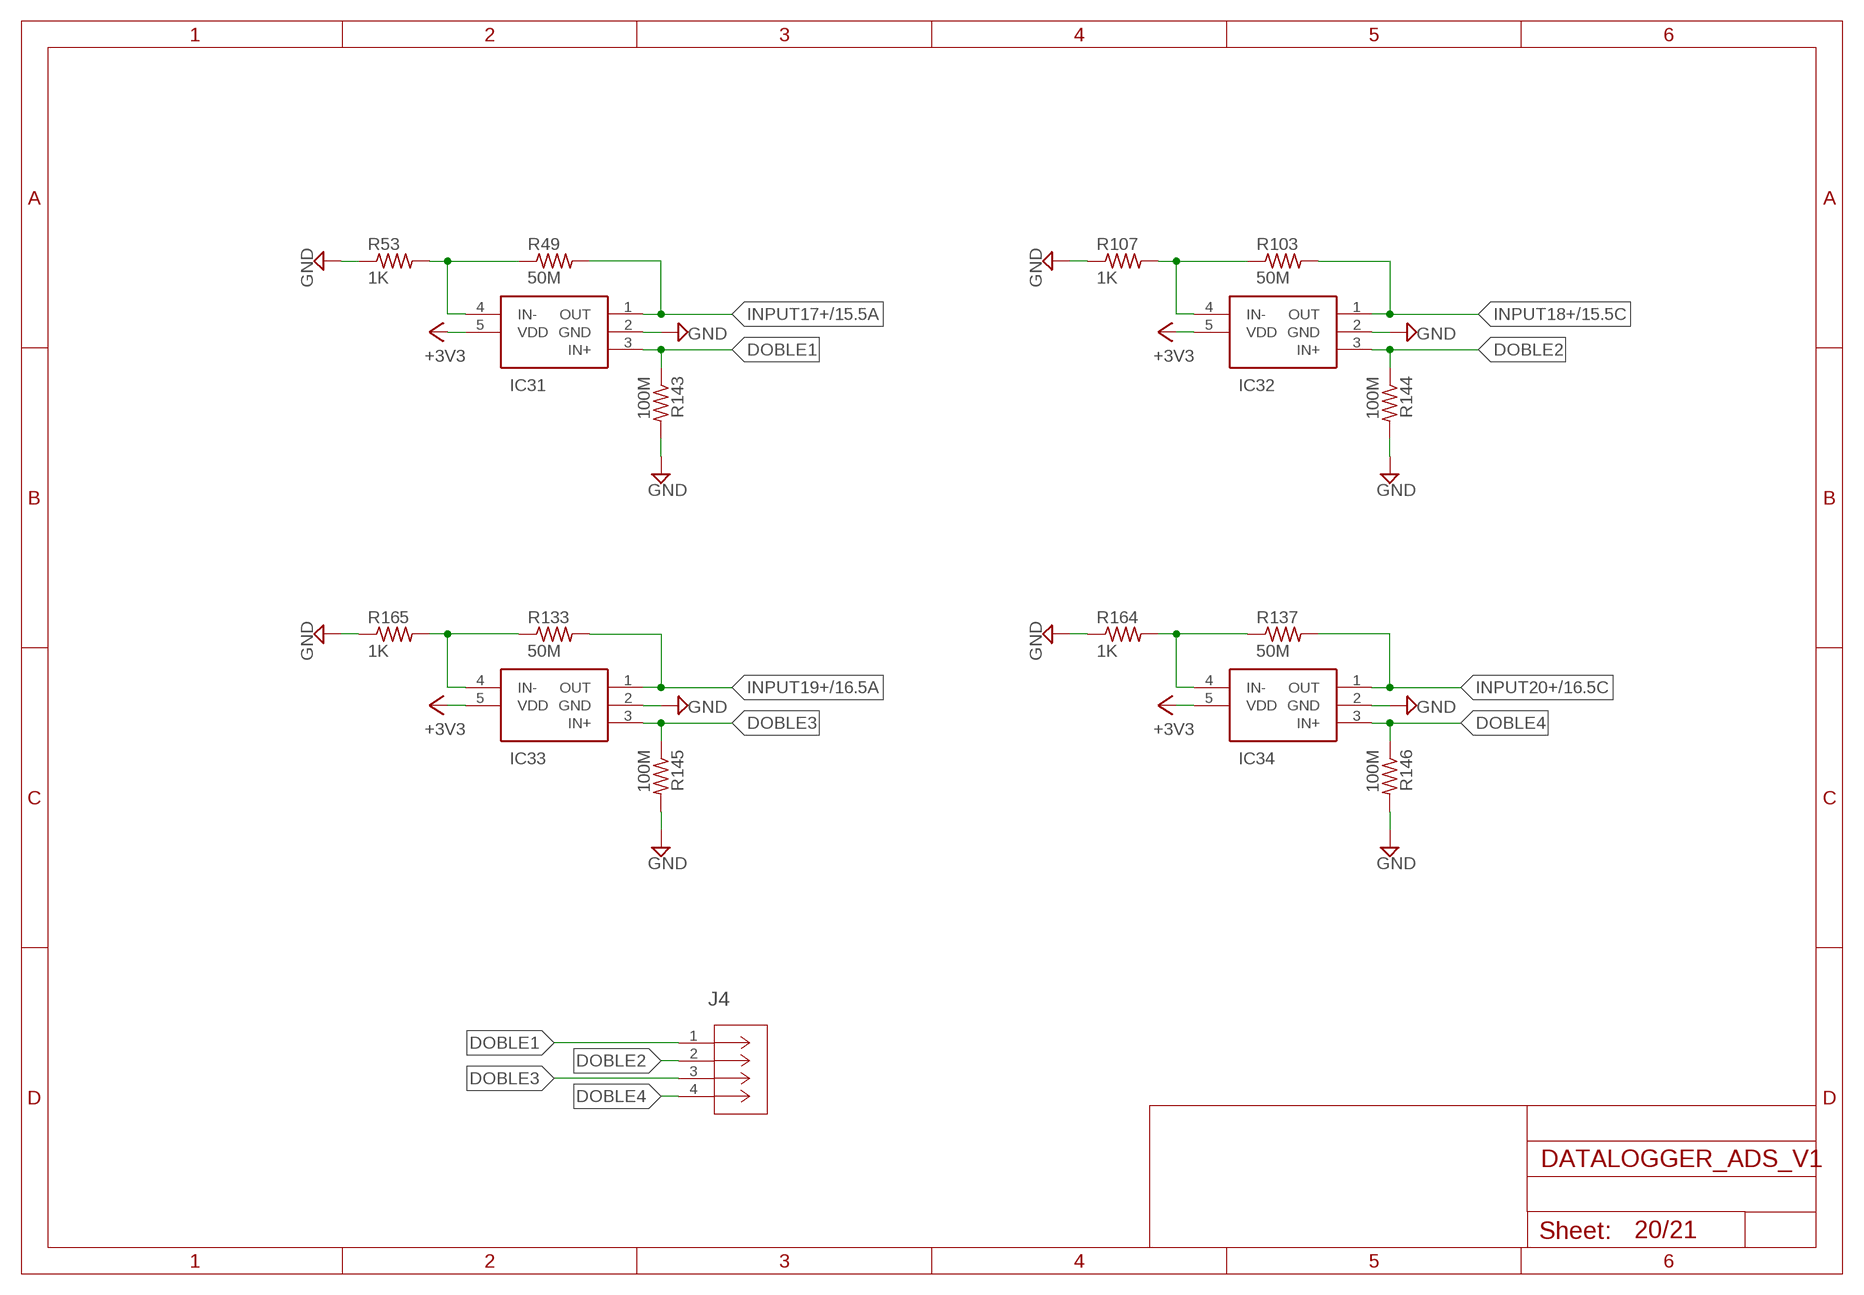
[diagram p19: schematic, sheet 20]

### Parts
IC31  TLV2771CDBVR  [SOT95P280X145-5N]
IC32  TLV2771CDBVR  [SOT95P280X145-5N]
IC33  TLV2771CDBVR  [SOT95P280X145-5N]
IC34  TLV2771CDBVR  [SOT95P280X145-5N]
J4  1989764  [CONN_1989764_PXC]
R49  50M  R-US_R0805  [R0805]
R53  1K  R-US_R0805  [R0805]
R103  50M  R-US_R0805  [R0805]
R107  1K  R-US_R0805  [R0805]
R133  50M  R-US_R0805  [R0805]
R137  50M  R-US_R0805  [R0805]
R143  100M  R-US_R0805  [R0805]
R144  100M  R-US_R0805  [R0805]
R145  100M  R-US_R0805  [R0805]
R146  100M  R-US_R0805  [R0805]
R164  1K  R-US_R0805  [R0805]
R165  1K  R-US_R0805  [R0805]

### Nets
+3V3: IC31.5(VDD) IC32.5(VDD) IC33.5(VDD) IC34.5(VDD) ; also sheet 6,14,18,19,21
DOBLE1: IC31.3(IN+) J4.1 R143.1
DOBLE2: IC32.3(IN+) J4.2 R144.1
DOBLE3: IC33.3(IN+) J4.3 R145.1
DOBLE4: IC34.3(IN+) J4.4 R146.1
GND: IC31.2(GND) IC32.2(GND) IC33.2(GND) IC34.2(GND) R53.1 R107.1 R143.2 R144.2 R145.2 R146.2 R164.1 R165.1 ; also sheet 1,2,3,4,5,6,7,8,9,10,11,12,13,14,15,16,17,18,19,21
INPUT17+: IC31.1(OUT) R49.2 ; also sheet 15
INPUT18+: IC32.1(OUT) R103.2 ; also sheet 15
INPUT19+: IC33.1(OUT) R133.2 ; also sheet 16
INPUT20+: IC34.1(OUT) R137.2 ; also sheet 16
N$75: IC33.4(IN-) R133.1 R165.2
N$97: IC31.4(IN-) R49.1 R53.2
N$98: IC32.4(IN-) R103.1 R107.2
N$111: IC34.4(IN-) R137.1 R164.2

## Sheet 21 of 21
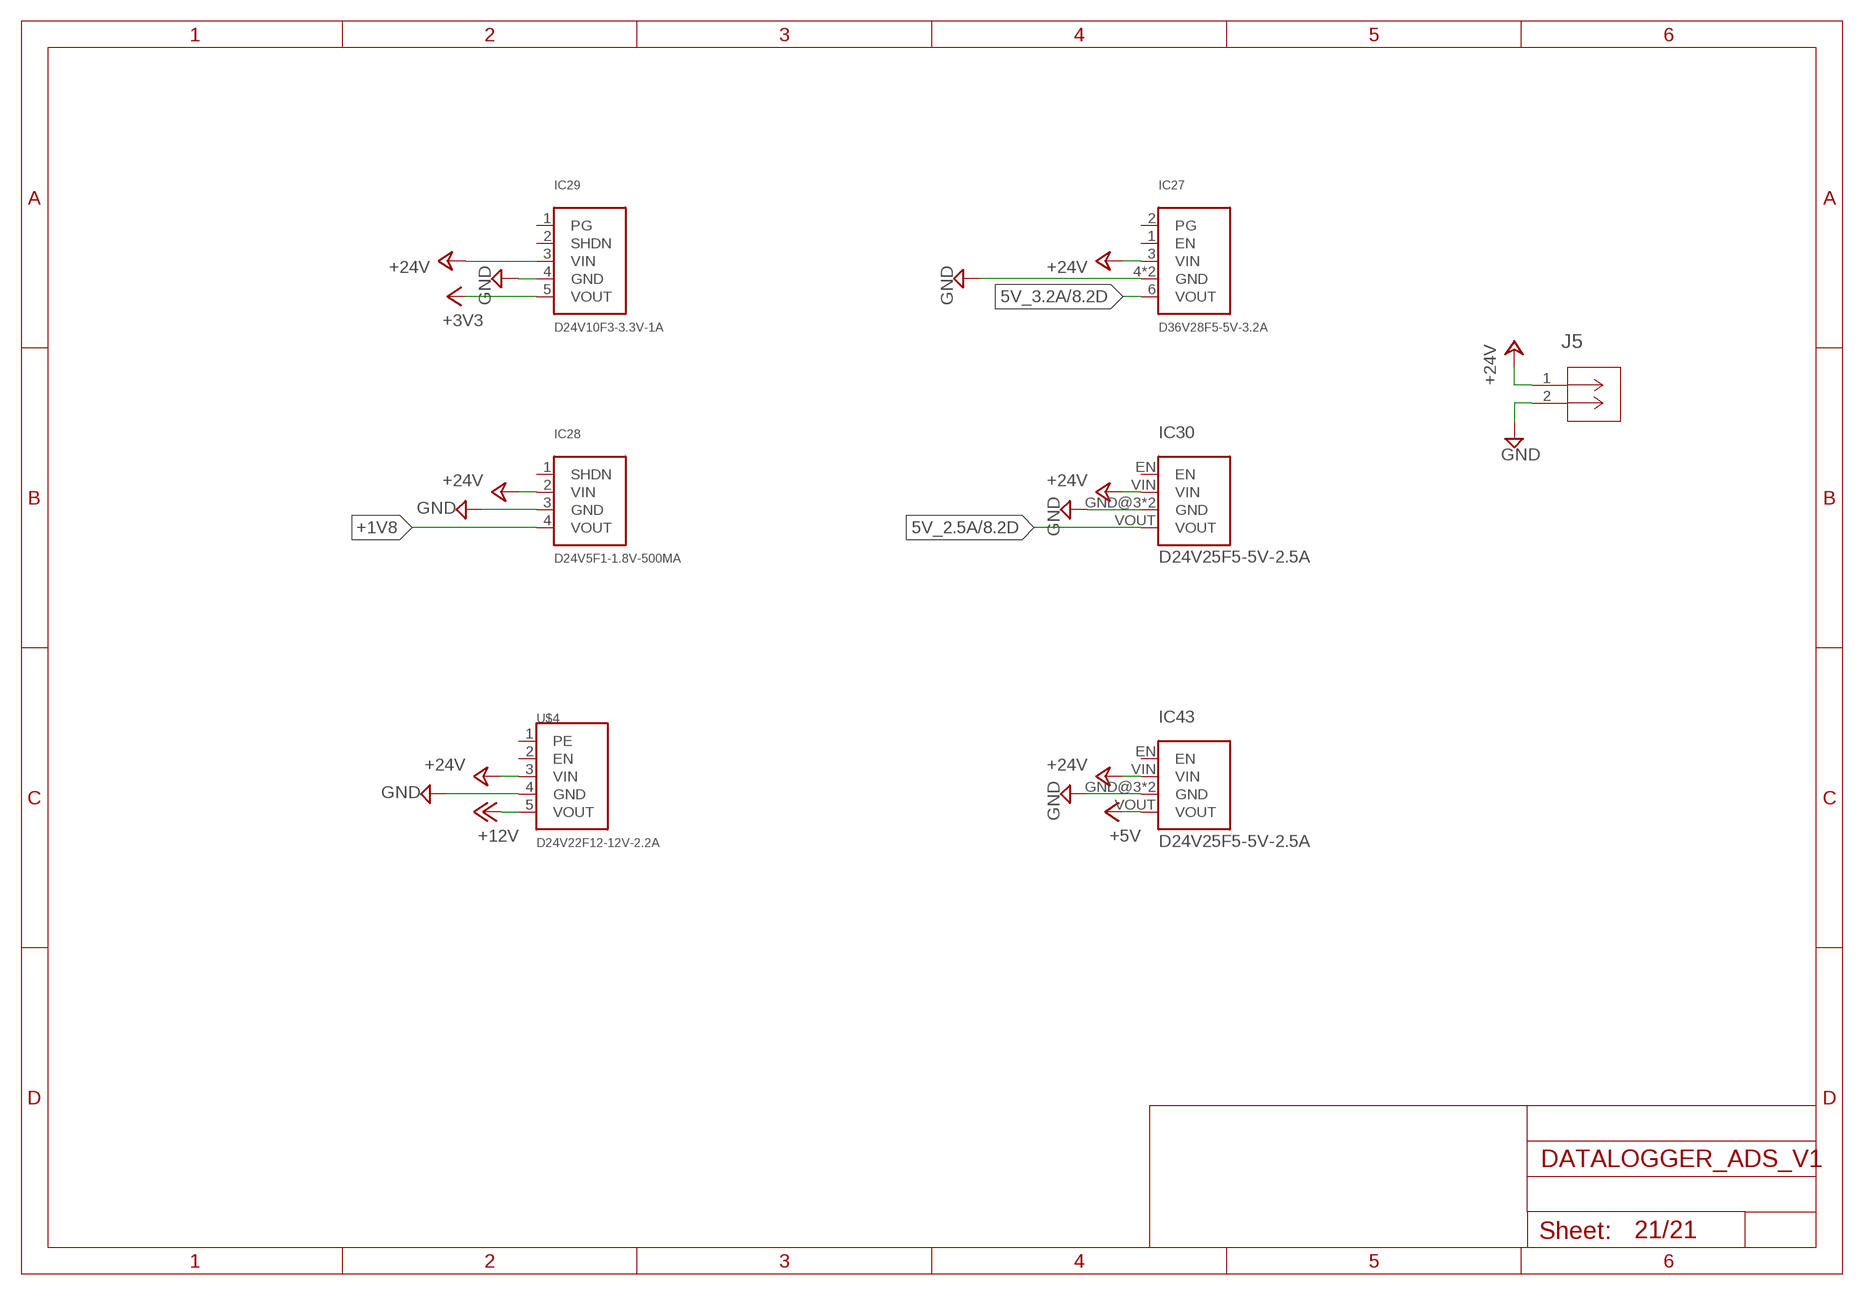
[diagram p20: schematic, sheet 21]

### Parts
IC27  D36V28F5-5V-3.2A  [D36V28F5-5V-3.2A]
IC28  D24V5F1-1.8V-500MA  [D24V5F1]
IC29  D24V10F3-3.3V-1A  [D24V10F3-3.3V-1A]
IC30  D24V25F5-5V-2.5A  [D24V25F5-5V-2.5A]
IC43  D24V25F5-5V-2.5A  [D24V25F5-5V-2.5A]
J5  1755736  [CONN_1924305]
U$4  D24V22F12-12V-2.2A  [D24V22F12]

### Nets
5V_2.5A: IC30.VOUT ; also sheet 8
5V_3.2A: IC27.6(VOUT) ; also sheet 8
+1V8: IC28.4(VOUT) ; also sheet 6,14,18
+3V3: IC29.5(VOUT) ; also sheet 6,14,18,19,20
+5V: IC43.VOUT ; also sheet 1,2,3,4,5,6,8,9,10,11,12,13,14,15,16,17,18,19
+12V: U$4.5(VOUT) ; also sheet 8
+24V: IC27.3(VIN) IC28.2(VIN) IC29.3(VIN) IC30.VIN IC43.VIN J5.1 U$4.3(VIN)
GND: IC27.4(GND) IC27.5(GND) IC28.3(GND) IC29.4(GND) IC30.GND@3(GND) IC30.GND@4(GND) IC43.GND@3(GND) IC43.GND@4(GND) J5.2 U$4.4(GND) ; also sheet 1,2,3,4,5,6,7,8,9,10,11,12,13,14,15,16,17,18,19,20
Unconnected: IC27.1(EN) IC27.2(PG) IC28.1(SHDN) IC29.1(PG) IC29.2(SHDN) IC30.EN IC43.EN U$4.1(PE) U$4.2(EN)

## Library data of the parts
C1-C107 C114-C119 = rcl:C-US: CAPACITOR, American symbol; SPICEPREFIX: C
IC1 = myProyects:DS3231
IC10 = myProyects:DE10-NANO
IC11 = myProyects:RASPBERRY_PI_4
IC27 = myProyects:D36V28F5-5V-3.2A
IC28 = myProyects:D24V5F1-1.8V-500MA
IC29 = myProyects:D24V10F3-3.3V-1A
IC30 IC43 = myProyects:D24V25F5-5V-2.5A
IC31-IC34 = SamacSys_Parts:TLV2771CDBVR: Single 2.7-V High Slew Rate Rail-to-Rail Output Operational Amplifier Source: Datasheet <http://www.ti.com/lit/gpn/tlv2771>; DESCRIPTION: Single 2.7-V High Slew Rate Rail-to-Rail Output Operational Amplifier; HEIGHT: 1.45mm; MANUFACTURER_NAME: Texas Instruments; MANUFACTURER_PART_NUMBER: TLV2771CDBVR; MOUSER_PART_NUMBER: 595-TLV2771CDBVR; MOUSER_PRICE-STOCK: https://www.mouser.co.uk/ProductDetail/Texas-Instruments/TLV2771CDBVR?qs=Fg5TsMy7H4uETShD0%252BZIjw%3D%3D
IC35-IC42 = SamacSys_Parts:FODM217DV: 4SO TR Source: Datasheet <http://www.onsemi.com/pub/Collateral/FODM217D-D.PDF>; DESCRIPTION: 4SO TR; HEIGHT: 2.2mm; MANUFACTURER_NAME: ON Semiconductor; MANUFACTURER_PART_NUMBER: FODM217DV; MOUSER_PART_NUMBER: 863-FODM217DV; MOUSER_PRICE-STOCK: https://www.mouser.co.uk/ProductDetail/ON-Semiconductor/FODM217DV?qs=byeeYqUIh0ODiCEVRf33vQ%3D%3D
J1 J2 J6 = SamacSys_Parts:22-29-2021: Molex KK 254 6410, 2.54mm Pitch, 2 Way, 1 Row, Straight PCB Header, Through Hole Source: Datasheet <https://componentsearchengine.com/Datasheets/1/22-29-2021.pdf>; DESCRIPTION: Molex KK 254 6410, 2.54mm Pitch, 2 Way, 1 Row, Straight PCB Header, Through Hole; HEIGHT: 11.7mm; MANUFACTURER_NAME: Molex; MANUFACTURER_PART_NUMBER: 22-29-2021; MOUSER_PART_NUMBER: 538-22-29-2021; MOUSER_PRICE-STOCK: https://www.mouser.com/Search/Refine.aspx?Keyword=538-22-29-2021
J3 = SamacSys_Parts:1985027: PCB terminal block, nominal current: 8 A, rated voltage (III/2): 250 V, nominal cross section: 1.5 mm, pitch: 3.5 mm, number of positions: 8, connection method: Push-in spring connection, mounting: Wave soldering, conductor/PCB connection direction: 45 , color: green, Pin layout: Linear pinning, Solder pin [P]: 3.6 mm. Soldering legs in front area, one-rowed Source: Datasheet <https://www.phoenixcontact.com/online/portal/in?uri=pxc-oc-itemdetail:pid=1985027&library=inen&tab=1>; DESCRIPTION: PCB terminal block, nominal current: 8 A, rated voltage (III/2): 250 V, nominal cross section: 1.5 mm, pitch: 3.5 mm, number of positions: 8, connection method: Push-in spring connection, mounting: Wave soldering, conductor/PCB connection direction: 45 , color: green, Pin layout: Linear pinning, Solder pin [P]: 3.6 mm. Soldering legs in front area, one-rowed; HEIGHT: 13.1mm; MANUFACTURER_NAME: Phoenix Contact; MANUFACTURER_PART_NUMBER: 1985027; MOUSER_PART_NUMBER: 651-1985027; MOUSER_PRICE-STOCK: https://www.mouser.co.uk/ProductDetail/Phoenix-Contact/1985027/?qs=wd%252Bw3mUqFrkPN%252BA5c0%252B8Sg%3D%3D
J4 = 1989764:1989764; ARTICLE_DESCRIPTION: PTSA 0,5/ 4-2,5-F; BUILT_BY: EMA_Cory; CONTACT_TYPE: Unknown; COPYRIGHT: Copyright (C) 2018 Accelerated Designs. All rights reserved; MANUFACTURER_PART_NUMBER: 1989764; NUMBER_OF_CONNECTION: 4; NUMBER_OF_POSITION_PER_ROW: 4; NUMBER_OF_POTENTIALS: 4; NUMBER_OF_ROWS: 1; NUMBER_OF_SOLDER_PINS_PER_POTENTIALS: 1; PITCH__MM_: 2.5; PLUG_SYSTEM: Unknown; PRODUCTTYP: Printed circuit board terminal; PRODUCT_FAMILY: PTSA 0,5; SOLDER_PIN_LENGTH__MM_: 3.6; SOURCELIBRARY: Phoenix_Contact_2020-03-19; VENDOR: Phoenix Contact
J5 = 1755736:1755736; ARTICLE_DESCRIPTION: MSTBVA 2,5/ 2-G-5,08; BUILT_BY: EMA_Anthony; CONTACT_TYPE: male connector; COPYRIGHT: Copyright (C) 2018 Accelerated Designs. All rights reserved; MANUFACTURER_PART_NUMBER: 1755736; NUMBER_OF_CONNECTION: 2; NUMBER_OF_POSITION_PER_ROW: 2; NUMBER_OF_POTENTIALS: 2; NUMBER_OF_ROWS: 1; NUMBER_OF_SOLDER_PINS_PER_POTENTIALS: 1; PITCH__MM_: 5.08; PLUG_SYSTEM: CLASSIC COMBICON; PRODUCTTYP: PCB headers; PRODUCT_FAMILY: MSTBVA 2,5/..-G; SOLDER_PIN_LENGTH__MM_: 3.9; SOURCELIBRARY: Phoenix_Contact_2020-08-21; VENDOR: Phoenix Contact
JP1-JP4 = pinhead:PINHD-2X20: PIN HEADER
JP5 = pinhead:PINHD-1X3: PIN HEADER
JP6 = pinhead:PINHD-2X5: PIN HEADER
R1-R165 = rcl:R-US_: RESISTOR, American symbol; SPICEPREFIX: R
U1 U2 U4 U5 U7 U8 = OPA350EA_2K5:OPA350EA/2K5; BUILT_BY: EMA_UL_Team; COPYRIGHT: Copyright (C) 2018 Accelerated Designs. All rights reserved; MANUFACTURER: Texas Instruments; MANUFACTURER_PART_NUMBER: OPA350EA/2K5; SOURCELIBRARY: TI_2016-07-06; VENDOR: Texas Instruments
U3 U12 U13 = REF5025:REF5025AID; DATASHEET_URL: http://www.ti.com/lit/gpn/REF5025; DESCRIPTION: Low Noise, Very Low Drift, Precision Voltage Reference; FAMILY_NAME: SERIES VOLTAGE REFERENCE; GENERIC_PART_NUMBER: REF5025; INDUSTRY_STD_PKG_TYPE: SOIC; MANUFACTURER: Texas Instruments; MANUFACTURER_PART_NUMBER: REF5025AID; PACKAGE_DESIGNATOR: D; PIN_COUNT: 8; VENDOR: Texas Instruments
U6 U9 U11 = ADS1278IPAPR:ADS1278IPAPR; DATASHEET_URL: http://www.ti.com/lit/gpn/ADS1278; DESCRIPTION: Octal, 144kHz, Simultaneous Sampling 24-Bit Delta Sigma ADC; FAMILY_NAME: PRECISION ADC (<=10MSPS); GENERIC_PART_NUMBER: ADS1278; INDUSTRY_STD_PKG_TYPE: HTQFP; MANUFACTURER: Texas Instruments; PACKAGE_DESIGNATOR: PAP; PIN_COUNT: 64
U14-U33 = THS4521IDGKT:THS4521IDGKT; DATASHEET_URL: http://www.ti.com/lit/gpn/THS4521; DESCRIPTION: Very low power rail-to-rail output fully differential amplifier; FAMILY_NAME: FULLY DIFFERENTIAL AMPLIFIER; GENERIC_PART_NUMBER: THS4521; INDUSTRY_STD_PKG_TYPE: MSOP; MANUFACTURER: Texas Instruments; MANUFACTURER_PART_NUMBER: THS4521IDGKT; PACKAGE_DESIGNATOR: DGK; PIN_COUNT: 8; VENDOR: Texas Instruments
U$4 = myProyects:D24V22F12-12V-2.2A